# EAGLE schematic design (EAGLE 7.7.0), part 1 of 2

## Sheet 1 of 24
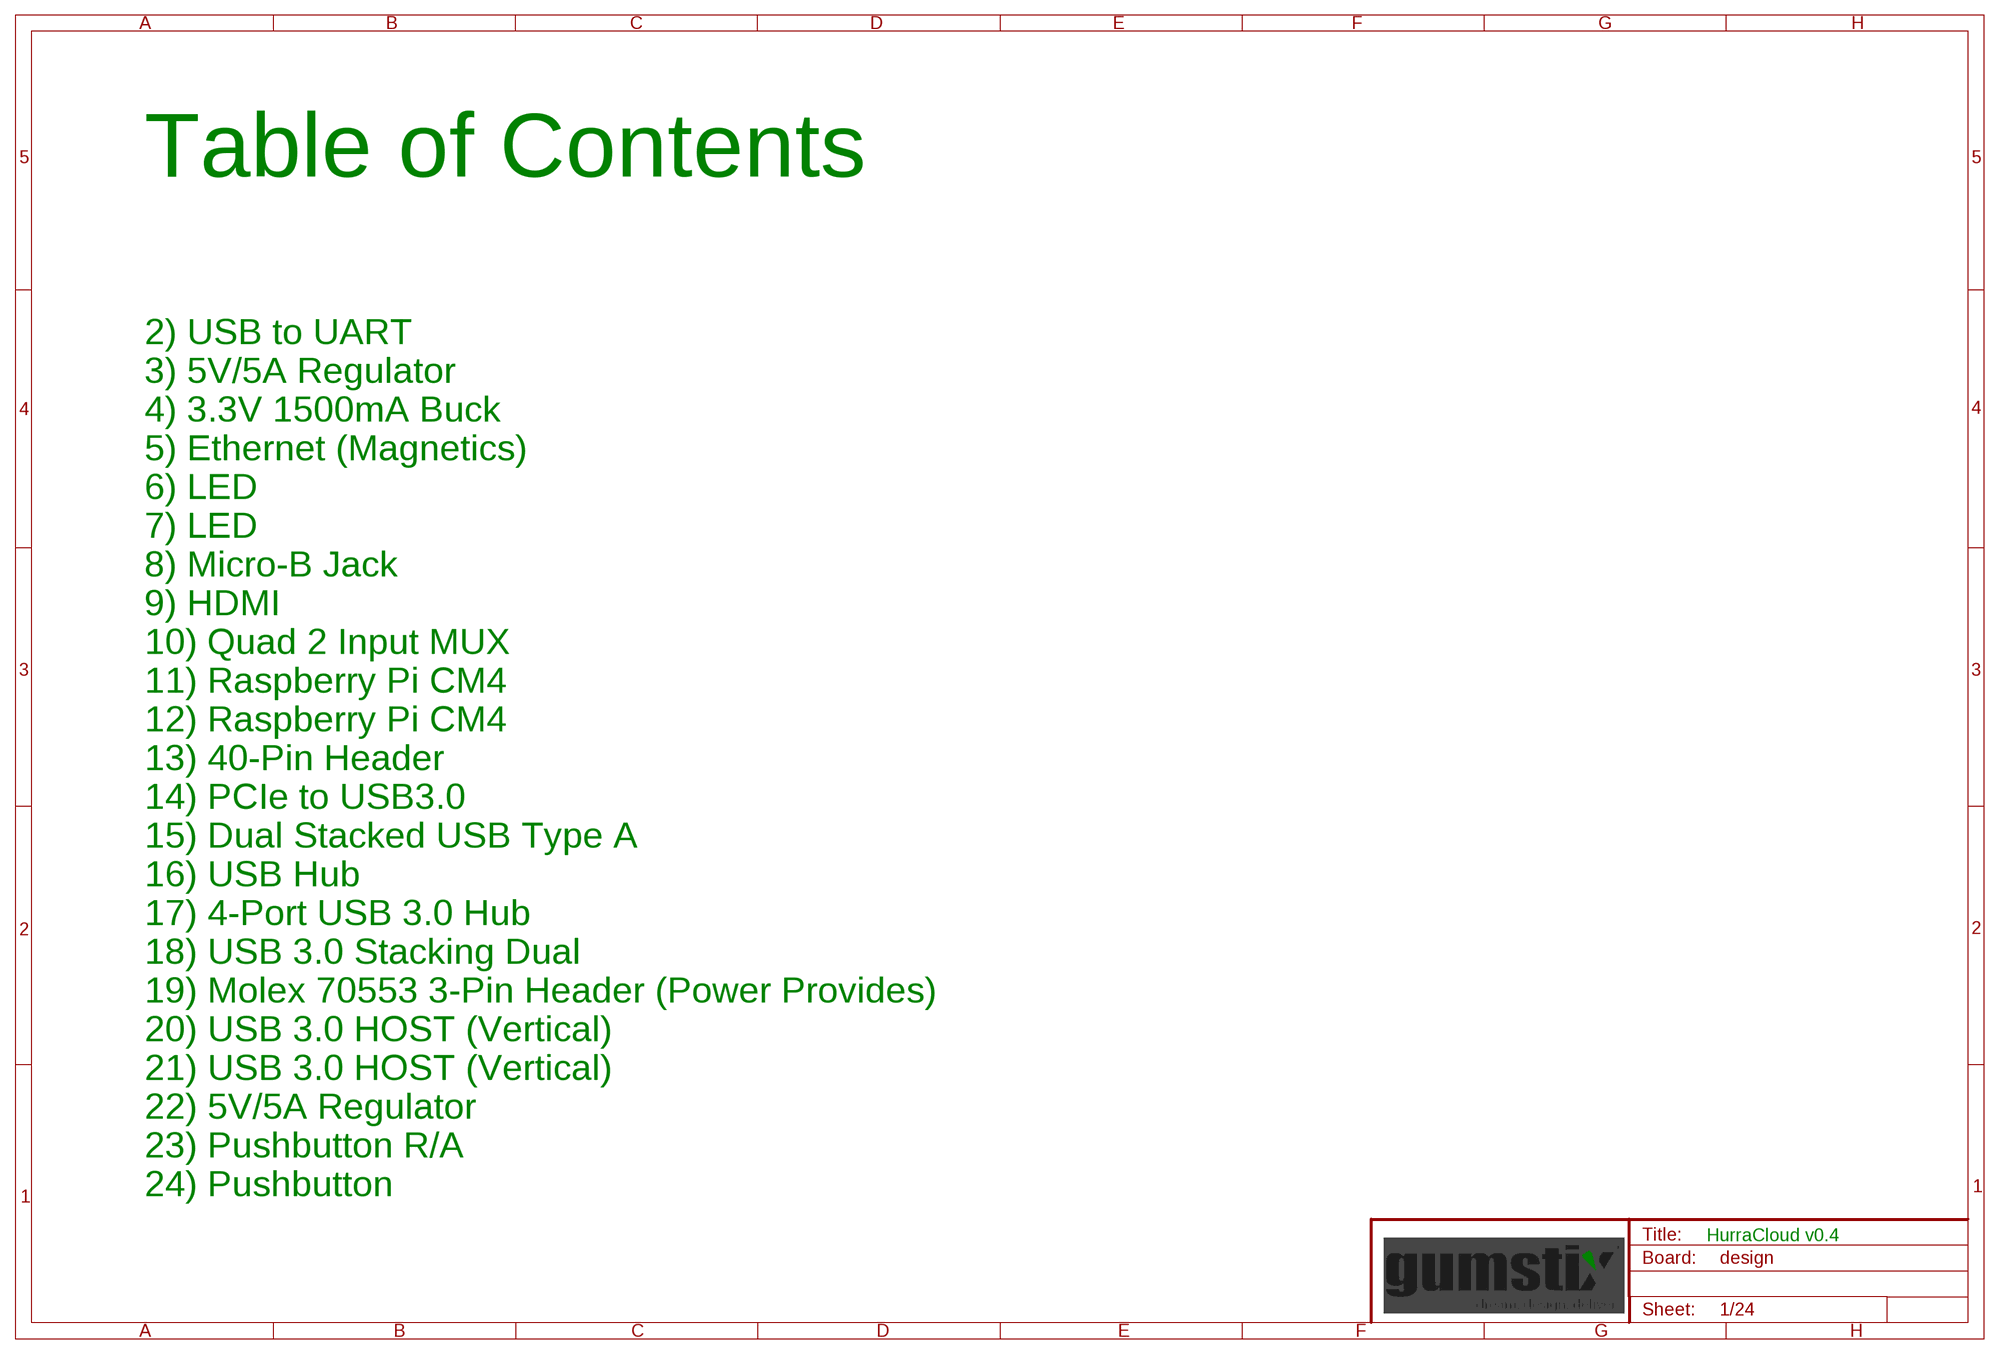
[diagram p0: schematic, sheet 1]

### Notes on the sheet
- Table of Contents
- 2) USB to UART
- 3) 5V/5A Regulator
- 4) 3.3V 1500mA Buck
- 5) Ethernet (Magnetics)
- 6) LED
- 7) LED
- 8) Micro-B Jack
- 9) HDMI
- 10) Quad 2 Input MUX
- 11) Raspberry Pi CM4
- 12) Raspberry Pi CM4
- 13) 40-Pin Header
- 14) PCIe to USB3.0
- 15) Dual Stacked USB Type A
- 16) USB Hub
- 17) 4-Port USB 3.0 Hub
- 18) USB 3.0 Stacking Dual
- 19) Molex 70553 3-Pin Header (Power Provides)
- 20) USB 3.0 HOST (Vertical)
- 21) USB 3.0 HOST (Vertical)
- 22) 5V/5A Regulator
- 23) Pushbutton R/A
- 24) Pushbutton
- HurraCloud v0.4

## Sheet 2 of 24
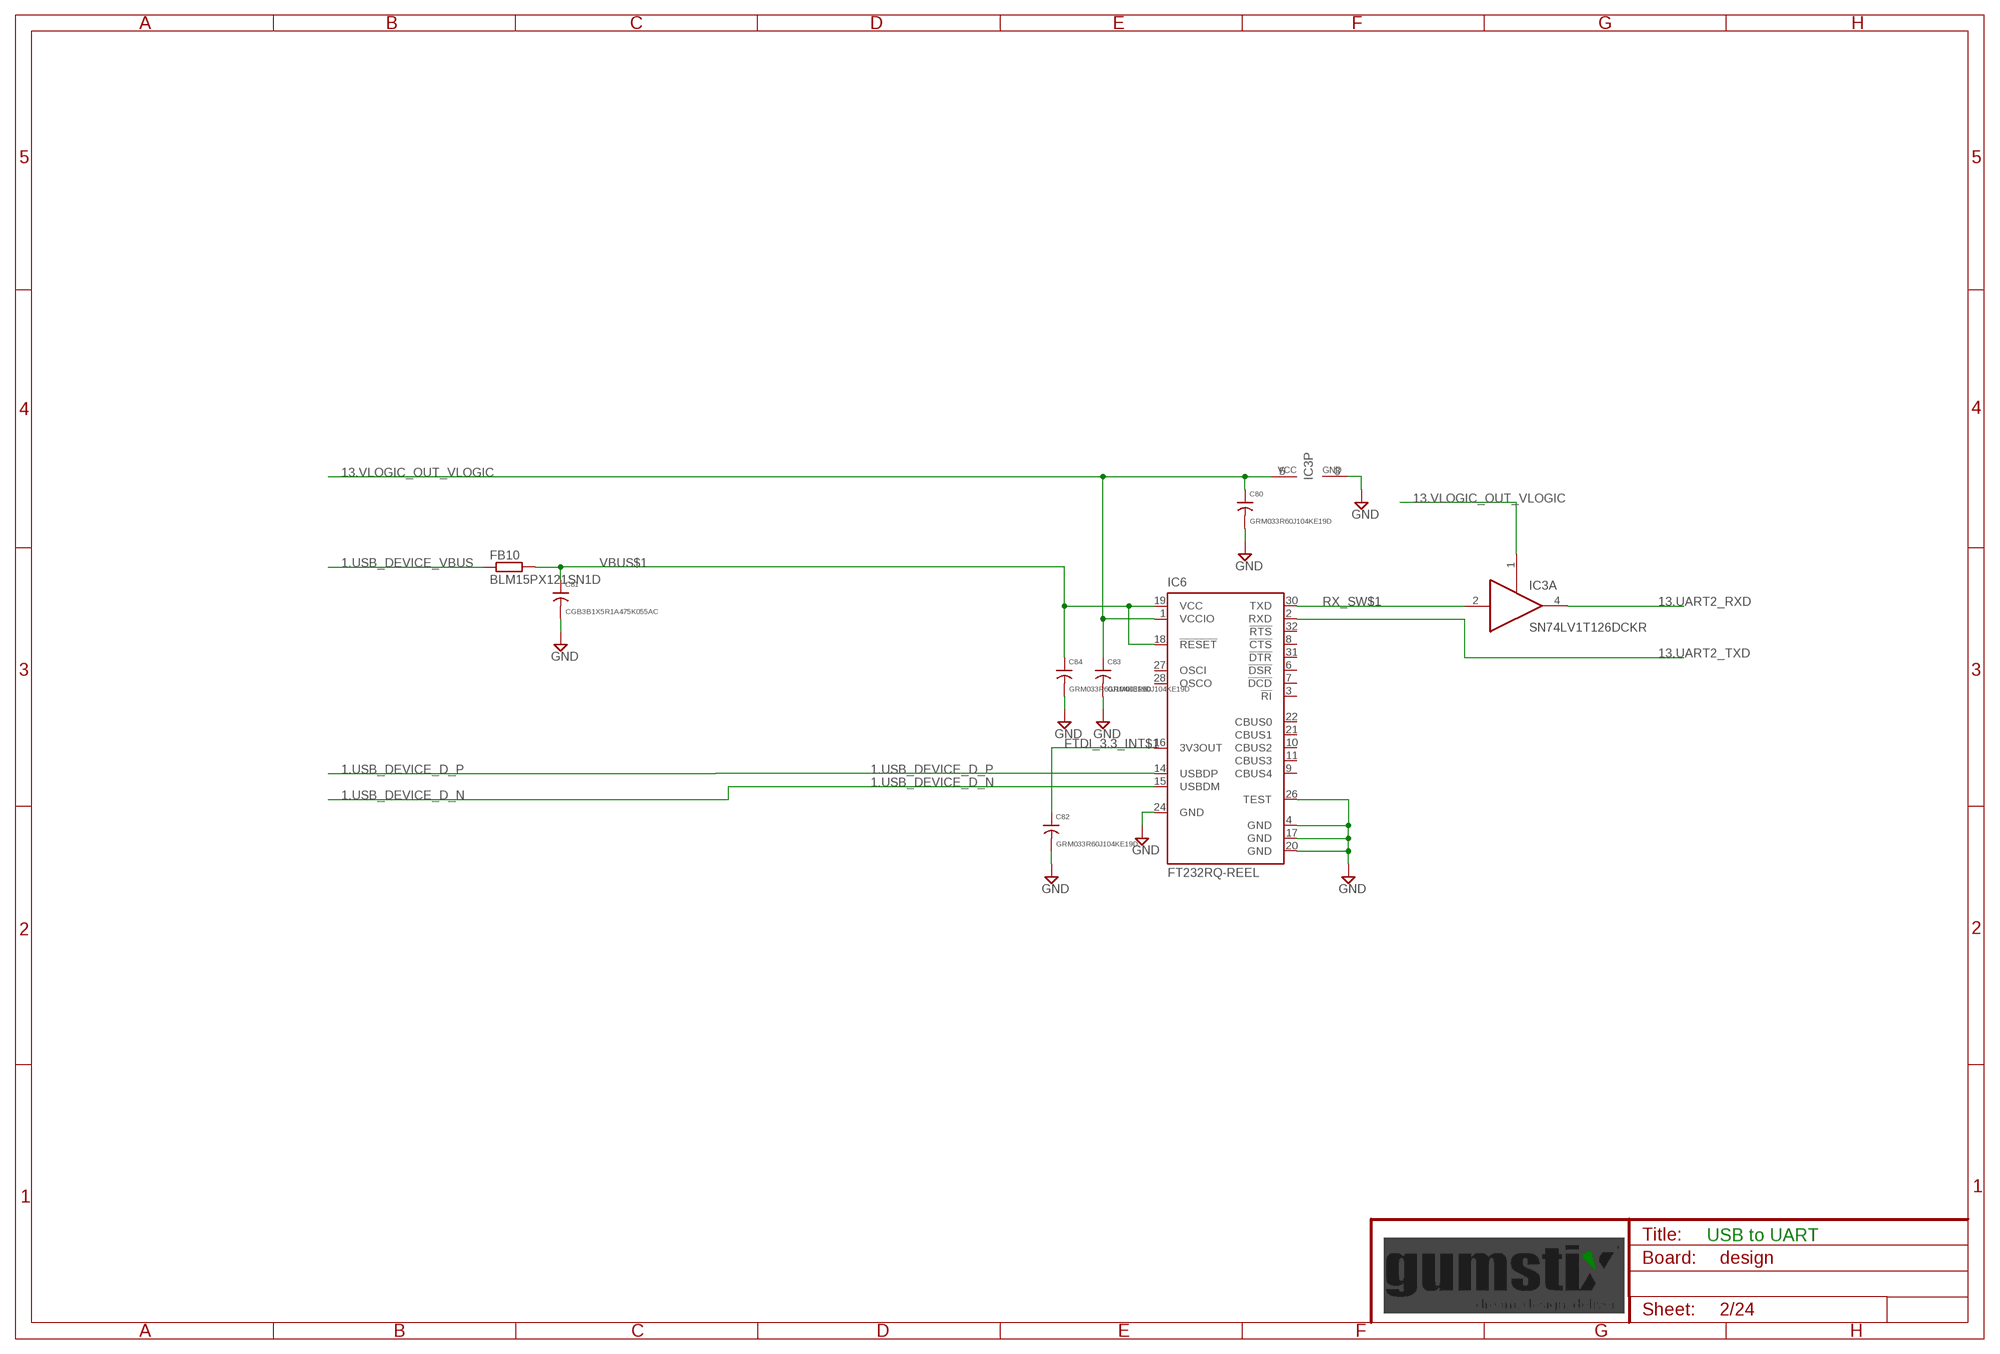
[diagram p1: schematic, sheet 2]

### Parts
C80  GRM033R60J104KE19D  [0201]
C81  CGB3B1X5R1A475K055AC  [0603]
C82  GRM033R60J104KE19D  [0201]
C83  GRM033R60J104KE19D  [0201]
C84  GRM033R60J104KE19D  [0201]
FB10  BLM15PX121SN1D  [0402]
IC3  SN74LV1T126DCKR  [SC70-5]
IC6  FT232RQ-REEL  [QFN32]

### Nets
1.USB_DEVICE_D_N [USB]: IC6.15(USBDM) ; also sheet 8
1.USB_DEVICE_D_P [USB]: IC6.14(USBDP) ; also sheet 8
1.USB_DEVICE_VBUS [supply]: FB10.1 ; also sheet 8
13.UART2_RXD: IC3.4(A:O) ; also sheet 10
13.UART2_TXD: IC6.2(RXD) ; also sheet 10
13.VLOGIC_OUT_VLOGIC [supply]: C80.1 C83.1 IC3.1(A:OE) IC3.5(P:VCC) IC6.1(VCCIO) ; also sheet 10
FTDI_3.3_INT$1 [supply]: C82.1 IC6.16(3V3OUT)
GND [supply]: C80.2 C81.2 C82.2 C83.2 C84.2 IC3.3(P:GND) IC6.4(GND) IC6.17(GND) IC6.20(GND) IC6.24(GND) IC6.26(TEST) ; also sheet 3,4,5,6,7,8,9,10,11,12,13,14,15,16,17,18,19,20,21,22,23,24
RX_SW$1: IC3.2(A:I) IC6.30(TXD)
VBUS$1 [supply]: C81.1 C84.1 FB10.2 IC6.18(!RESET) IC6.19(VCC)
Unconnected: IC6.3(!RI) IC6.6(!DSR) IC6.7(!DCD) IC6.8(!CTS) IC6.9(CBUS4) IC6.10(CBUS2) IC6.11(CBUS3) IC6.21(CBUS1) IC6.22(CBUS0) IC6.27(OSCI) IC6.28(OSCO) IC6.31(!DTR) IC6.32(!RTS)

### Notes on the sheet
- USB to UART

## Sheet 3 of 24
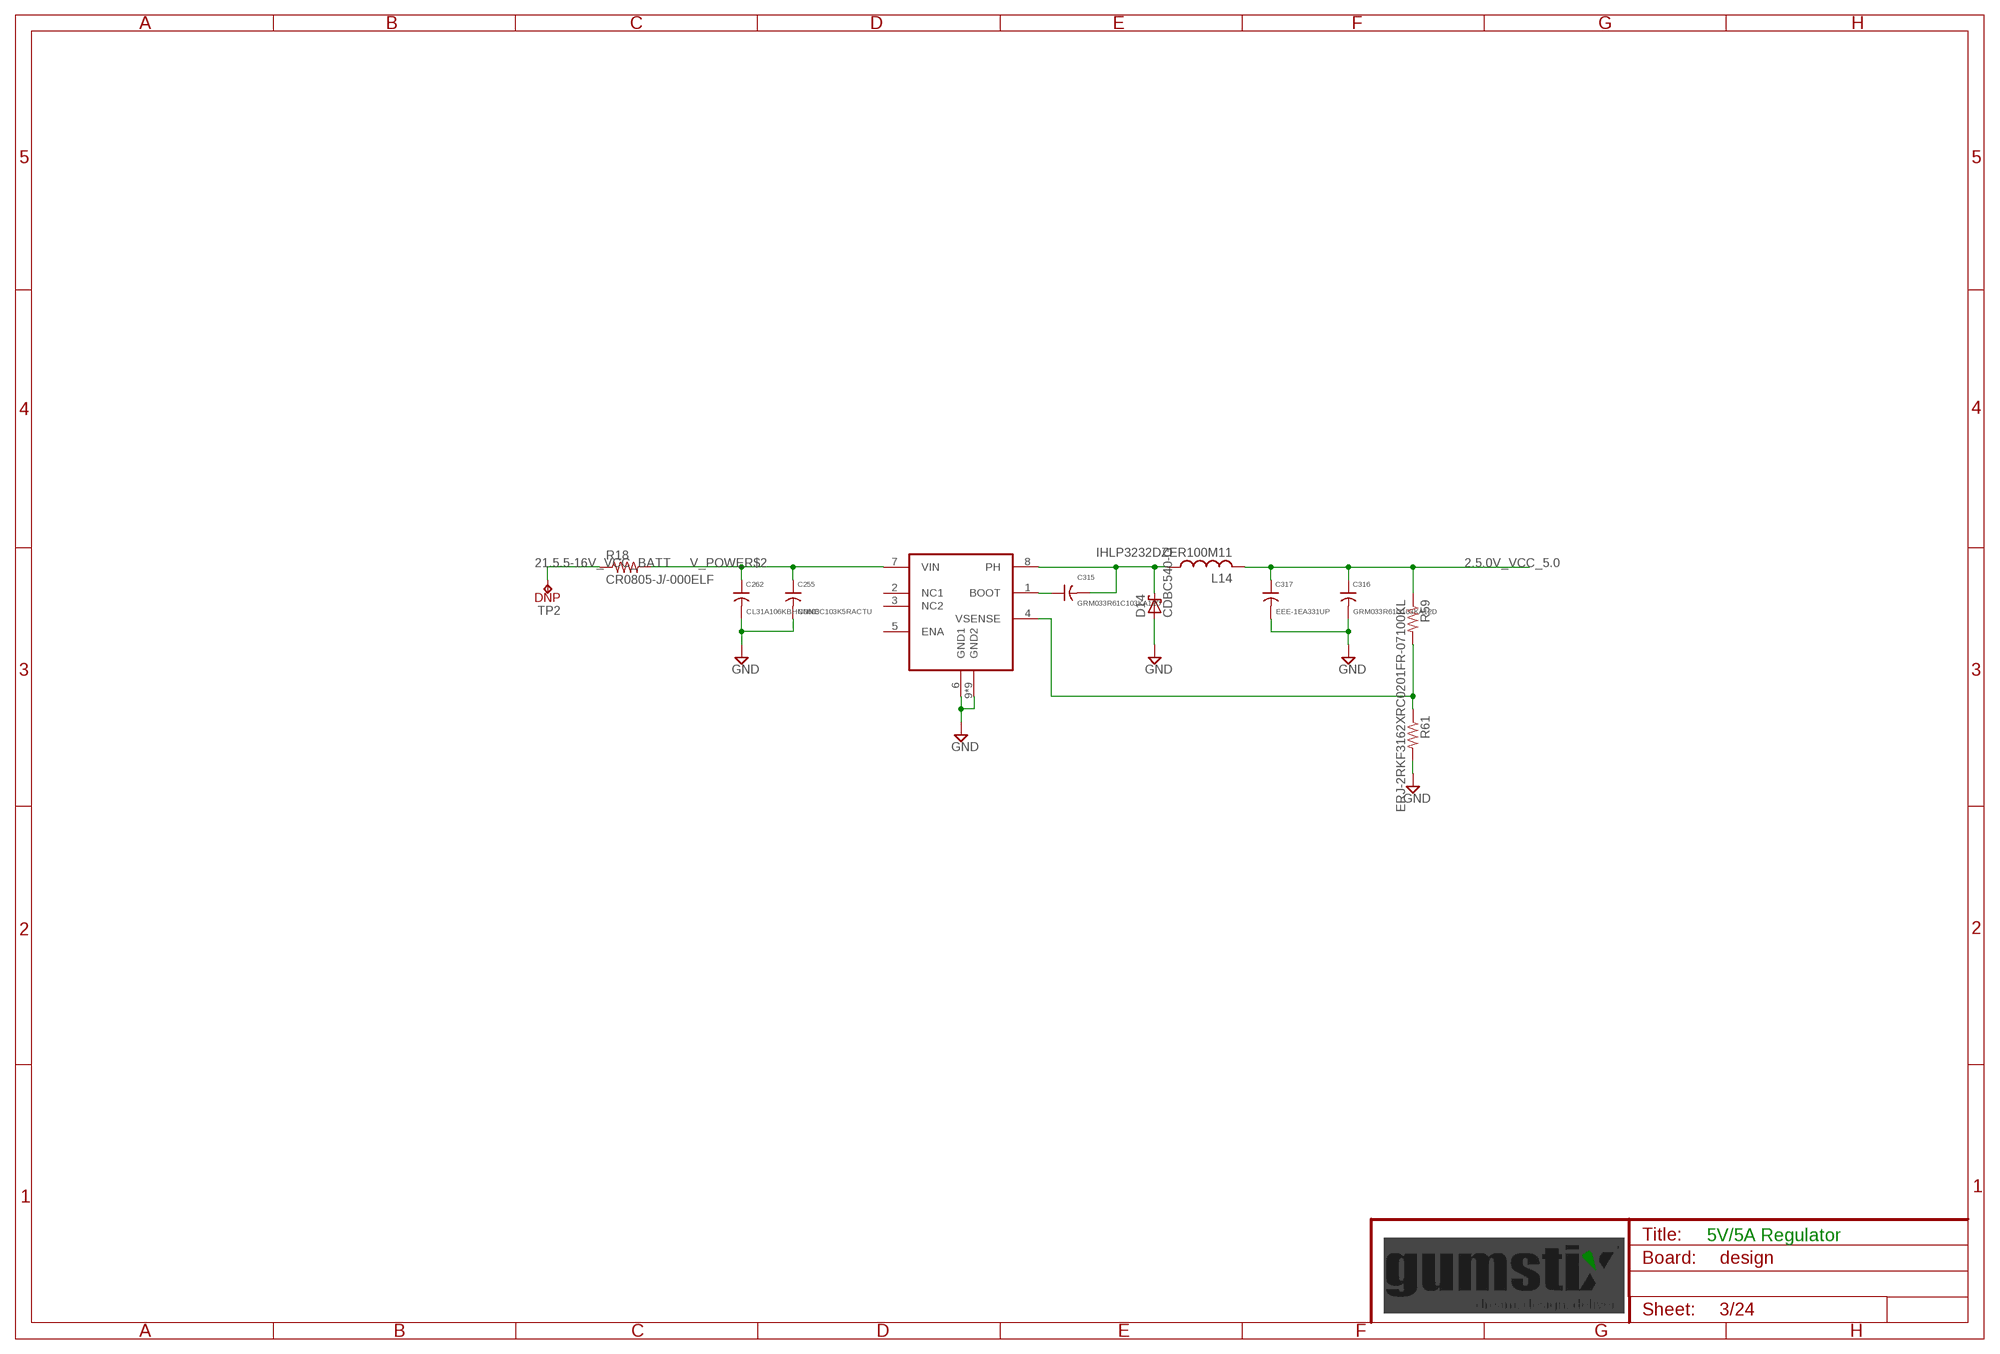
[diagram p2: schematic, sheet 3]

### Parts
C255  C0603C103K5RACTU  [0603]
C262  CL31A106KBHNNNE  [1206]
C315  GRM033R61C103KA12D  [0201]
C316  GRM033R61C103KA12D  [0201]
C317  EEE-1EA331UP  [PANASONIC_F]
D14  CDBC540-G  [DO-214AB]
L14  IHLP3232DZER100M11  [3232DZ]
R18  CR0805-J/-000ELF  [0805]
R59  RC0201FR-07100KL  [0201]
R61  ERJ-2RKF3162X  [0402]
TP2  DNP  TP05  [TP0500]
U17  TPS5450QDDARQ1  [8SO_POWERPAD]

### Nets
2.5.0V_VCC_5.0 [supply]: C316.1 C317.+ L14.2 R59.1 ; also sheet 4,9,11,13,15,16
21.5.5-16V_VCC_BATT [supply]: R18.1 TP2.1(TP) ; also sheet 19,22
BOOT$2 [supply]: C315.1 U17.1(BOOT)
GND [supply]: C255.2 C262.2 C316.2 C317.- D14.A R61.2 U17.6(GND1) U17.9(GND2) U17.PWRPAD1(GND2) U17.PWRPAD2(GND2) U17.PWRPAD3(GND2) U17.PWRPAD4(GND2) U17.PWRPAD5(GND2) U17.PWRPAD6(GND2) U17.PWRPAD7(GND2) U17.PWRPAD8(GND2) ; also sheet 2,4,5,6,7,8,9,10,11,12,13,14,15,16,17,18,19,20,21,22,23,24
PH$2 [supply]: C315.2 D14.C L14.1 U17.8(PH)
V_POWER$2 [supply]: C255.1 C262.1 R18.2 U17.7(VIN)
VSENSE$2 [supply]: R59.2 R61.1 U17.4(VSENSE)
Unconnected: U17.2(NC1) U17.3(NC2) U17.5(ENA)

### Notes on the sheet
- 5V/5A Regulator

## Sheet 4 of 24
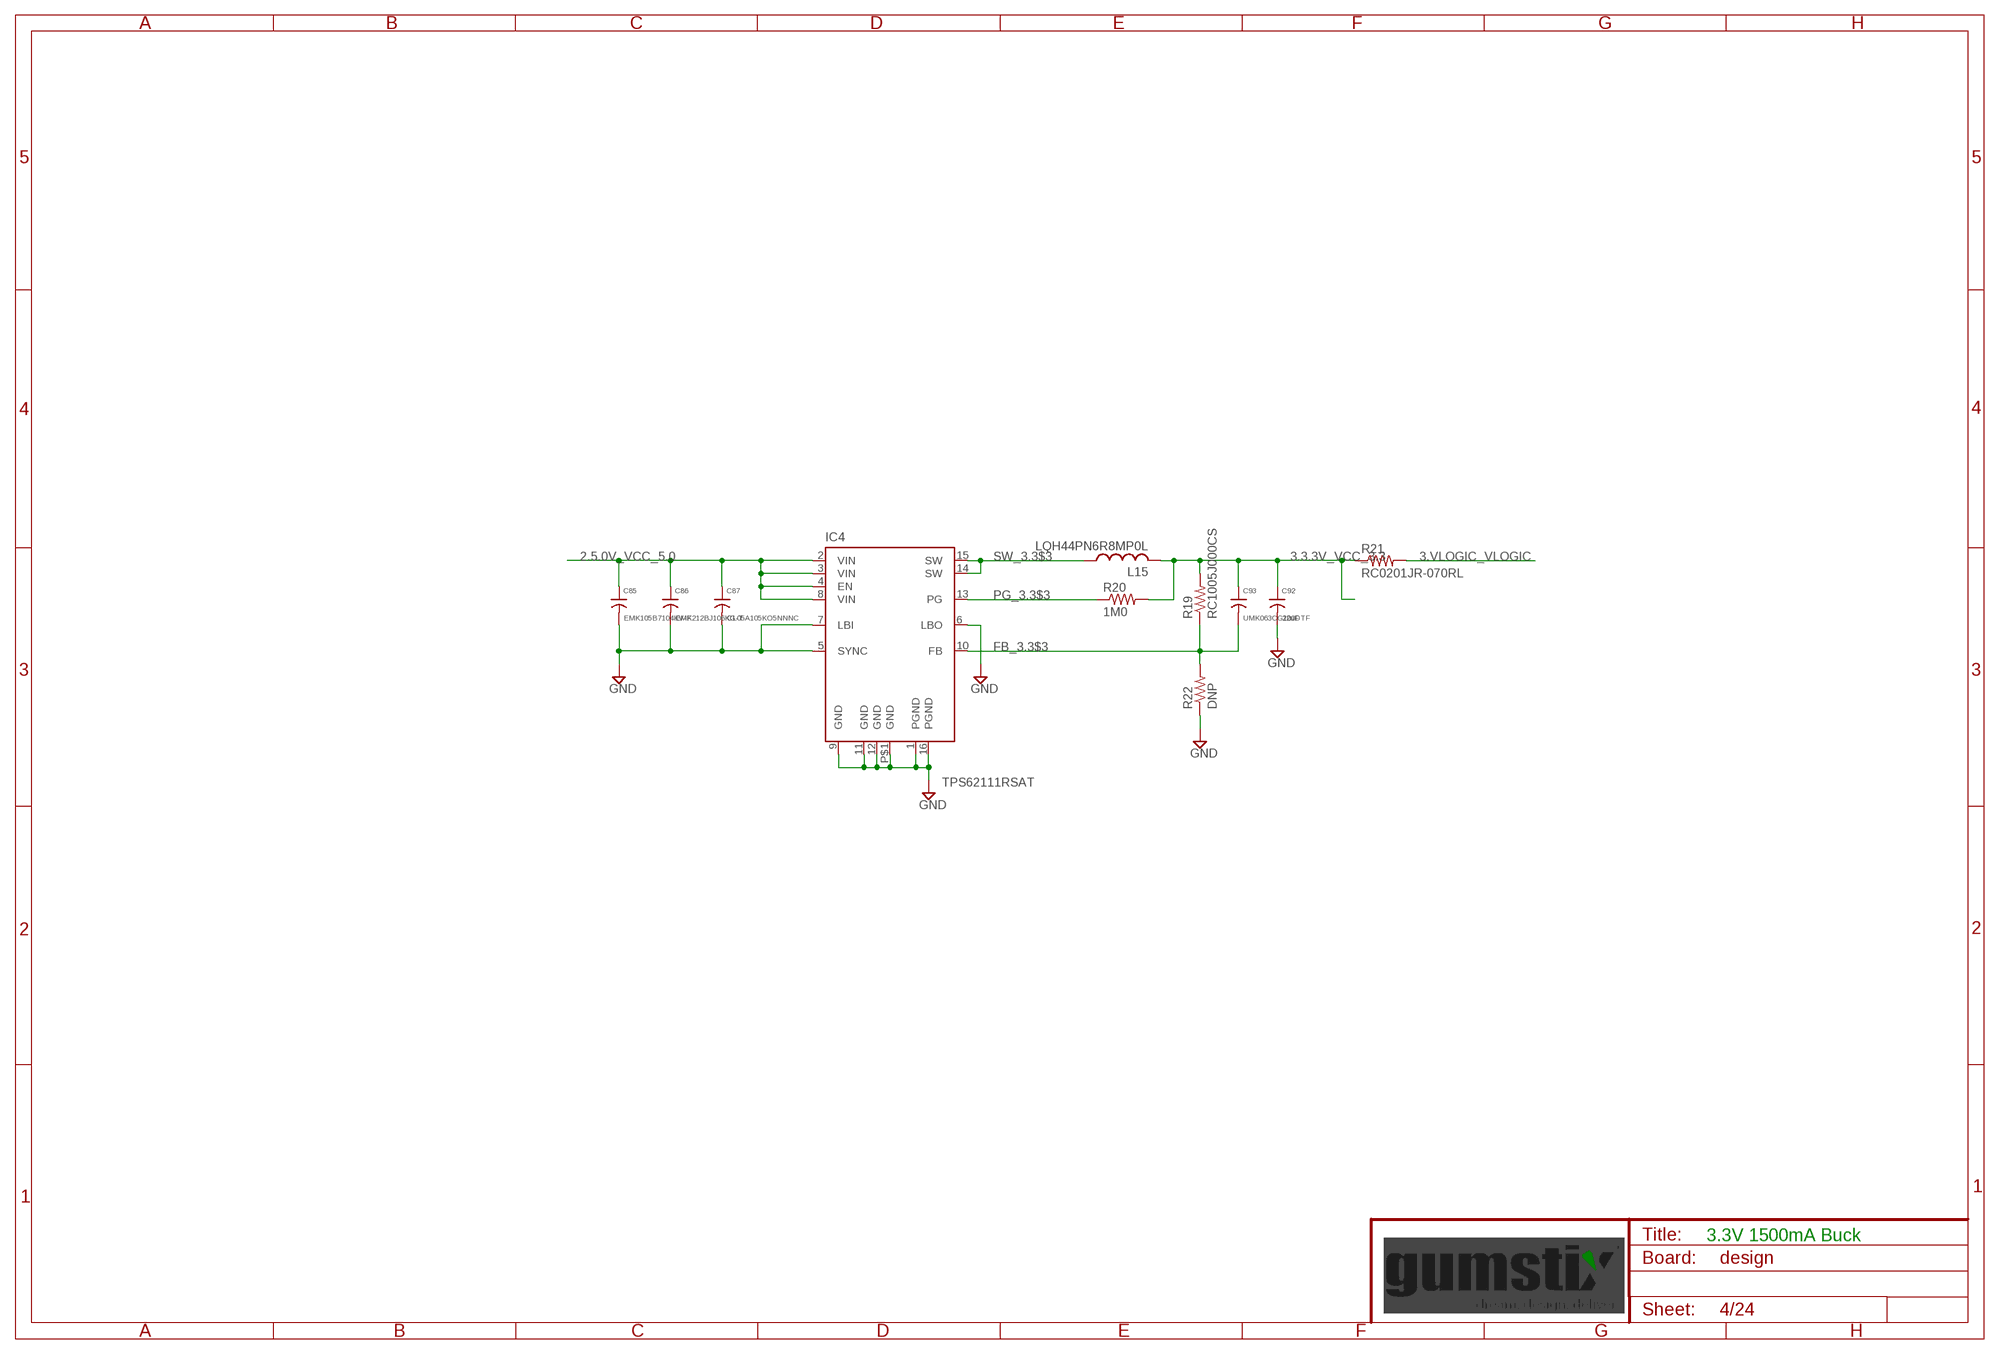
[diagram p3: schematic, sheet 4]

### Parts
C85  EMK105B7104KV-F  [0402]
C86  EMK212BJ106KG-T  [0805]
C87  CL05A105KO5NNNC  [0402]
C92  22uF  C0805  [0805]
C93  UMK063CG100DTF  [0201]
IC4  TPS62111RSAT  [PQFP16]
L15  LQH44PN6R8MP0L  [1515]
R19  RC1005J000CS  [0402]
R20  1M0  R0201  [0201]
R21  RC0201JR-070RL  [0201]
R22  DNP  R0402  [0402]

### Nets
2.5.0V_VCC_5.0 [supply]: C85.1 C86.1 C87.1 IC4.2(VIN) IC4.3(VIN) IC4.4(EN) IC4.8(VIN) ; also sheet 3,9,11,13,15,16
3.3.3V_VCC_3.3 [supply]: C92.1 C93.1 L15.2 R19.2 R20.2 R21.1 ; also sheet 5,6,7,13,14
3.VLOGIC_VLOGIC [supply]: R21.2 ; also sheet 13
FB_3.3$3 [supply]: C93.2 IC4.10(FB) R19.1 R22.2
GND [supply]: C85.2 C86.2 C87.2 C92.2 IC4.1(PGND) IC4.5(SYNC) IC4.6(LBO) IC4.7(LBI) IC4.9(GND) IC4.11(GND) IC4.12(GND) IC4.16(PGND) IC4.P$1(GND) R22.1 ; also sheet 2,3,5,6,7,8,9,10,11,12,13,14,15,16,17,18,19,20,21,22,23,24
PG_3.3$3: IC4.13(PG) R20.1
SW_3.3$3 [supply]: IC4.14(SW) IC4.15(SW) L15.1

### Notes on the sheet
- 3.3V 1500mA Buck

## Sheet 5 of 24
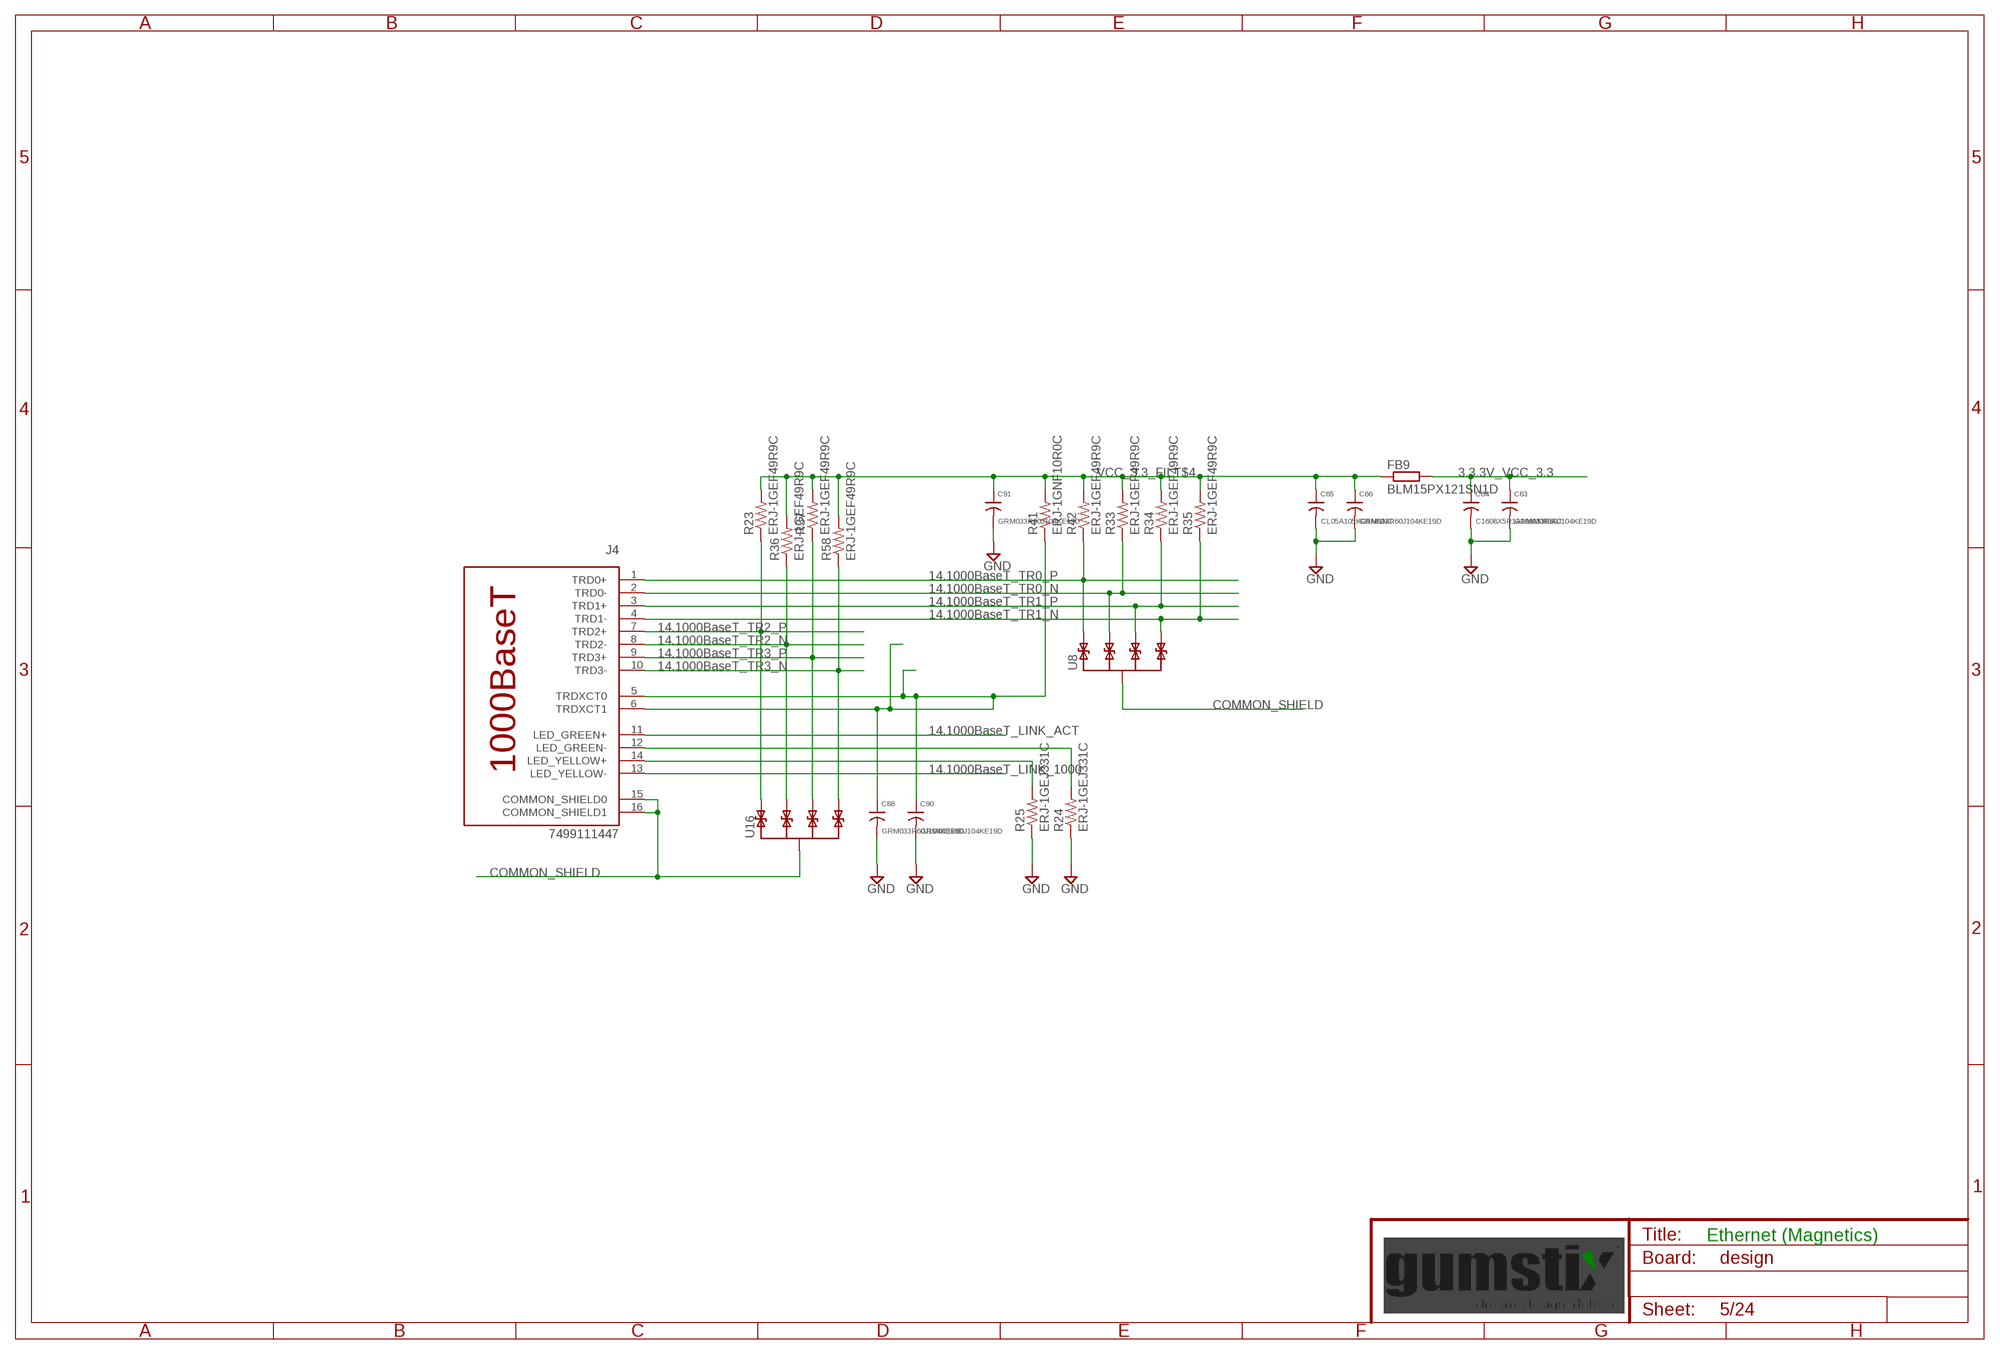
[diagram p4: schematic, sheet 5]

### Parts
C63  GRM033R60J104KE19D  [0201]
C64  C1608X5R1A106M080AC  [0603]
C65  CL05A105KO5NNNC  [0402]
C66  GRM033R60J104KE19D  [0201]
C88  GRM033R60J104KE19D  [0201]
C90  GRM033R60J104KE19D  [0201]
C91  GRM033R60J104KE19D  [0201]
FB9  BLM15PX121SN1D  [0402]
J4  7499111447  [7499111447]
R23  ERJ-1GEF49R9C  [0201]
R24  ERJ-1GEJ331C  [0201]
R25  ERJ-1GEJ331C  [0201]
R33  ERJ-1GEF49R9C  [0201]
R34  ERJ-1GEF49R9C  [0201]
R35  ERJ-1GEF49R9C  [0201]
R36  ERJ-1GEF49R9C  [0201]
R37  ERJ-1GEF49R9C  [0201]
R41  ERJ-1GNF10R0C  [0201]
R42  ERJ-1GEF49R9C  [0201]
R58  ERJ-1GEF49R9C  [0201]
U8  TPD4E02B04DQAR  [UFDFN-10]
U16  TPD4E02B04DQAR  [UFDFN-10]

### Nets
3.3.3V_VCC_3.3 [supply]: C63.1 C64.1 FB9.2 ; also sheet 4,6,7,13,14
14.1000BaseT_LINK_1000: J4.13(LED_YELLOW-) ; also sheet 11
14.1000BaseT_LINK_ACT: J4.11(LED_GREEN+) ; also sheet 11
14.1000BaseT_TR0_N [HDMI]: J4.2(TRD0-) R33.1 U8.2 U8.9(P2) ; also sheet 11
14.1000BaseT_TR0_P [HDMI]: J4.1(TRD0+) R42.1 U8.1 U8.10(P1) ; also sheet 11
14.1000BaseT_TR1_N [HDMI]: J4.4(TRD1-) R35.1 U8.5(P4) U8.6(P4) ; also sheet 11
14.1000BaseT_TR1_P [HDMI]: J4.3(TRD1+) R34.1 U8.4(P3) U8.7(P3) ; also sheet 11
14.1000BaseT_TR2_N [HDMI]: J4.8(TRD2-) R36.1 U16.2 U16.9(P2) ; also sheet 11
14.1000BaseT_TR2_P [HDMI]: J4.7(TRD2+) R23.1 U16.1 U16.10(P1) ; also sheet 11
14.1000BaseT_TR3_N [HDMI]: J4.10(TRD3-) R58.1 U16.5(P4) U16.6(P4) ; also sheet 11
14.1000BaseT_TR3_P [HDMI]: J4.9(TRD3+) R37.1 U16.4(P3) U16.7(P3) ; also sheet 11
COMMON_SHIELD [supply]: J4.15(COMMON_SHIELD0) J4.16(COMMON_SHIELD1) U8.3(SHIELD) U8.8(SHIELD) U16.3(SHIELD) U16.8(SHIELD) ; also sheet 8,9,15,18,20,21
CT0$4 [supply]: C88.1 C90.1 J4.5(TRDXCT0) J4.6(TRDXCT1) R41.1
GND [supply]: C63.2 C64.2 C65.2 C66.2 C88.2 C90.2 C91.2 R24.1 R25.1 ; also sheet 2,3,4,6,7,8,9,10,11,12,13,14,15,16,17,18,19,20,21,22,23,24
LED_GREEN_N$4: J4.12(LED_GREEN-) R24.2
LED_YELLOW_P$4: J4.14(LED_YELLOW+) R25.2
VCC_3.3_FILT$4 [supply]: C65.1 C66.1 C91.1 FB9.1 R23.2 R33.2 R34.2 R35.2 R36.2 R37.2 R41.2 R42.2 R58.2

### Notes on the sheet
- Ethernet (Magnetics)

## Sheet 6 of 24
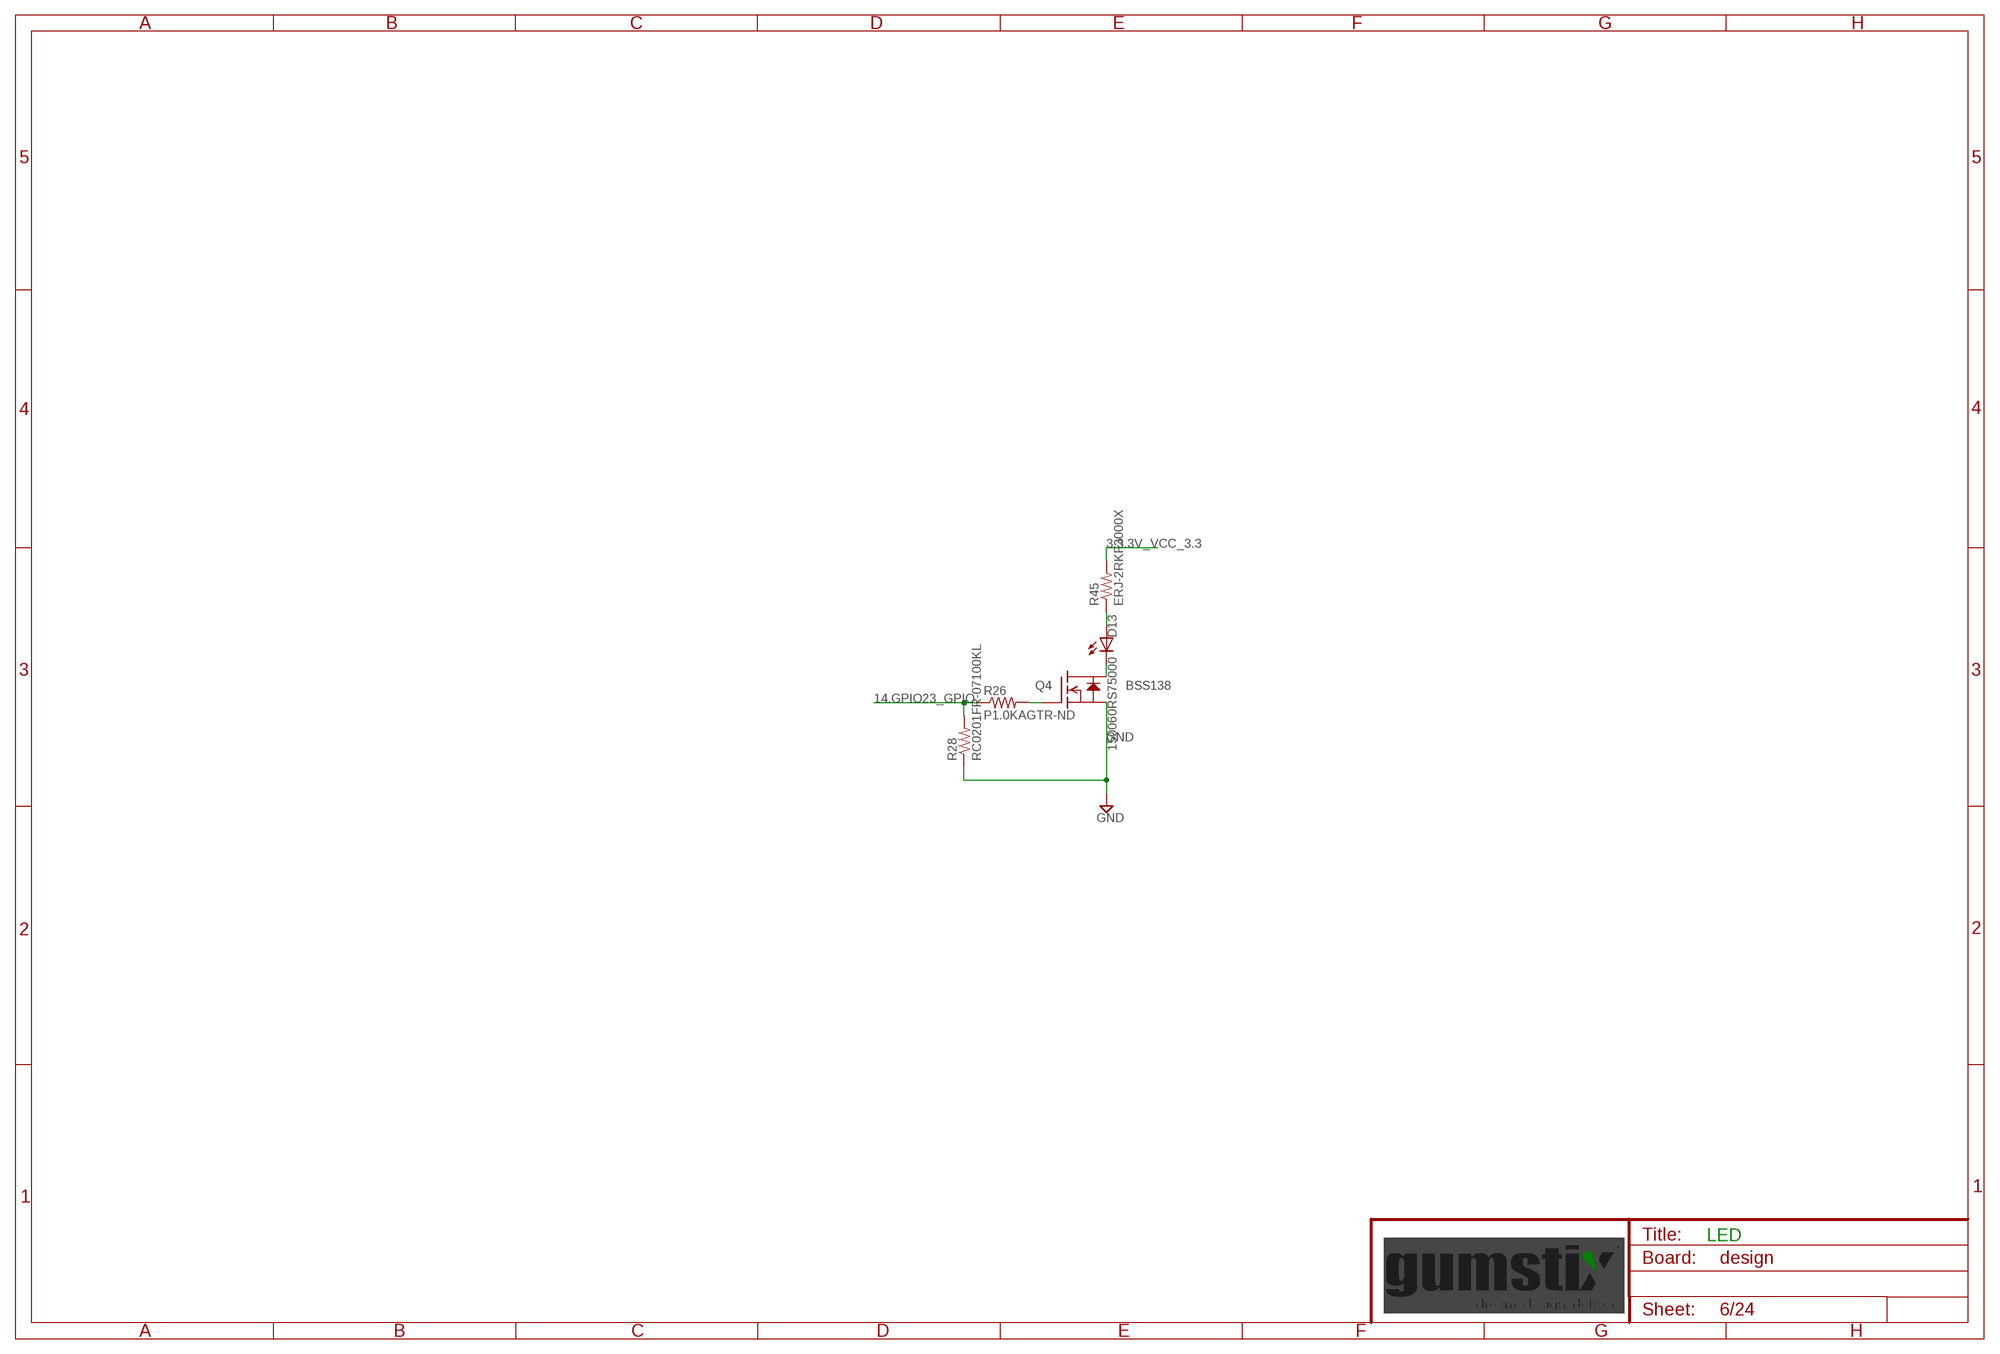
[diagram p5: schematic, sheet 6]

### Parts
D13  150060RS75000  [D0603]
Q4  BSS138  [SOT23]
R26  P1.0KAGTR-ND  [0201]
R28  RC0201FR-07100KL  [0201]
R45  ERJ-2RKF3000X  [0402]

### Nets
3.3.3V_VCC_3.3 [supply]: R45.2 ; also sheet 4,5,7,13,14
14.GPIO23_GPIO: R26.1 R28.2 ; also sheet 11,13
ANODE$9: D13.A R45.1
GATE$9: Q4.1(G) R26.2
GND [supply]: Q4.2(S) R28.1 ; also sheet 2,3,4,5,7,8,9,10,11,12,13,14,15,16,17,18,19,20,21,22,23,24
LED-$9: D13.C Q4.3(D)

### Notes on the sheet
- LED

## Sheet 7 of 24
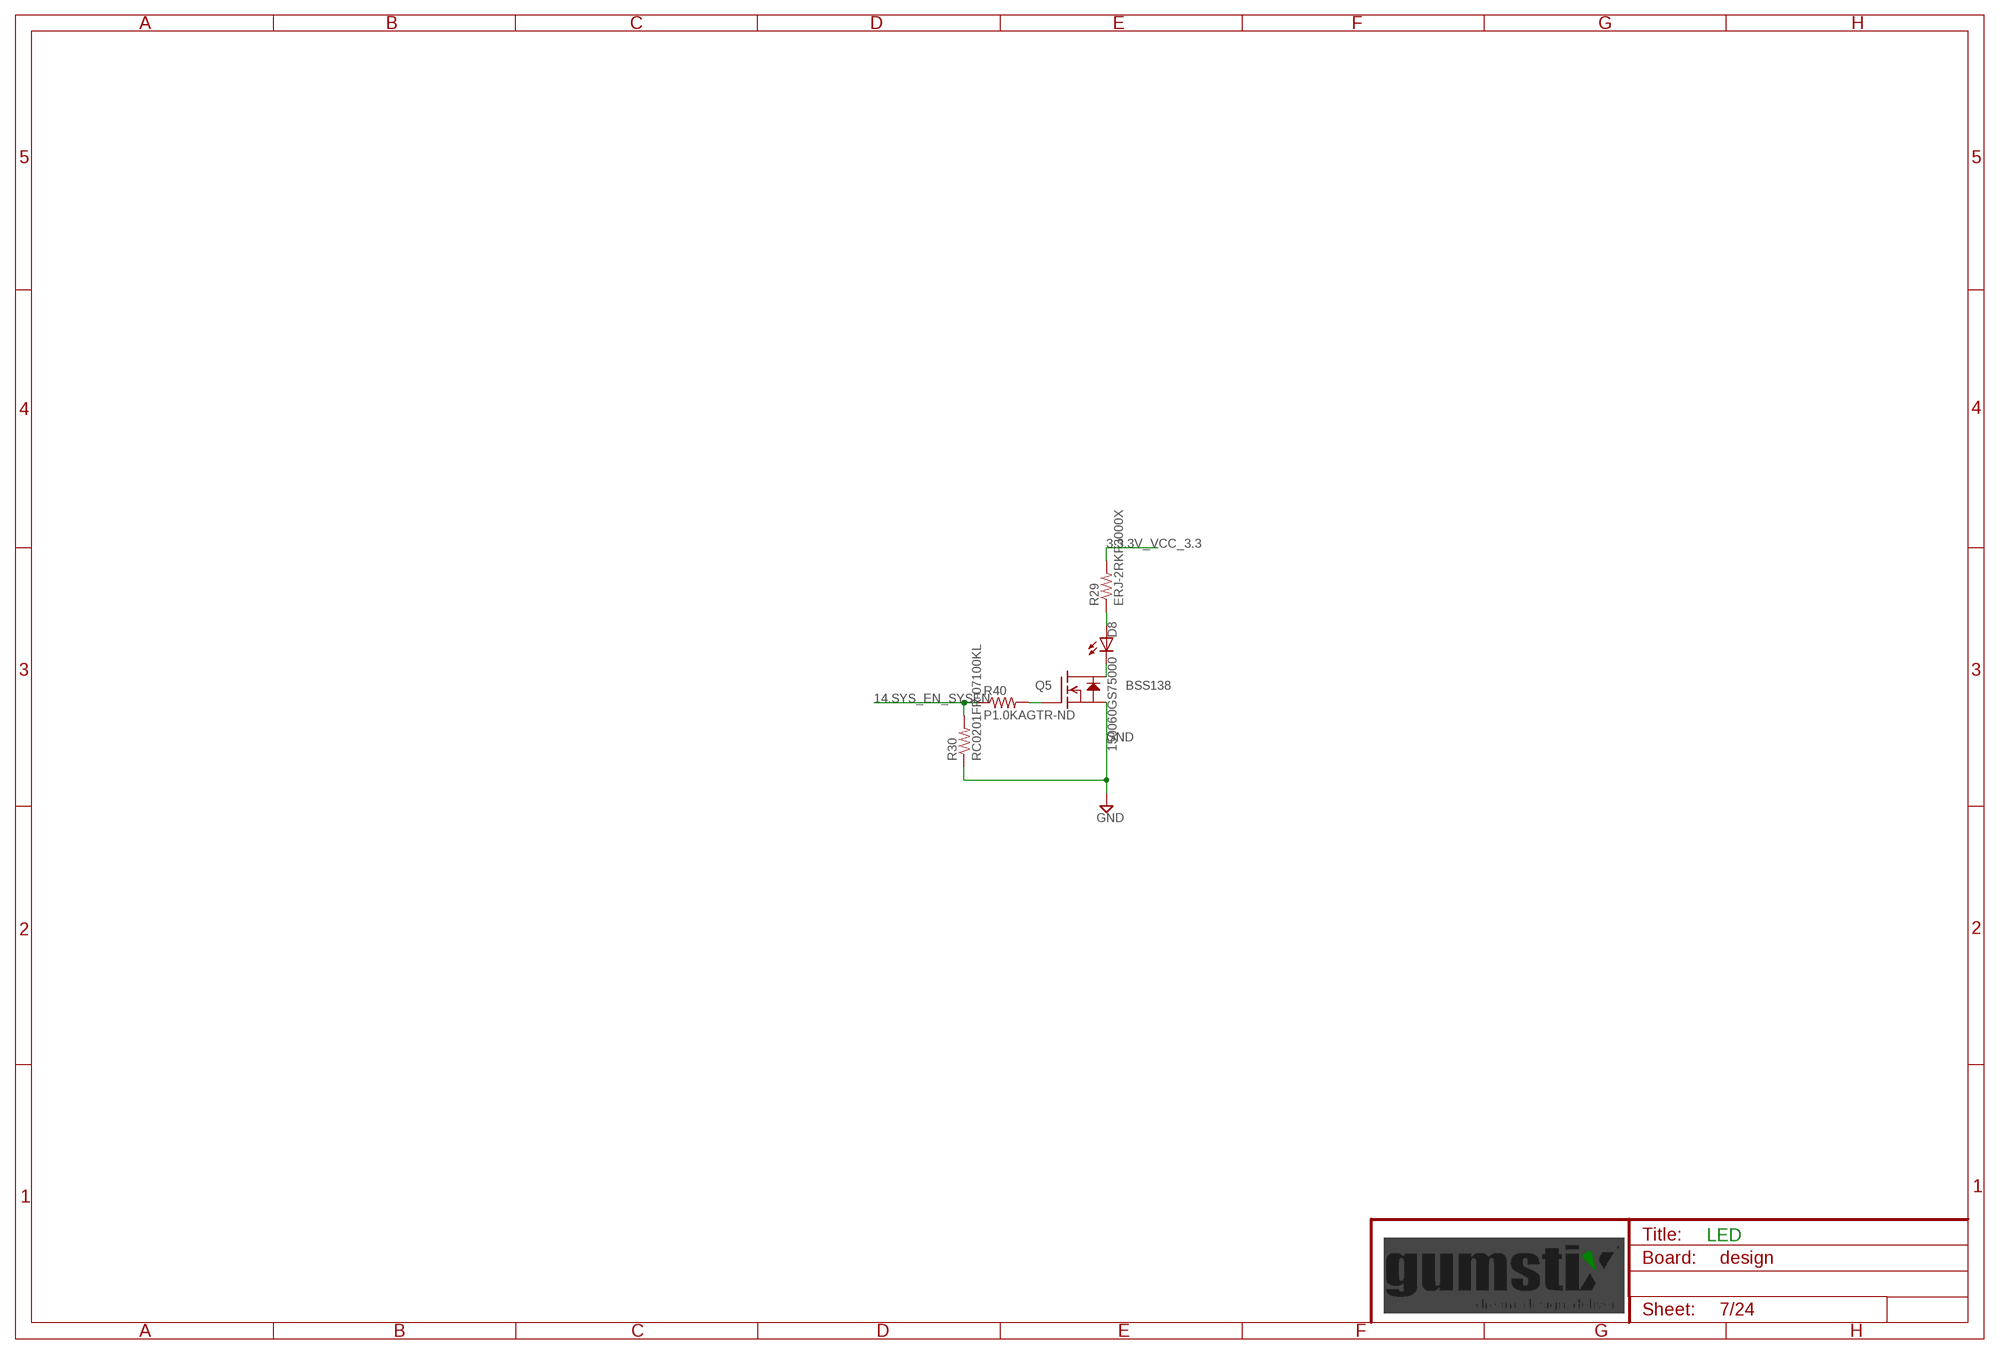
[diagram p6: schematic, sheet 7]

### Parts
D8  150060GS75000  [D0603]
Q5  BSS138  [SOT23]
R29  ERJ-2RKF3000X  [0402]
R30  RC0201FR-07100KL  [0201]
R40  P1.0KAGTR-ND  [0201]

### Nets
3.3.3V_VCC_3.3 [supply]: R29.2 ; also sheet 4,5,6,13,14
14.SYS_EN_SYSEN: R30.2 R40.1 ; also sheet 11
ANODE$10: D8.A R29.1
GATE$10: Q5.1(G) R40.2
GND [supply]: Q5.2(S) R30.1 ; also sheet 2,3,4,5,6,8,9,10,11,12,13,14,15,16,17,18,19,20,21,22,23,24
LED-$10: D8.C Q5.3(D)

### Notes on the sheet
- LED

## Sheet 8 of 24
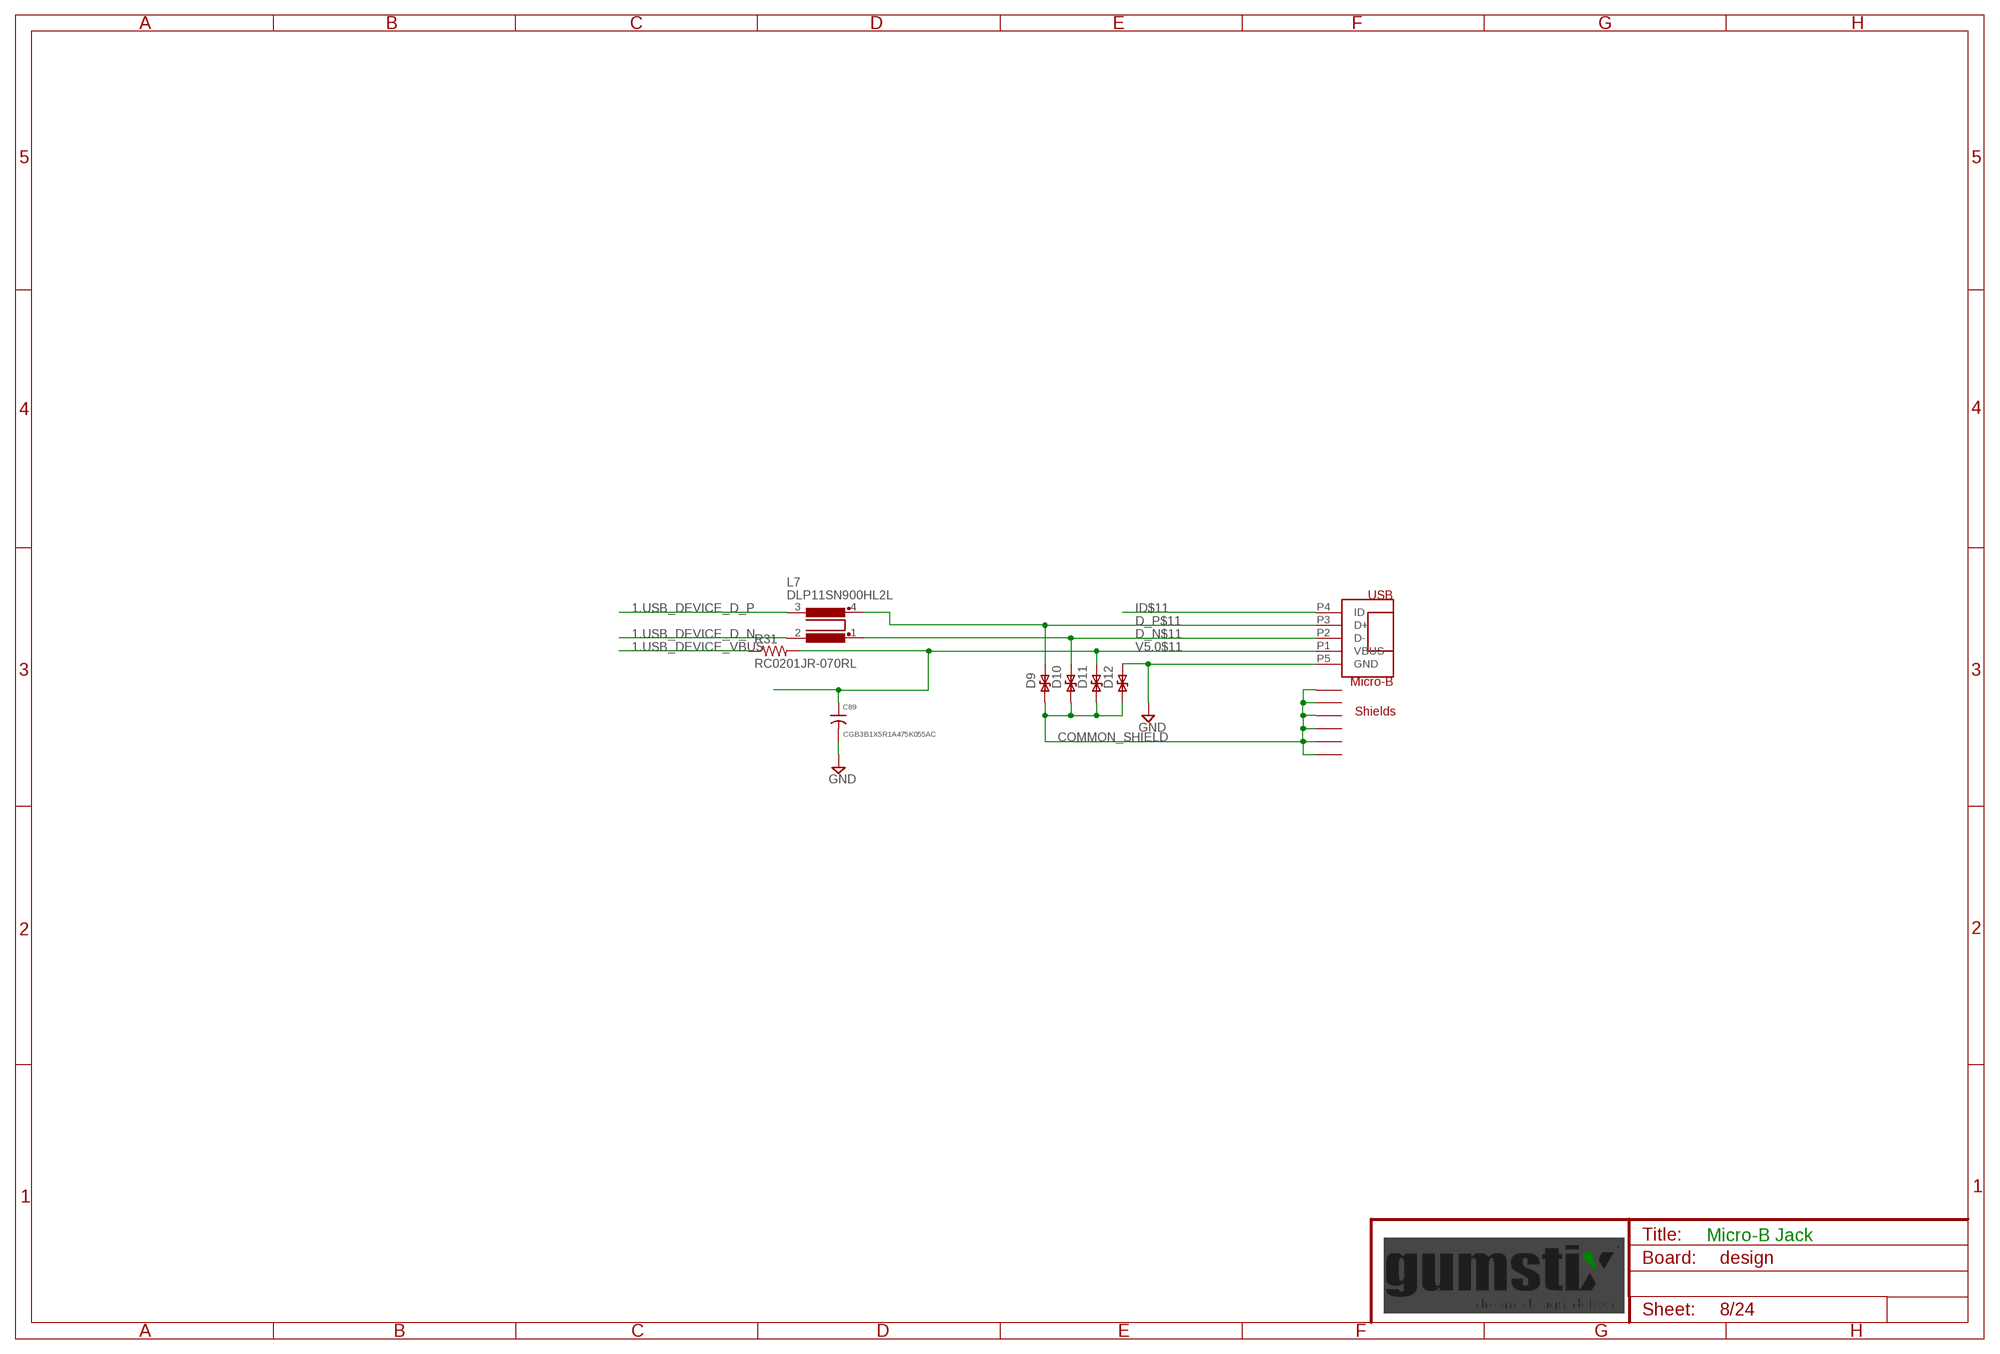
[diagram p7: schematic, sheet 8]

### Parts
C89  CGB3B1X5R1A475K055AC  [0603]
D9  PS04LTVA1  [D0402]
D10  PS04LTVA1  [D0402]
D11  B72590D0050A060  [D0402]
D12  B72590D0050A060  [D0402]
J3  10118192-0001LF  [USB_MICRO_B]
L7  DLP11SN900HL2L  [0504-DLP11S]
R31  RC0201JR-070RL  [0201]

### Nets
1.USB_DEVICE_D_N [USB]: L7.2 ; also sheet 2
1.USB_DEVICE_D_P [USB]: L7.3 ; also sheet 2
1.USB_DEVICE_VBUS [supply]: R31.1 ; also sheet 2
COMMON_SHIELD [supply]: D9.P1 D10.P1 D11.P1 D12.P1 J3.COMMON_SHEILD1(COMMON_SHIELD1) J3.COMMON_SHEILD2(COMMON_SHIELD2) J3.COMMON_SHEILD3(COMMON_SHIELD3) J3.COMMON_SHEILD4(COMMON_SHIELD4) J3.COMMON_SHEILD5(COMMON_SHIELD5) J3.COMMON_SHEILD6(COMMON_SHIELD6) ; also sheet 5,9,15,18,20,21
D_N$11 [USB]: D10.P2 J3.P2(D-) L7.1
D_P$11 [USB]: D9.P2 J3.P3(D+) L7.4
GND [supply]: C89.2 D12.P2 J3.P5(GND) ; also sheet 2,3,4,5,6,7,9,10,11,12,13,14,15,16,17,18,19,20,21,22,23,24
ID$11: J3.P4(ID)
V5.0$11 [supply]: C89.1 D11.P2 J3.P1(VBUS) R31.2

### Notes on the sheet
- Micro-B Jack

## Sheet 9 of 24
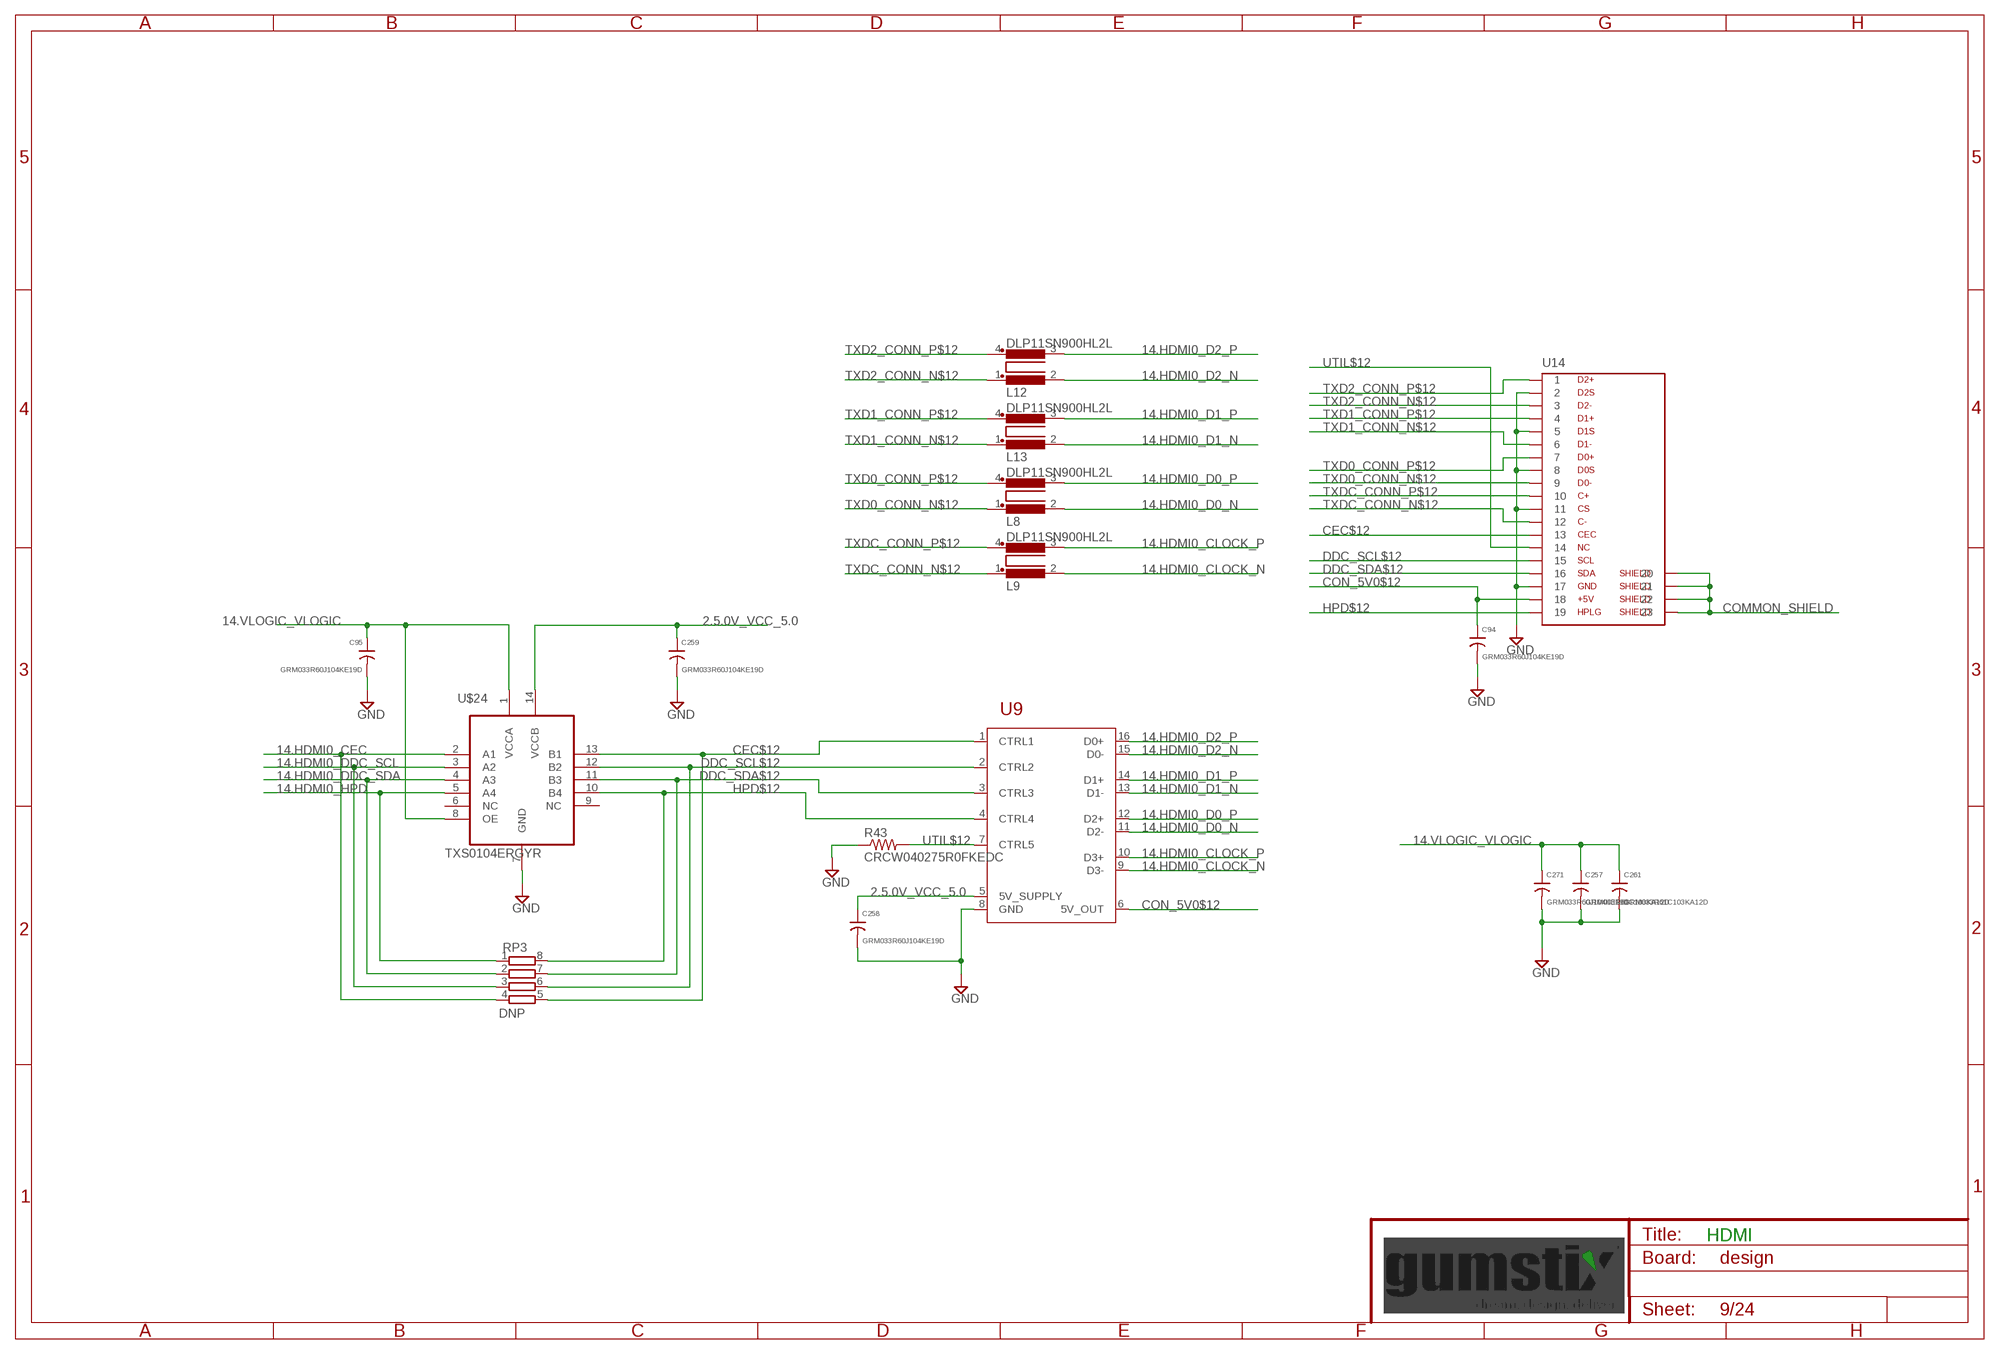
[diagram p8: schematic, sheet 9]

### Parts
C94  GRM033R60J104KE19D  [0201]
C95  GRM033R60J104KE19D  [0201]
C257  GRM033R61C103KA12D  [0201]
C258  GRM033R60J104KE19D  [0201]
C259  GRM033R60J104KE19D  [0201]
C261  GRM033R61C103KA12D  [0201]
C271  GRM033R60J104KE19D  [0201]
L8  DLP11SN900HL2L  [0504-DLP11S]
L9  DLP11SN900HL2L  [0504-DLP11S]
L12  DLP11SN900HL2L  [0504-DLP11S]
L13  DLP11SN900HL2L  [0504-DLP11S]
R43  CRCW040275R0FKEDC  [0402]
RP3  DNP  RP741X083741X08  [741X08]
U9  TPD13S523PWR  [TSSOP16]
U14  685119134923  [47151-001]
U$24  TXS0104ERGYR  [S-PVQFN-N14]

### Nets
2.5.0V_VCC_5.0 [supply]: C258.1 C259.1 U9.5(5V_SUPPLY) U$24.14(VCCB) ; also sheet 3,4,11,13,15,16
14.HDMI0_CEC: RP3.4 U$24.2(A1) ; also sheet 11
14.HDMI0_CLOCK_N [HDMI]: L9.2 U9.9(D3-) ; also sheet 11
14.HDMI0_CLOCK_P [HDMI]: L9.3 U9.10(D3+) ; also sheet 11
14.HDMI0_D0_N [HDMI]: L8.2 U9.11(D2-) ; also sheet 11
14.HDMI0_D0_P [HDMI]: L8.3 U9.12(D2+) ; also sheet 11
14.HDMI0_D1_N [HDMI]: L13.2 U9.13(D1-) ; also sheet 11
14.HDMI0_D1_P [HDMI]: L13.3 U9.14(D1+) ; also sheet 11
14.HDMI0_D2_N [HDMI]: L12.2 U9.15(D0-) ; also sheet 11
14.HDMI0_D2_P [HDMI]: L12.3 U9.16(D0+) ; also sheet 11
14.HDMI0_DDC_SCL: RP3.3 U$24.3(A2) ; also sheet 11
14.HDMI0_DDC_SDA: RP3.2 U$24.4(A3) ; also sheet 11
14.HDMI0_HPD: RP3.1 U$24.5(A4) ; also sheet 11
14.VLOGIC_VLOGIC [supply]: C95.1 C257.1 C261.1 C271.1 U$24.1(VCCA) U$24.8(OE) ; also sheet 10,11,23,24
CEC$12: RP3.5 U9.1(CTRL1) U14.13 U$24.13(B1)
COMMON_SHIELD [supply]: U14.G1 U14.G2 U14.G3 U14.G4 ; also sheet 5,8,15,18,20,21
CON_5V0$12 [supply]: C94.1 U9.6(5V_OUT) U14.18
DDC_SCL$12: RP3.6 U9.2(CTRL2) U14.15 U$24.12(B2)
DDC_SDA$12: RP3.7 U9.3(CTRL3) U14.16 U$24.11(B3)
GND [supply]: C94.2 C95.2 C257.2 C258.2 C259.2 C261.2 C271.2 R43.1 U9.8(GND) U14.2 U14.5 U14.8 U14.11 U14.17 U$24.7(GND) ; also sheet 2,3,4,5,6,7,8,10,11,12,13,14,15,16,17,18,19,20,21,22,23,24
HPD$12: RP3.8 U9.4(CTRL4) U14.19 U$24.10(B4)
TXD0_CONN_N$12 [HDMI]: L8.1 U14.9
TXD0_CONN_P$12 [HDMI]: L8.4 U14.7
TXD1_CONN_N$12 [HDMI]: L13.1 U14.6
TXD1_CONN_P$12 [HDMI]: L13.4 U14.4
TXD2_CONN_N$12 [HDMI]: L12.1 U14.3
TXD2_CONN_P$12 [HDMI]: L12.4 U14.1
TXDC_CONN_N$12 [HDMI]: L9.1 U14.12
TXDC_CONN_P$12 [HDMI]: L9.4 U14.10
UTIL$12: R43.2 U9.7(CTRL5) U14.14
Unconnected: U$24.6(NC) U$24.9(NC)

### Notes on the sheet
- HDMI

## Sheet 10 of 24
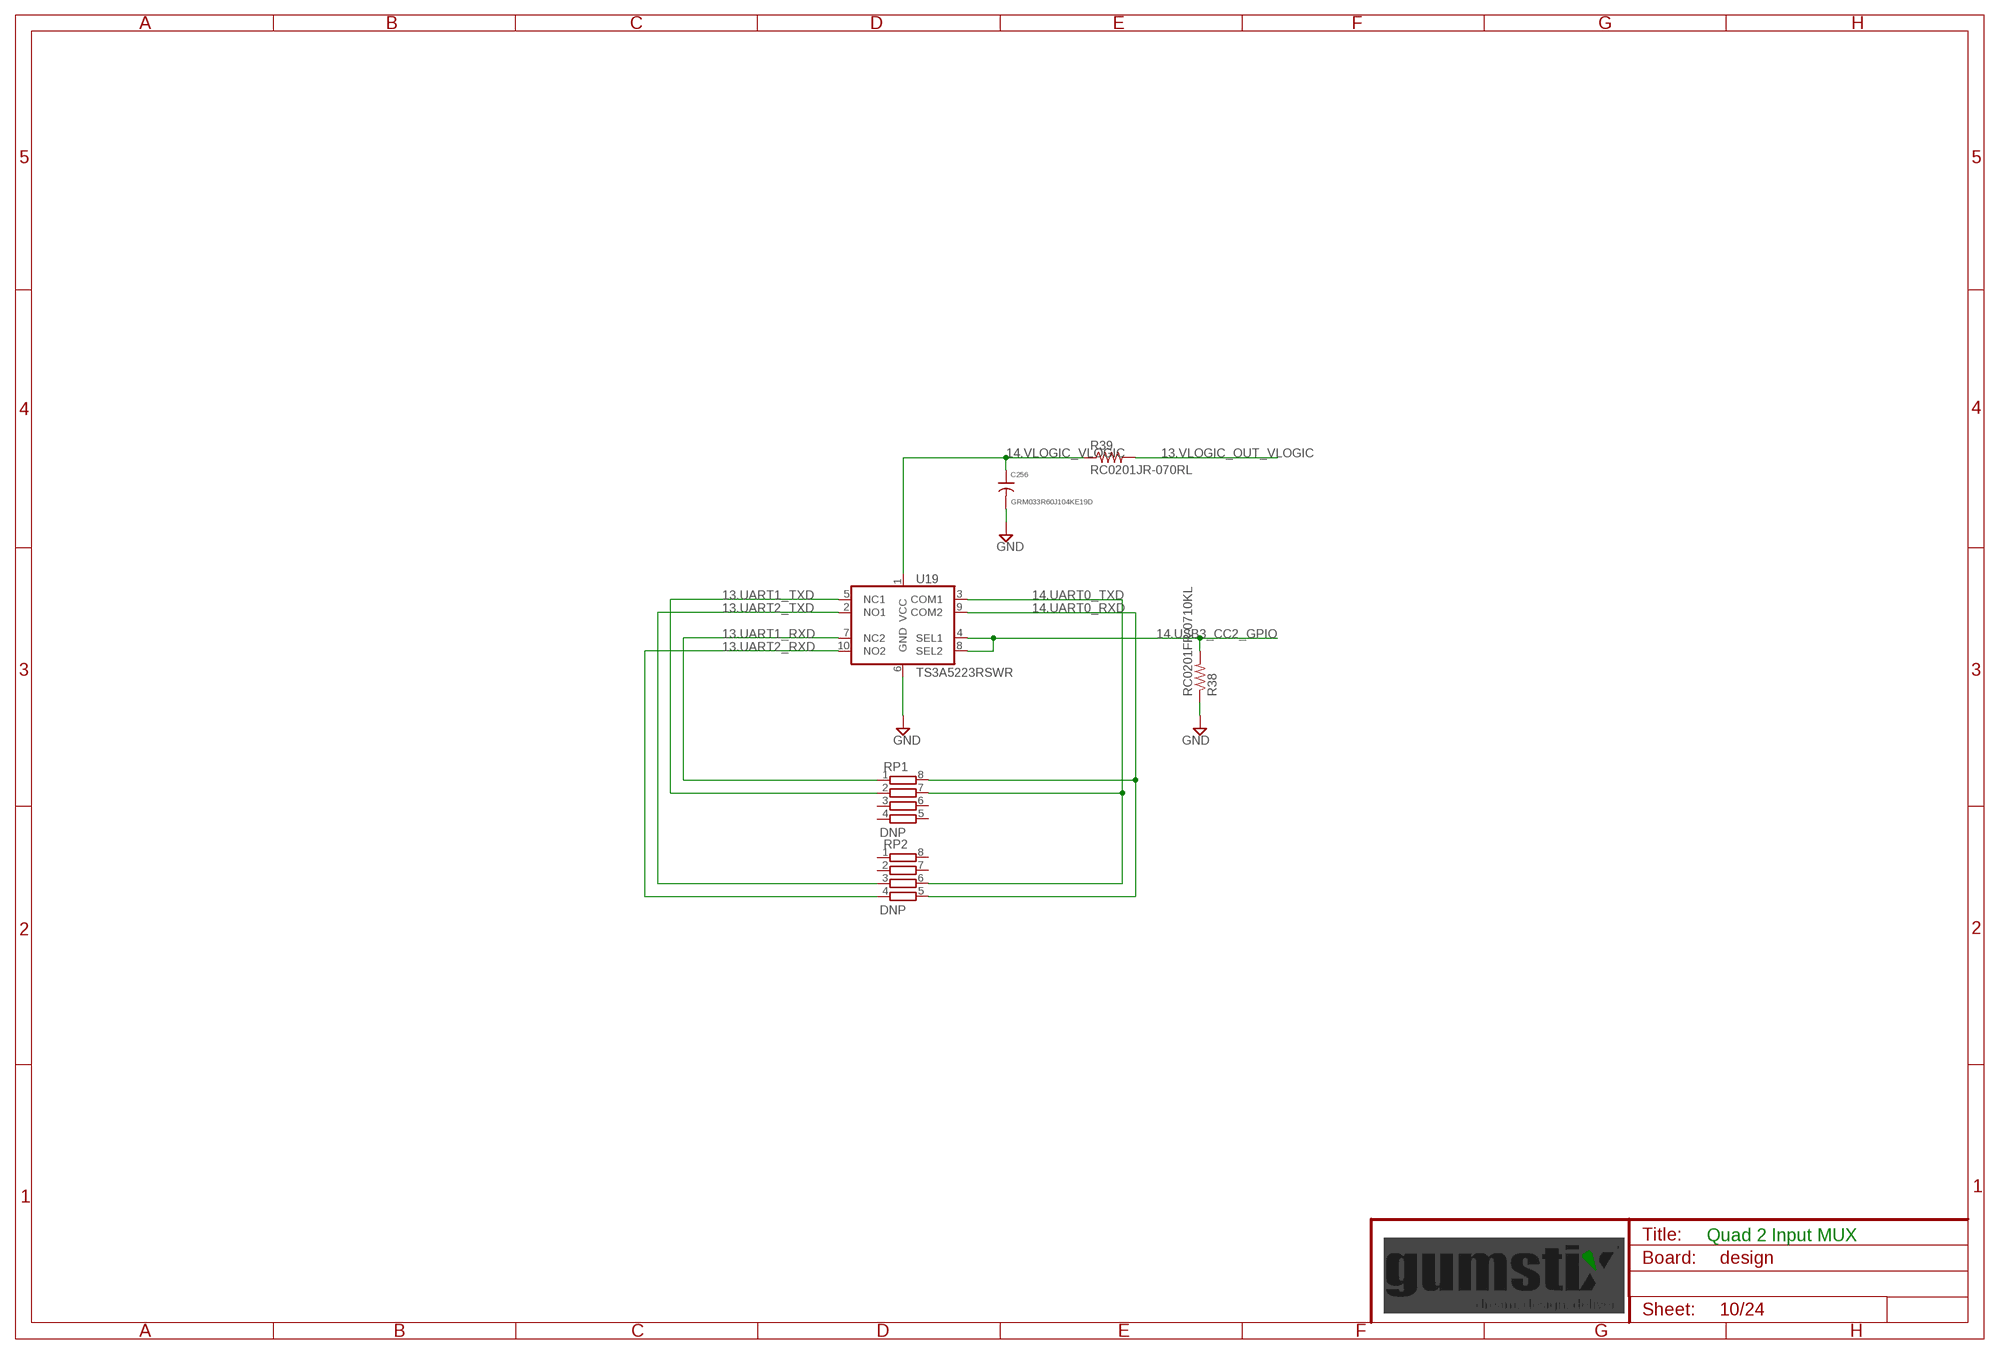
[diagram p9: schematic, sheet 10]

### Parts
C256  GRM033R60J104KE19D  [0201]
R38  RC0201FR-0710KL  [0201]
R39  RC0201JR-070RL  [0201]
RP1  DNP  RP741X083  [RP741X083]
RP2  DNP  RP741X083  [RP741X083]
U19  TS3A5223RSWR  [UQFN-10]

### Nets
13.UART1_RXD: RP1.1 U19.7(NC2) ; also sheet 13
13.UART1_TXD: RP1.2 U19.5(NC1) ; also sheet 13
13.UART2_RXD: RP2.4 U19.10(NO2) ; also sheet 2
13.UART2_TXD: RP2.3 U19.2(NO1) ; also sheet 2
13.VLOGIC_OUT_VLOGIC [supply]: R39.2 ; also sheet 2
14.UART0_RXD: RP1.8 RP2.5 U19.9(COM2) ; also sheet 11
14.UART0_TXD: RP1.7 RP2.6 U19.3(COM1) ; also sheet 11
14.USB3_CC2_GPIO: R38.2 U19.4(SEL1) U19.8(SEL2) ; also sheet 11
14.VLOGIC_VLOGIC [supply]: C256.1 R39.1 U19.1(VCC) ; also sheet 9,11,23,24
GND [supply]: C256.2 R38.1 U19.6(GND) ; also sheet 2,3,4,5,6,7,8,9,11,12,13,14,15,16,17,18,19,20,21,22,23,24
Unconnected: RP1.3 RP1.4 RP1.5 RP1.6 RP2.1 RP2.2 RP2.7 RP2.8

### Notes on the sheet
- Quad 2 Input MUX

## Sheet 11 of 24
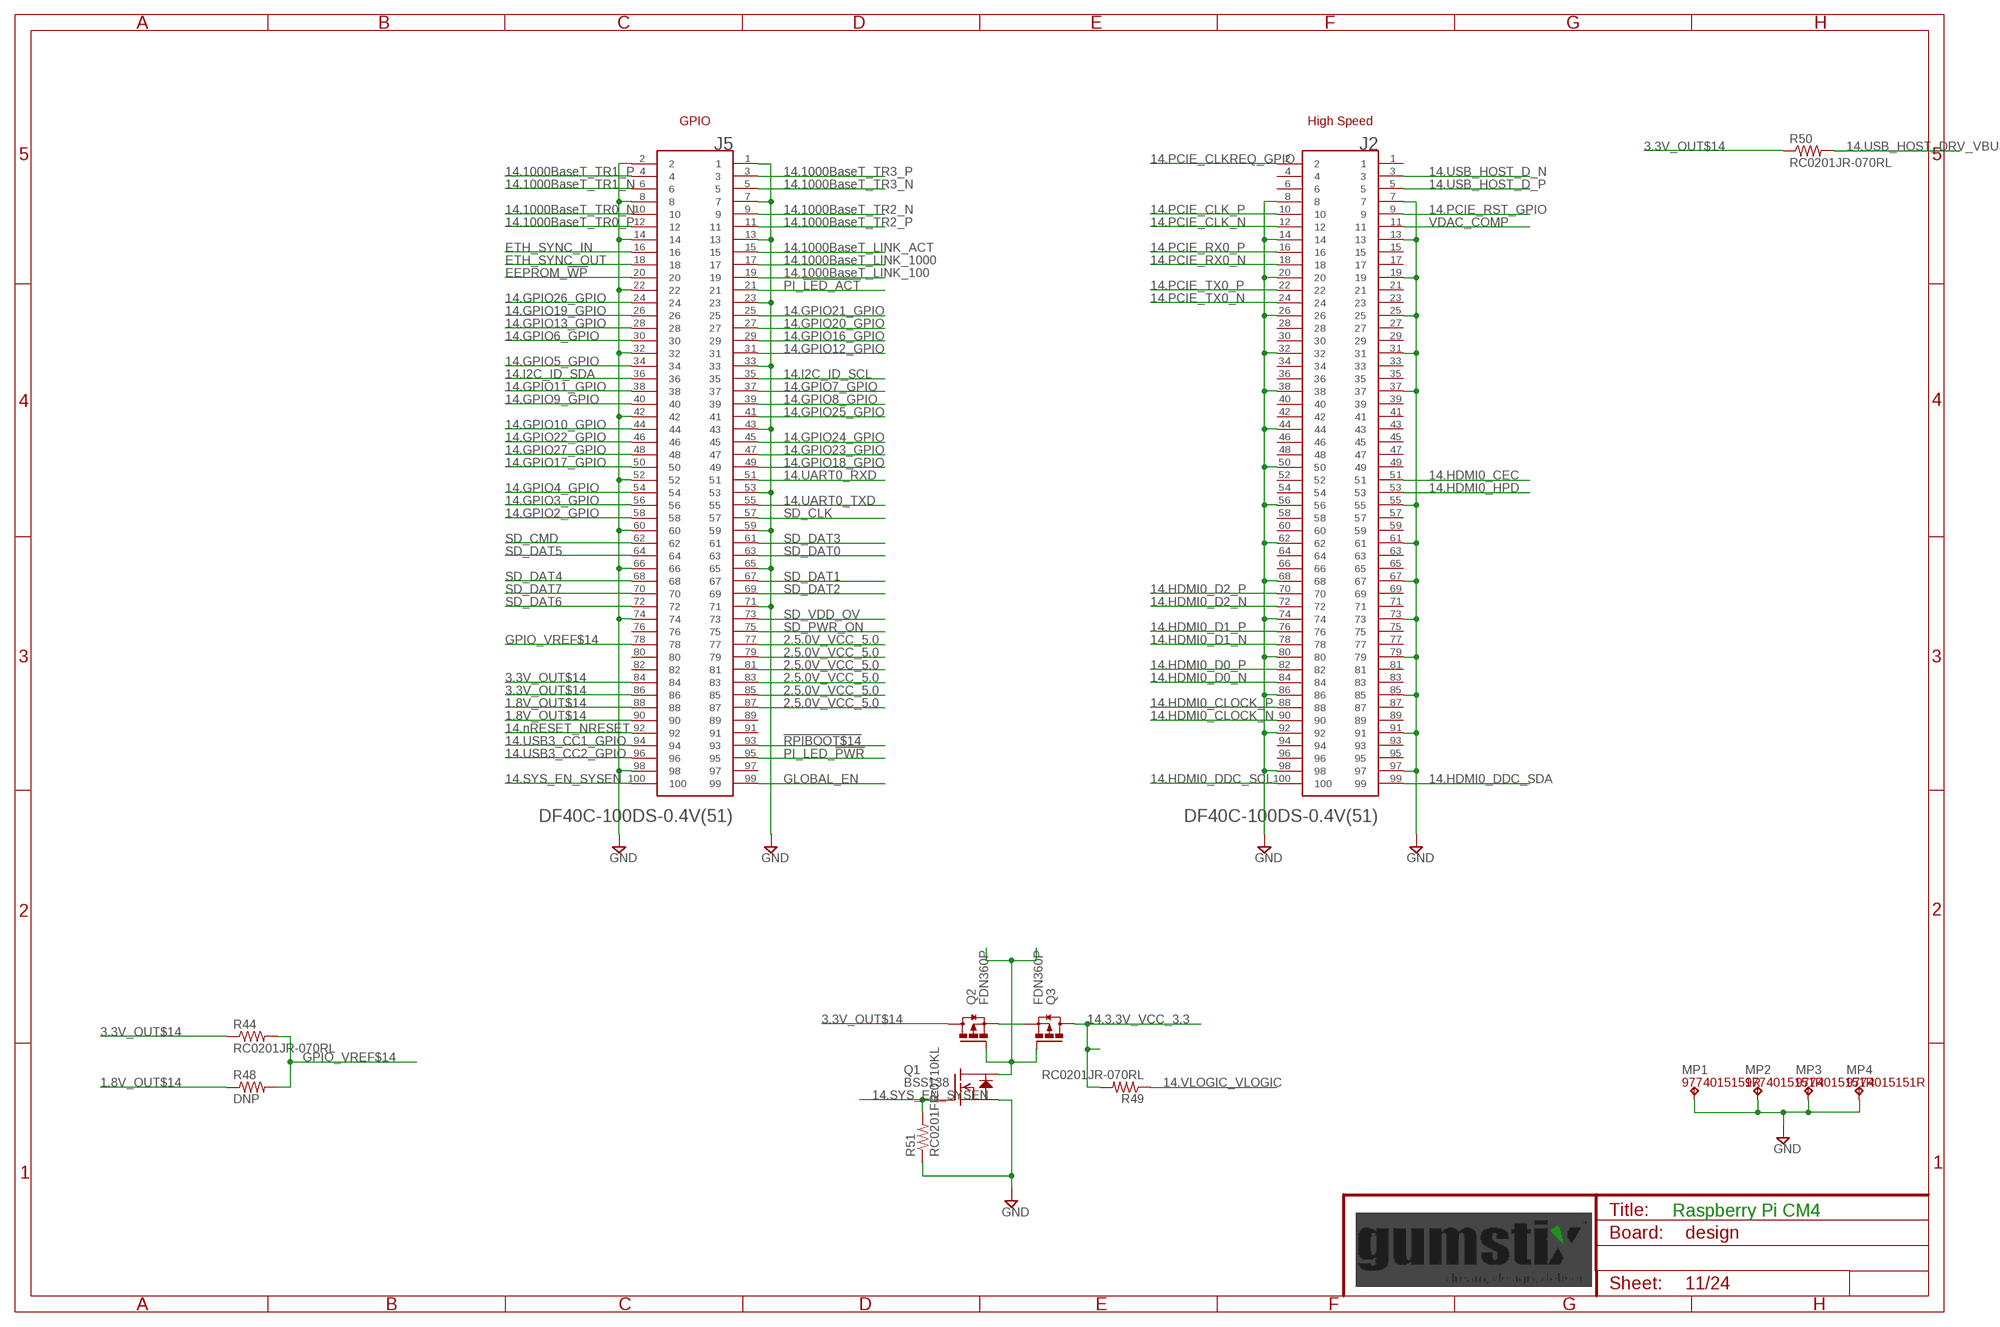
[diagram p10: schematic, sheet 11]

### Parts
J2  DF40C-100DS-0.4V(51)  [HRS_DF40C-100DS-0.4V(51)]
J5  DF40C-100DS-0.4V(51)  [HRS_DF40C-100DS-0.4V(51)]
MP1  9774015151R  [WA-SMSI_9774___151]
MP2  9774015151R  [WA-SMSI_9774___151]
MP3  9774015151R  [WA-SMSI_9774___151]
MP4  9774015151R  [WA-SMSI_9774___151]
Q1  BSS138  [SOT23]
Q2  FDN360P  [SOT23]
Q3  FDN360P  [SOT23]
R44  RC0201JR-070RL  [0201]
R48  DNP  R0201  [0201]
R49  RC0201JR-070RL  [0201]
R50  RC0201JR-070RL  [0201]
R51  RC0201FR-0710KL  [0201]

### Nets
1.8V_OUT$14 [supply]: J5.88 J5.90 R48.1
2.5.0V_VCC_5.0 [supply]: J5.77 J5.79 J5.81 J5.83 J5.85 J5.87 ; also sheet 3,4,9,13,15,16
3.3V_OUT$14 [supply]: J5.84 J5.86 Q2.3(D) R44.1 R50.1
14.3.3V_VCC_3.3 [supply]: Q3.3(D) R49.2 ; also sheet 13,16,17,20,21
14.1000BaseT_LINK_100: J5.19
14.1000BaseT_LINK_1000: J5.17 ; also sheet 5
14.1000BaseT_LINK_ACT: J5.15 ; also sheet 5
14.1000BaseT_TR0_N [HDMI]: J5.10 ; also sheet 5
14.1000BaseT_TR0_P [HDMI]: J5.12 ; also sheet 5
14.1000BaseT_TR1_N [HDMI]: J5.6 ; also sheet 5
14.1000BaseT_TR1_P [HDMI]: J5.4 ; also sheet 5
14.1000BaseT_TR2_N [HDMI]: J5.9 ; also sheet 5
14.1000BaseT_TR2_P [HDMI]: J5.11 ; also sheet 5
14.1000BaseT_TR3_N [HDMI]: J5.5 ; also sheet 5
14.1000BaseT_TR3_P [HDMI]: J5.3 ; also sheet 5
14.GPIO2_GPIO: J5.58 ; also sheet 13
14.GPIO3_GPIO: J5.56 ; also sheet 13
14.GPIO4_GPIO: J5.54 ; also sheet 13
14.GPIO5_GPIO: J5.34 ; also sheet 13
14.GPIO6_GPIO: J5.30 ; also sheet 13
14.GPIO7_GPIO: J5.37 ; also sheet 13
14.GPIO8_GPIO: J5.39 ; also sheet 13
14.GPIO9_GPIO: J5.40 ; also sheet 13
14.GPIO10_GPIO: J5.44 ; also sheet 13
14.GPIO11_GPIO: J5.38 ; also sheet 13
14.GPIO12_GPIO: J5.31 ; also sheet 13
14.GPIO13_GPIO: J5.28 ; also sheet 13
14.GPIO16_GPIO: J5.29 ; also sheet 13
14.GPIO17_GPIO: J5.50 ; also sheet 13
14.GPIO18_GPIO: J5.49 ; also sheet 13
14.GPIO19_GPIO: J5.26 ; also sheet 13
14.GPIO20_GPIO: J5.27 ; also sheet 13
14.GPIO21_GPIO: J5.25 ; also sheet 13
14.GPIO22_GPIO: J5.46 ; also sheet 13
14.GPIO23_GPIO: J5.47 ; also sheet 6,13
14.GPIO24_GPIO: J5.45 ; also sheet 13
14.GPIO25_GPIO: J5.41 ; also sheet 13
14.GPIO26_GPIO: J5.24 ; also sheet 13
14.GPIO27_GPIO: J5.48 ; also sheet 13
14.HDMI0_CEC: J2.51 ; also sheet 9
14.HDMI0_CLOCK_N [HDMI]: J2.90 ; also sheet 9
14.HDMI0_CLOCK_P [HDMI]: J2.88 ; also sheet 9
14.HDMI0_D0_N [HDMI]: J2.84 ; also sheet 9
14.HDMI0_D0_P [HDMI]: J2.82 ; also sheet 9
14.HDMI0_D1_N [HDMI]: J2.78 ; also sheet 9
14.HDMI0_D1_P [HDMI]: J2.76 ; also sheet 9
14.HDMI0_D2_N [HDMI]: J2.72 ; also sheet 9
14.HDMI0_D2_P [HDMI]: J2.70 ; also sheet 9
14.HDMI0_DDC_SCL: J2.100 ; also sheet 9
14.HDMI0_DDC_SDA: J2.99 ; also sheet 9
14.HDMI0_HPD: J2.53 ; also sheet 9
14.I2C_ID_SCL: J5.35 ; also sheet 12,13
14.I2C_ID_SDA: J5.36 ; also sheet 12,13
14.nRESET_NRESET: J5.92 ; also sheet 23
14.PCIE_CLK_N [USB]: J2.12 ; also sheet 14
14.PCIE_CLK_P [USB]: J2.10 ; also sheet 14
14.PCIE_CLKREQ_GPIO: J2.2 ; also sheet 14
14.PCIE_RST_GPIO: J2.9 ; also sheet 14
14.PCIE_RX0_N [USB]: J2.18 ; also sheet 14
14.PCIE_RX0_P [USB]: J2.16 ; also sheet 14
14.PCIE_TX0_N [USB]: J2.24 ; also sheet 14
14.PCIE_TX0_P [USB]: J2.22 ; also sheet 14
14.SYS_EN_SYSEN: J5.100 Q1.1(G) R51.2 ; also sheet 7
14.UART0_RXD: J5.51 ; also sheet 10
14.UART0_TXD: J5.55 ; also sheet 10
14.USB3_CC1_GPIO: J5.94 ; also sheet 24
14.USB3_CC2_GPIO: J5.96 ; also sheet 10
14.USB_HOST_D_N [USB]: J2.3 ; also sheet 16
14.USB_HOST_D_P [USB]: J2.5 ; also sheet 16
14.USB_HOST_DRV_VBUS: R50.2 ; also sheet 16
14.VLOGIC_VLOGIC [supply]: R49.1 ; also sheet 9,10,23,24
!RPIBOOT$14: J5.93 ; also sheet 12
DS_LOAD$14 [supply]: Q2.2(S) Q3.2(S)
EEPROM_!WP: J5.20
ETH_SYNC_IN: J5.16
ETH_SYNC_OUT: J5.18
GLOBAL_EN: J5.99
GND [supply]: J2.7 J2.8 J2.13 J2.14 J2.19 J2.20 J2.25 J2.26 J2.31 J2.32 J2.37 J2.38 J2.44 J2.50 J2.55 J2.56 J2.61 J2.62 J2.67 J2.68 J2.73 J2.74 J2.79 J2.80 J2.85 J2.86 J2.91 J2.92 J2.97 J2.98 J5.1 J5.2 J5.7 J5.8 J5.13 J5.14 J5.22 J5.23 J5.32 J5.33 J5.42 J5.43 J5.52 J5.53 J5.59 J5.60 J5.65 J5.66 J5.71 J5.74 J5.98 MP1.1(TP) MP2.1(TP) MP3.1(TP) MP4.1(TP) Q1.2(S) R51.1 ; also sheet 2,3,4,5,6,7,8,9,10,12,13,14,15,16,17,18,19,20,21,22,23,24
GPIO_VREF$14 [supply]: J5.78 R44.2 R48.2 ; also sheet 12
LOAD_GATE$14: Q1.3(D) Q2.1(G) Q3.1(G)
PI_!LED_ACT: J5.21
PI_LED_!PWR: J5.95
SD_CLK: J5.57
SD_CMD: J5.62
SD_DAT0: J5.63
SD_DAT1: J5.67
SD_DAT2: J5.69
SD_DAT3: J5.61
SD_DAT4: J5.68
SD_DAT5: J5.64
SD_DAT6: J5.72
SD_DAT7: J5.70
SD_PWR_ON: J5.75
SD_VDD_OV: J5.73
VDAC_COMP: J2.11
Unconnected: J2.1 J2.4 J2.6 J2.15 J2.17 J2.21 J2.23 J2.27 J2.28 J2.29 J2.30 J2.33 J2.34 J2.35 J2.36 J2.39 J2.40 J2.41 J2.42 J2.43 J2.45 J2.46 J2.47 J2.48 J2.49 J2.52 J2.54 J2.57 J2.58 J2.59 J2.60 J2.63 J2.64 J2.65 J2.66 J2.69 J2.71 J2.75 J2.77 J2.81 J2.83 J2.87 J2.89 J2.93 J2.94 J2.95 J2.96 J5.76 J5.80 J5.82 J5.89 J5.91 J5.97

### Notes on the sheet
- GPIO | High Speed
- Raspberry Pi CM4

## Sheet 12 of 24
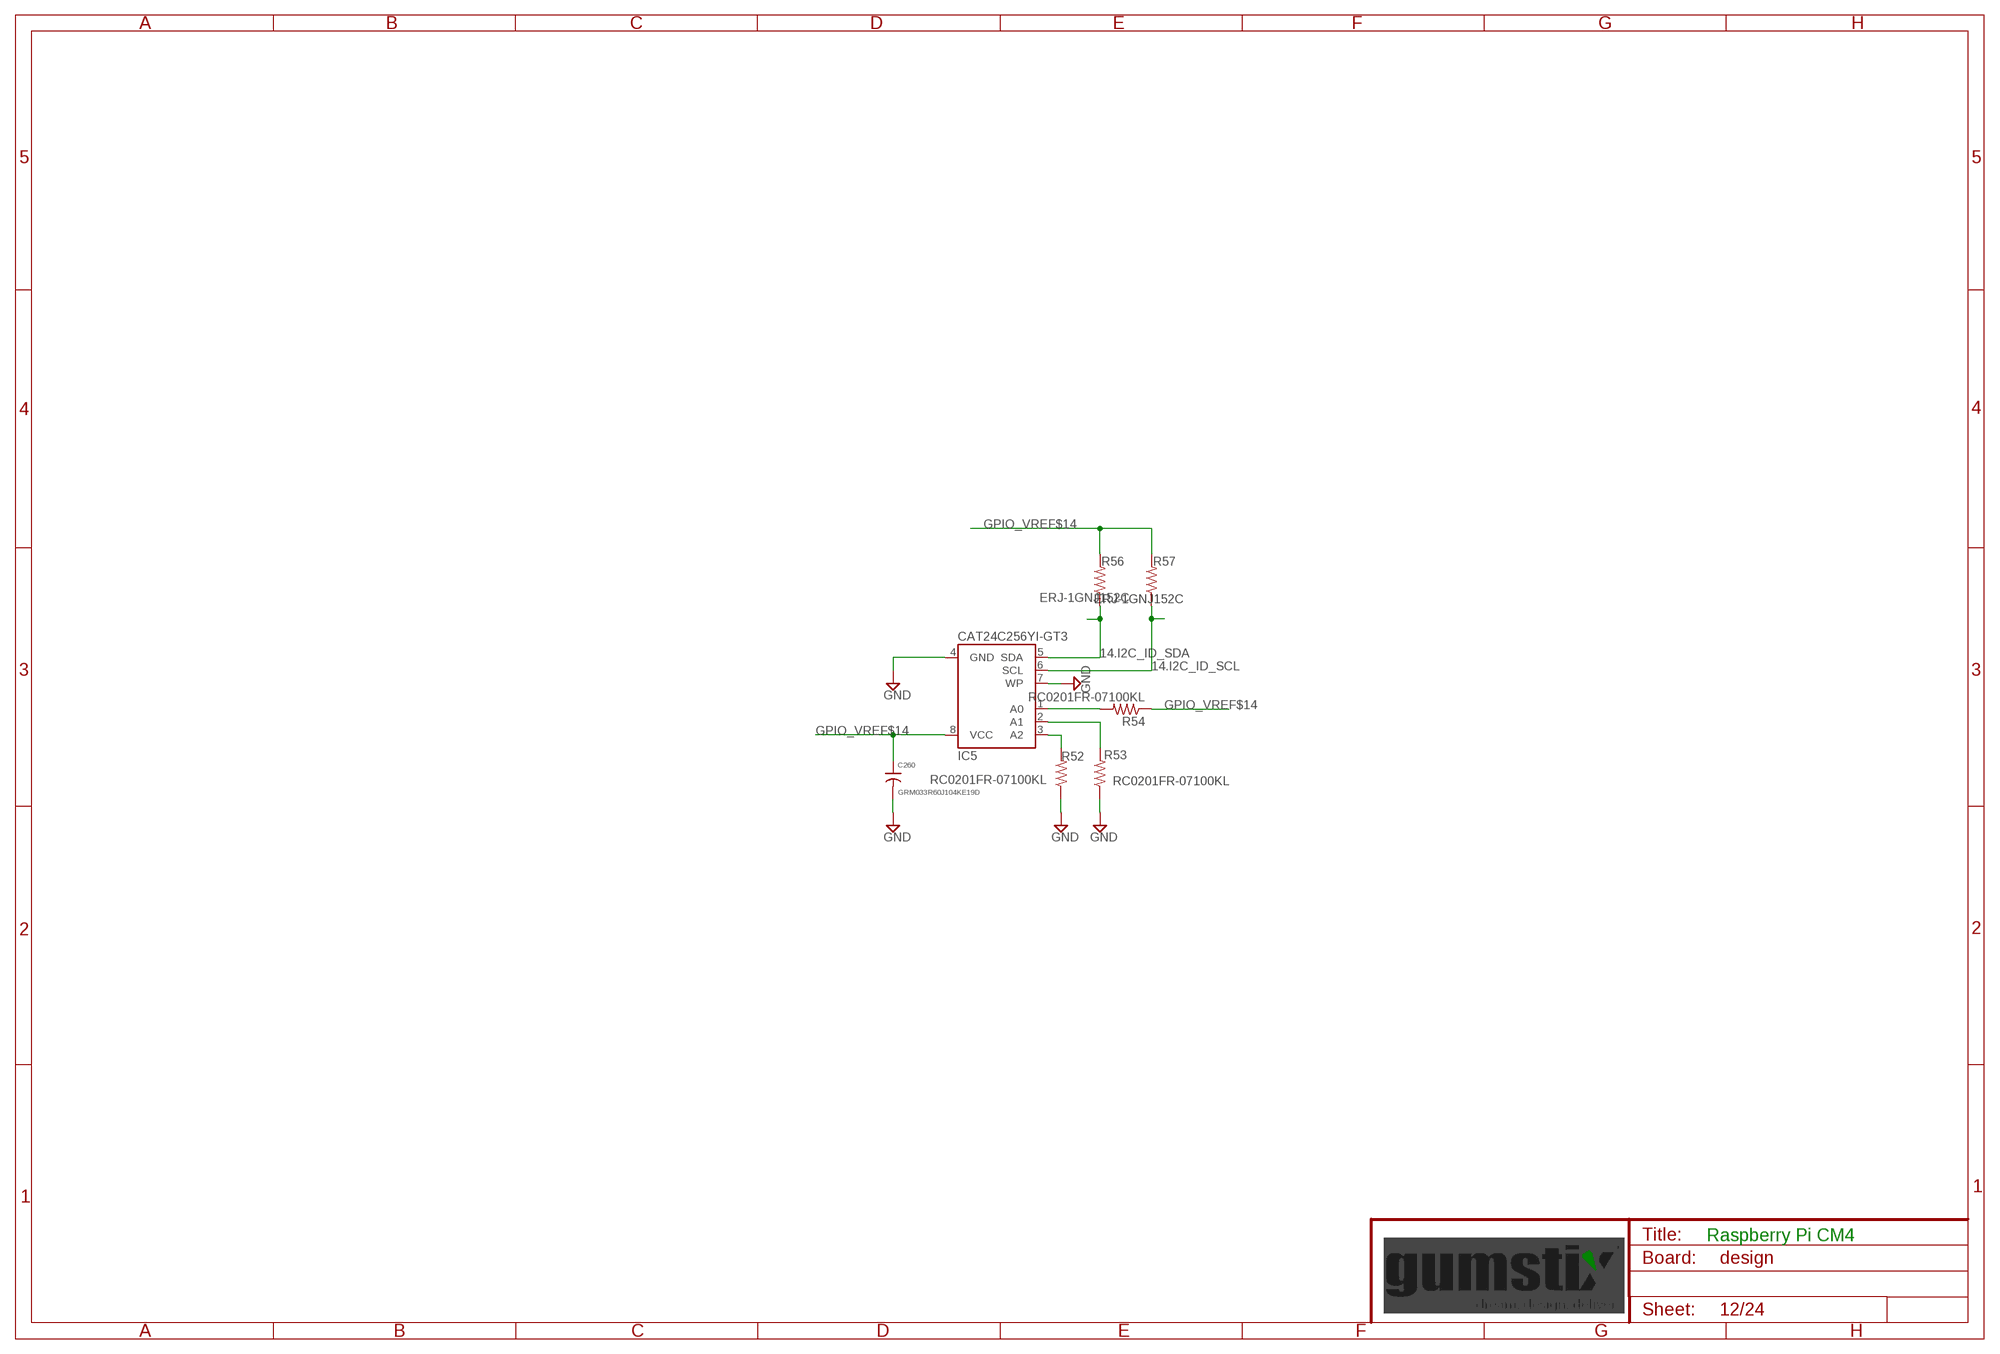
[diagram p11: schematic, sheet 12]

### Parts
C260  GRM033R60J104KE19D  [0201]
IC5  CAT24C256YI-GT3  [TSSOP8]
R52  RC0201FR-07100KL  [0201]
R53  RC0201FR-07100KL  [0201]
R54  RC0201FR-07100KL  [0201]
R56  ERJ-1GNJ152C  [0201]
R57  ERJ-1GNJ152C  [0201]

### Nets
14.I2C_ID_SCL: IC5.6(SCL) R57.1 ; also sheet 11,13
14.I2C_ID_SDA: IC5.5(SDA) R56.1 ; also sheet 11,13
A0$14: IC5.1(A0) R54.2
A1$14: IC5.2(A1) R53.2
A2$14: IC5.3(A2) R52.2
GND [supply]: C260.2 IC5.4(GND) IC5.7(WP) R52.1 R53.1 ; also sheet 2,3,4,5,6,7,8,9,10,11,13,14,15,16,17,18,19,20,21,22,23,24
GPIO_VREF$14 [supply]: C260.1 IC5.8(VCC) R54.1 R56.2 R57.2 ; also sheet 11

### Notes on the sheet
- Raspberry Pi CM4

## Sheet 13 of 24
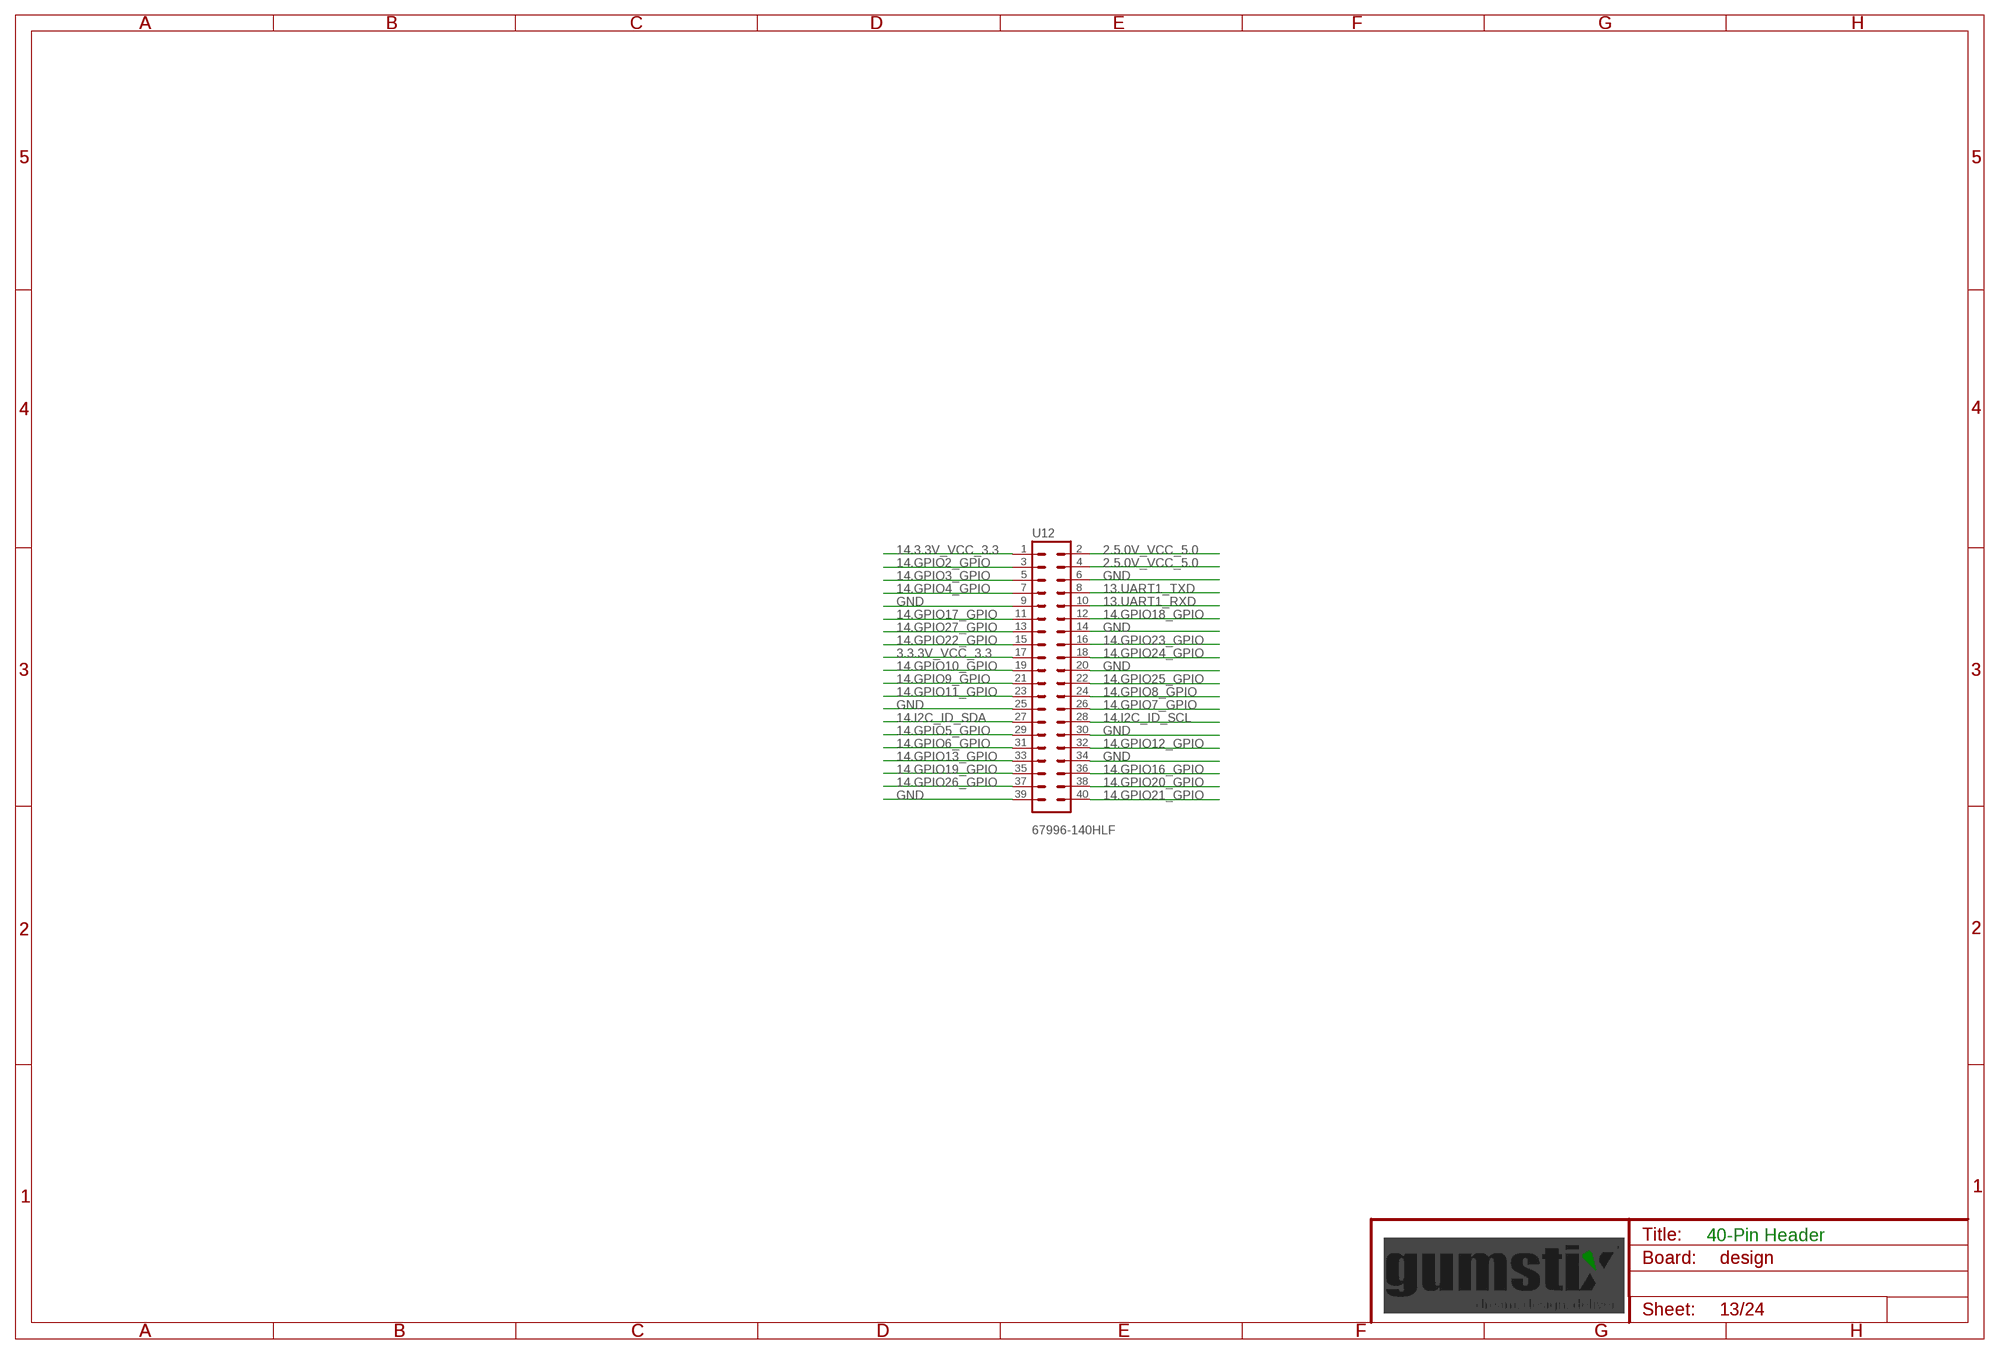
[diagram p12: schematic, sheet 13]

### Parts
U12  67996-140HLF  [2X20]

### Nets
2.5.0V_VCC_5.0 [supply]: U12.2 U12.4 ; also sheet 3,4,9,11,15,16
3.3.3V_VCC_3.3 [supply]: U12.17 ; also sheet 4,5,6,7,14
13.UART1_RXD: U12.10 ; also sheet 10
13.UART1_TXD: U12.8 ; also sheet 10
14.3.3V_VCC_3.3 [supply]: U12.1 ; also sheet 11,16,17,20,21
14.GPIO2_GPIO: U12.3 ; also sheet 11
14.GPIO3_GPIO: U12.5 ; also sheet 11
14.GPIO4_GPIO: U12.7 ; also sheet 11
14.GPIO5_GPIO: U12.29 ; also sheet 11
14.GPIO6_GPIO: U12.31 ; also sheet 11
14.GPIO7_GPIO: U12.26 ; also sheet 11
14.GPIO8_GPIO: U12.24 ; also sheet 11
14.GPIO9_GPIO: U12.21 ; also sheet 11
14.GPIO10_GPIO: U12.19 ; also sheet 11
14.GPIO11_GPIO: U12.23 ; also sheet 11
14.GPIO12_GPIO: U12.32 ; also sheet 11
14.GPIO13_GPIO: U12.33 ; also sheet 11
14.GPIO16_GPIO: U12.36 ; also sheet 11
14.GPIO17_GPIO: U12.11 ; also sheet 11
14.GPIO18_GPIO: U12.12 ; also sheet 11
14.GPIO19_GPIO: U12.35 ; also sheet 11
14.GPIO20_GPIO: U12.38 ; also sheet 11
14.GPIO21_GPIO: U12.40 ; also sheet 11
14.GPIO22_GPIO: U12.15 ; also sheet 11
14.GPIO23_GPIO: U12.16 ; also sheet 6,11
14.GPIO24_GPIO: U12.18 ; also sheet 11
14.GPIO25_GPIO: U12.22 ; also sheet 11
14.GPIO26_GPIO: U12.37 ; also sheet 11
14.GPIO27_GPIO: U12.13 ; also sheet 11
14.I2C_ID_SCL: U12.28 ; also sheet 11,12
14.I2C_ID_SDA: U12.27 ; also sheet 11,12
GND [supply]: U12.6 U12.9 U12.14 U12.20 U12.25 U12.30 U12.34 U12.39 ; also sheet 2,3,4,5,6,7,8,9,10,11,12,14,15,16,17,18,19,20,21,22,23,24

### Notes on the sheet
- 40-Pin Header

## Sheet 14 of 24
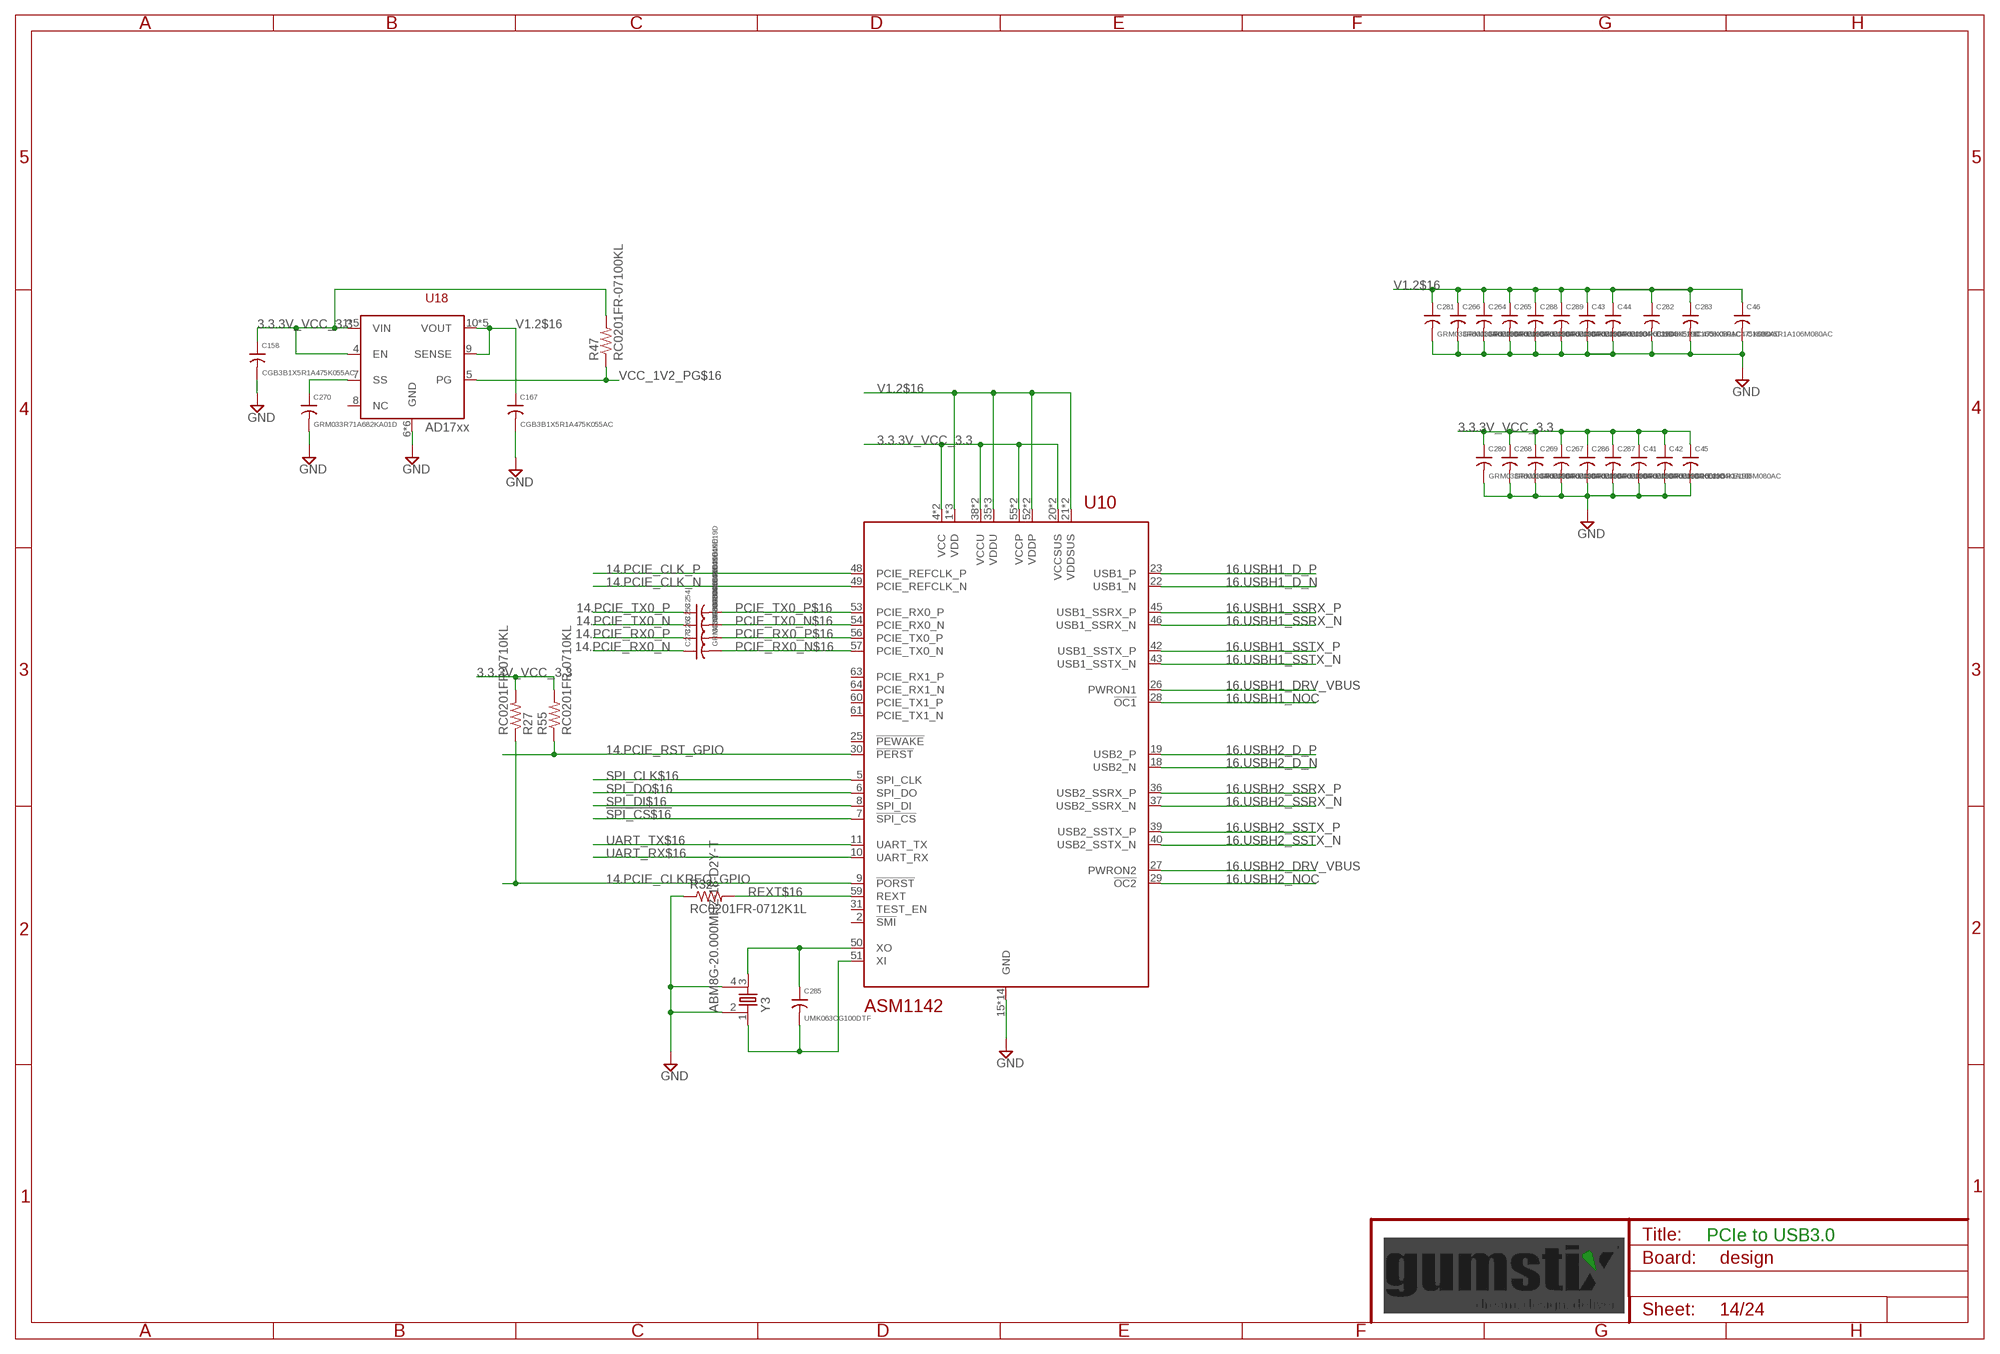
[diagram p13: schematic, sheet 14]

### Parts
C41  GRM033R60J104KE19D  [0201]
C42  GRM033R60J104KE19D  [0201]
C43  GRM033R60J104KE19D  [0201]
C44  GRM033R60J104KE19D  [0201]
C45  C1608X5R1A106M080AC  [0603]
C46  C1608X5R1A106M080AC  [0603]
C158  CGB3B1X5R1A475K055AC  [0603]
C167  CGB3B1X5R1A475K055AC  [0603]
C253  GRM033R60J104KE19D  [0201]
C254  GRM033R60J104KE19D  [0201]
C263  GRM033R60J104KE19D  [0201]
C264  GRM033R60J104KE19D  [0201]
C265  GRM033R60J104KE19D  [0201]
C266  GRM033R60J104KE19D  [0201]
C267  GRM033R60J104KE19D  [0201]
C268  GRM033R60J104KE19D  [0201]
C269  GRM033R60J104KE19D  [0201]
C270  GRM033R71A682KA01D  [0201]
C273  GRM033R60J104KE19D  [0201]
C280  GRM033R60J104KE19D  [0201]
C281  GRM033R60J104KE19D  [0201]
C282  C1608X5R1C475K080AC  [0603]
C283  C1608X5R1C475K080AC  [0603]
C285  UMK063CG100DTF  [0201]
C286  GRM033R60J104KE19D  [0201]
C287  GRM033R60J104KE19D  [0201]
C288  GRM033R60J104KE19D  [0201]
C289  GRM033R60J104KE19D  [0201]
R27  RC0201FR-0710KL  [0201]
R32  RC0201FR-0712K1L  [0201]
R47  RC0201FR-07100KL  [0201]
R55  RC0201FR-0710KL  [0201]
U10  ASM1142  [QFN64-9X9MM-FT2232HQ]
U18  ADP1740ACPZ-1.2-R7  [LFCSPWQ16]
Y3  ABM8G-20.000MHZ-18-D2Y-T  [CRYSTAL-3225]

### Nets
3.3.3V_VCC_3.3 [supply]: C41.1 C42.1 C45.1 C158.1 C267.1 C268.1 C269.1 C280.1 C286.1 C287.1 R27.2 R47.2 R55.2 U10.4(VCC) U10.20(VCCSUS) U10.24(VCCSUS) U10.32(VCC) U10.38(VCCU) U10.44(VCCU) U10.55(VCCP) U10.62(VCCP) U18.1(VIN) U18.2(VIN) U18.3(VIN) U18.4(EN) U18.15(VIN) U18.16(VIN) ; also sheet 4,5,6,7,13
14.PCIE_CLK_N [USB]: U10.49(PCIE_REFCLK_N) ; also sheet 11
14.PCIE_CLK_P [USB]: U10.48(PCIE_REFCLK_P) ; also sheet 11
14.PCIE_CLKREQ_GPIO: R27.1 U10.9(!PORST) ; also sheet 11
14.PCIE_RST_GPIO: R55.1 U10.30(!PERST) ; also sheet 11
14.PCIE_RX0_N [USB]: C273.1 ; also sheet 11
14.PCIE_RX0_P [USB]: C263.1 ; also sheet 11
14.PCIE_TX0_N [USB]: C253.1 ; also sheet 11
14.PCIE_TX0_P [USB]: C254.1 ; also sheet 11
16.USBH1_D_N [USB]: U10.22(USB1_N) ; also sheet 17
16.USBH1_D_P [USB]: U10.23(USB1_P) ; also sheet 17
16.USBH1_DRV_VBUS: U10.26(PWRON1)
16.USBH1_NOC: U10.28(!OC1)
16.USBH1_SSRX_N [USB]: U10.46(USB1_SSRX_N) ; also sheet 17
16.USBH1_SSRX_P [USB]: U10.45(USB1_SSRX_P) ; also sheet 17
16.USBH1_SSTX_N [USB]: U10.43(USB1_SSTX_N) ; also sheet 17
16.USBH1_SSTX_P [USB]: U10.42(USB1_SSTX_P) ; also sheet 17
16.USBH2_D_N [USB]: U10.18(USB2_N) ; also sheet 20
16.USBH2_D_P [USB]: U10.19(USB2_P) ; also sheet 20
16.USBH2_DRV_VBUS: U10.27(PWRON2) ; also sheet 20
16.USBH2_NOC: U10.29(!OC2) ; also sheet 20
16.USBH2_SSRX_N [USB]: U10.37(USB2_SSRX_N) ; also sheet 20
16.USBH2_SSRX_P [USB]: U10.36(USB2_SSRX_P) ; also sheet 20
16.USBH2_SSTX_N [USB]: U10.40(USB2_SSTX_N) ; also sheet 20
16.USBH2_SSTX_P [USB]: U10.39(USB2_SSTX_P) ; also sheet 20
!SPI_CS$16: U10.7(!SPI_CS)
GND [supply]: C41.2 C42.2 C43.2 C44.2 C45.2 C46.2 C158.2 C167.2 C264.2 C265.2 C266.2 C267.2 C268.2 C269.2 C270.2 C280.2 C281.2 C282.2 C283.2 C286.2 C287.2 C288.2 C289.2 R32.1 U10.15(GND) U10.65(GND) U10.EPAD1(GND) U10.EPAD2(GND) U10.EPAD3(GND) U10.EPAD4(GND) U10.EPAD5(GND) U10.EPAD6(GND) U10.EPAD7(GND) U10.EPAD8(GND) U10.EPAD9(GND) U10.EPAD10(GND) U10.EPAD11(GND) U10.EPAD12(GND) U18.6(GND) U18.EP1(GND) U18.EP2(GND) U18.EP3(GND) U18.EP4(GND) U18.EP(GND) Y3.2 Y3.4 ; also sheet 2,3,4,5,6,7,8,9,10,11,12,13,15,16,17,18,19,20,21,22,23,24
PCIE_RX0_N$16 [HDMI]: C273.2 U10.57(PCIE_TX0_N)
PCIE_RX0_P$16 [HDMI]: C263.2 U10.56(PCIE_TX0_P)
PCIE_TX0_N$16 [HDMI]: C253.2 U10.54(PCIE_RX0_N)
PCIE_TX0_P$16 [HDMI]: C254.2 U10.53(PCIE_RX0_P)
REXT$16: R32.2 U10.59(REXT)
SPI_CLK$16: U10.5(SPI_CLK)
SPI_DI$16: U10.8(SPI_DI)
SPI_DO$16: U10.6(SPI_DO)
UART_RX$16: U10.10(UART_RX)
UART_TX$16: U10.11(UART_TX)
V1.2$16 [supply]: C43.1 C44.1 C46.1 C167.1 C264.1 C265.1 C266.1 C281.1 C282.1 C283.1 C288.1 C289.1 U10.1(VDD) U10.12(VDD) U10.21(VDDSUS) U10.33(VDD) U10.34(VDDSUS) U10.35(VDDU) U10.41(VDDU) U10.47(VDDU) U10.52(VDDP) U10.58(VDDP) U18.9(SENSE) U18.10(VOUT) U18.11(VOUT) U18.12(VOUT) U18.13(VOUT) U18.14(VOUT)
VCC1V1_SS$16: C270.1 U18.7(SS)
VCC_1V2_PG$16: R47.1 U18.5(PG)
XI$16: C285.2 U10.51(XI) Y3.1
XO$16: C285.1 U10.50(XO) Y3.3
Unconnected: U10.2(!SMI) U10.25(!PEWAKE) U10.31(TEST_EN) U10.60(PCIE_TX1_P) U10.61(PCIE_TX1_N) U10.63(PCIE_RX1_P) U10.64(PCIE_RX1_N) U18.8(NC)

### Notes on the sheet
- PCIe to USB3.0

## Sheet 15 of 24
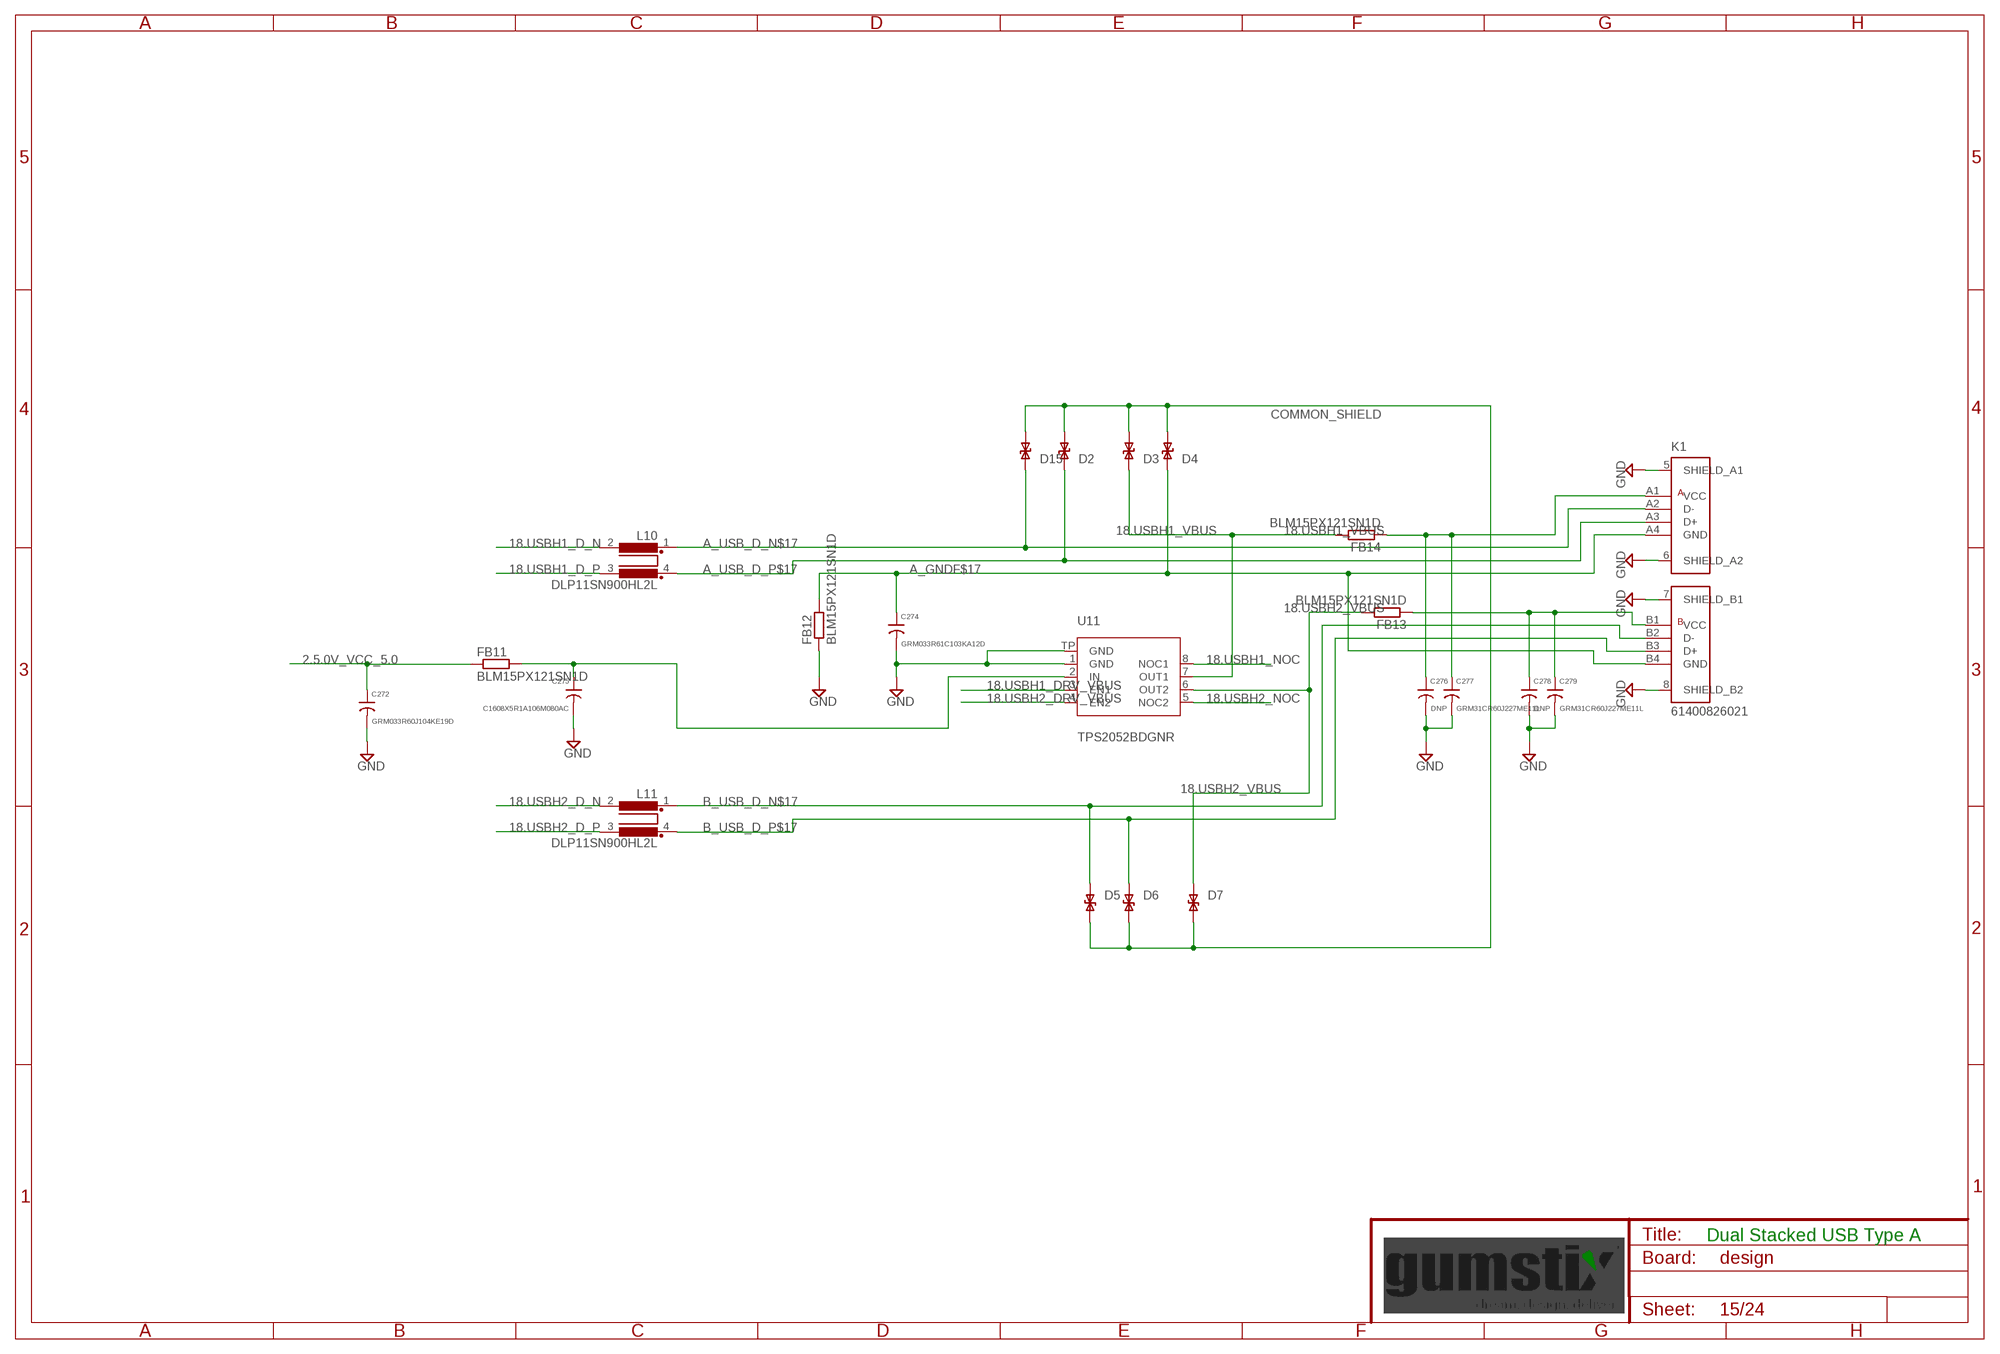
[diagram p14: schematic, sheet 15]

### Parts
C272  GRM033R60J104KE19D  [0201]
C274  GRM033R61C103KA12D  [0201]
C275  C1608X5R1A106M080AC  [0603]
C276  DNP  C1206  [1206]
C277  GRM31CR60J227ME11L  [1206]
C278  DNP  C1206  [1206]
C279  GRM31CR60J227ME11L  [1206]
D2  PS04LTVA1  [D0402]
D3  B72590D0050A060  [D0402]
D4  B72590D0050A060  [D0402]
D5  PS04LTVA1  [D0402]
D6  PS04LTVA1  [D0402]
D7  B72590D0050A060  [D0402]
D15  PS04LTVA1  [D0402]
FB11  BLM15PX121SN1D  [0402]
FB12  BLM15PX121SN1D  [0402]
FB13  BLM15PX121SN1D  [0402]
FB14  BLM15PX121SN1D  [0402]
K1  61400826021  [61400826021]
L10  DLP11SN900HL2L  [0504-DLP11S]
L11  DLP11SN900HL2L  [0504-DLP11S]
U11  TPS2052BDGNR  [MSOP8-PAD]

### Nets
2.5.0V_VCC_5.0 [supply]: C272.1 FB11.1 ; also sheet 3,4,9,11,13,16
18.USBH1_D_N [USB]: L10.2 ; also sheet 16
18.USBH1_D_P [USB]: L10.3 ; also sheet 16
18.USBH1_DRV_VBUS: U11.3(EN1) ; also sheet 16
18.USBH1_NOC: U11.8(NOC1) ; also sheet 16
18.USBH1_VBUS [supply]: D3.P2 FB14.2 U11.7(OUT1) ; also sheet 16
18.USBH2_D_N [USB]: L11.2 ; also sheet 16
18.USBH2_D_P [USB]: L11.3 ; also sheet 16
18.USBH2_DRV_VBUS: U11.4(EN2) ; also sheet 16
18.USBH2_NOC: U11.5(NOC2) ; also sheet 16
18.USBH2_VBUS [supply]: D7.P2 FB13.2 U11.6(OUT2) ; also sheet 16
A_GNDF$17 [supply]: C274.1 D4.P2 FB12.2 K1.A4(GND) K1.B4(GND)
A_USB_D_N$17 [USB]: D15.P2 K1.A2(D-) L10.1
A_USB_D_P$17 [USB]: D2.P2 K1.A3(D+) L10.4
A_VBUS_$17 [supply]: C276.1 C277.1 FB14.1 K1.A1(VCC)
B_USB_D_N$17 [USB]: D5.P2 K1.B2(D-) L11.1
B_USB_D_P$17 [USB]: D6.P2 K1.B3(D+) L11.4
B_VBUS_$17 [supply]: C278.1 C279.1 FB13.1 K1.B1(VCC)
COMMON_SHIELD [supply]: D2.P1 D3.P1 D4.P1 D5.P1 D6.P1 D7.P1 D15.P1 ; also sheet 5,8,9,18,20,21
GND [supply]: C272.2 C274.2 C275.2 C276.2 C277.2 C278.2 C279.2 FB12.1 K1.5(SHIELD_A1) K1.6(SHIELD_A2) K1.7(SHIELD_B1) K1.8(SHIELD_B2) U11.1(GND) U11.TP(GND) ; also sheet 2,3,4,5,6,7,8,9,10,11,12,13,14,16,17,18,19,20,21,22,23,24
VBUSF$17 [supply]: C275.1 FB11.2 U11.2(IN)

### Notes on the sheet
- Dual Stacked USB Type A

## Sheet 16 of 24
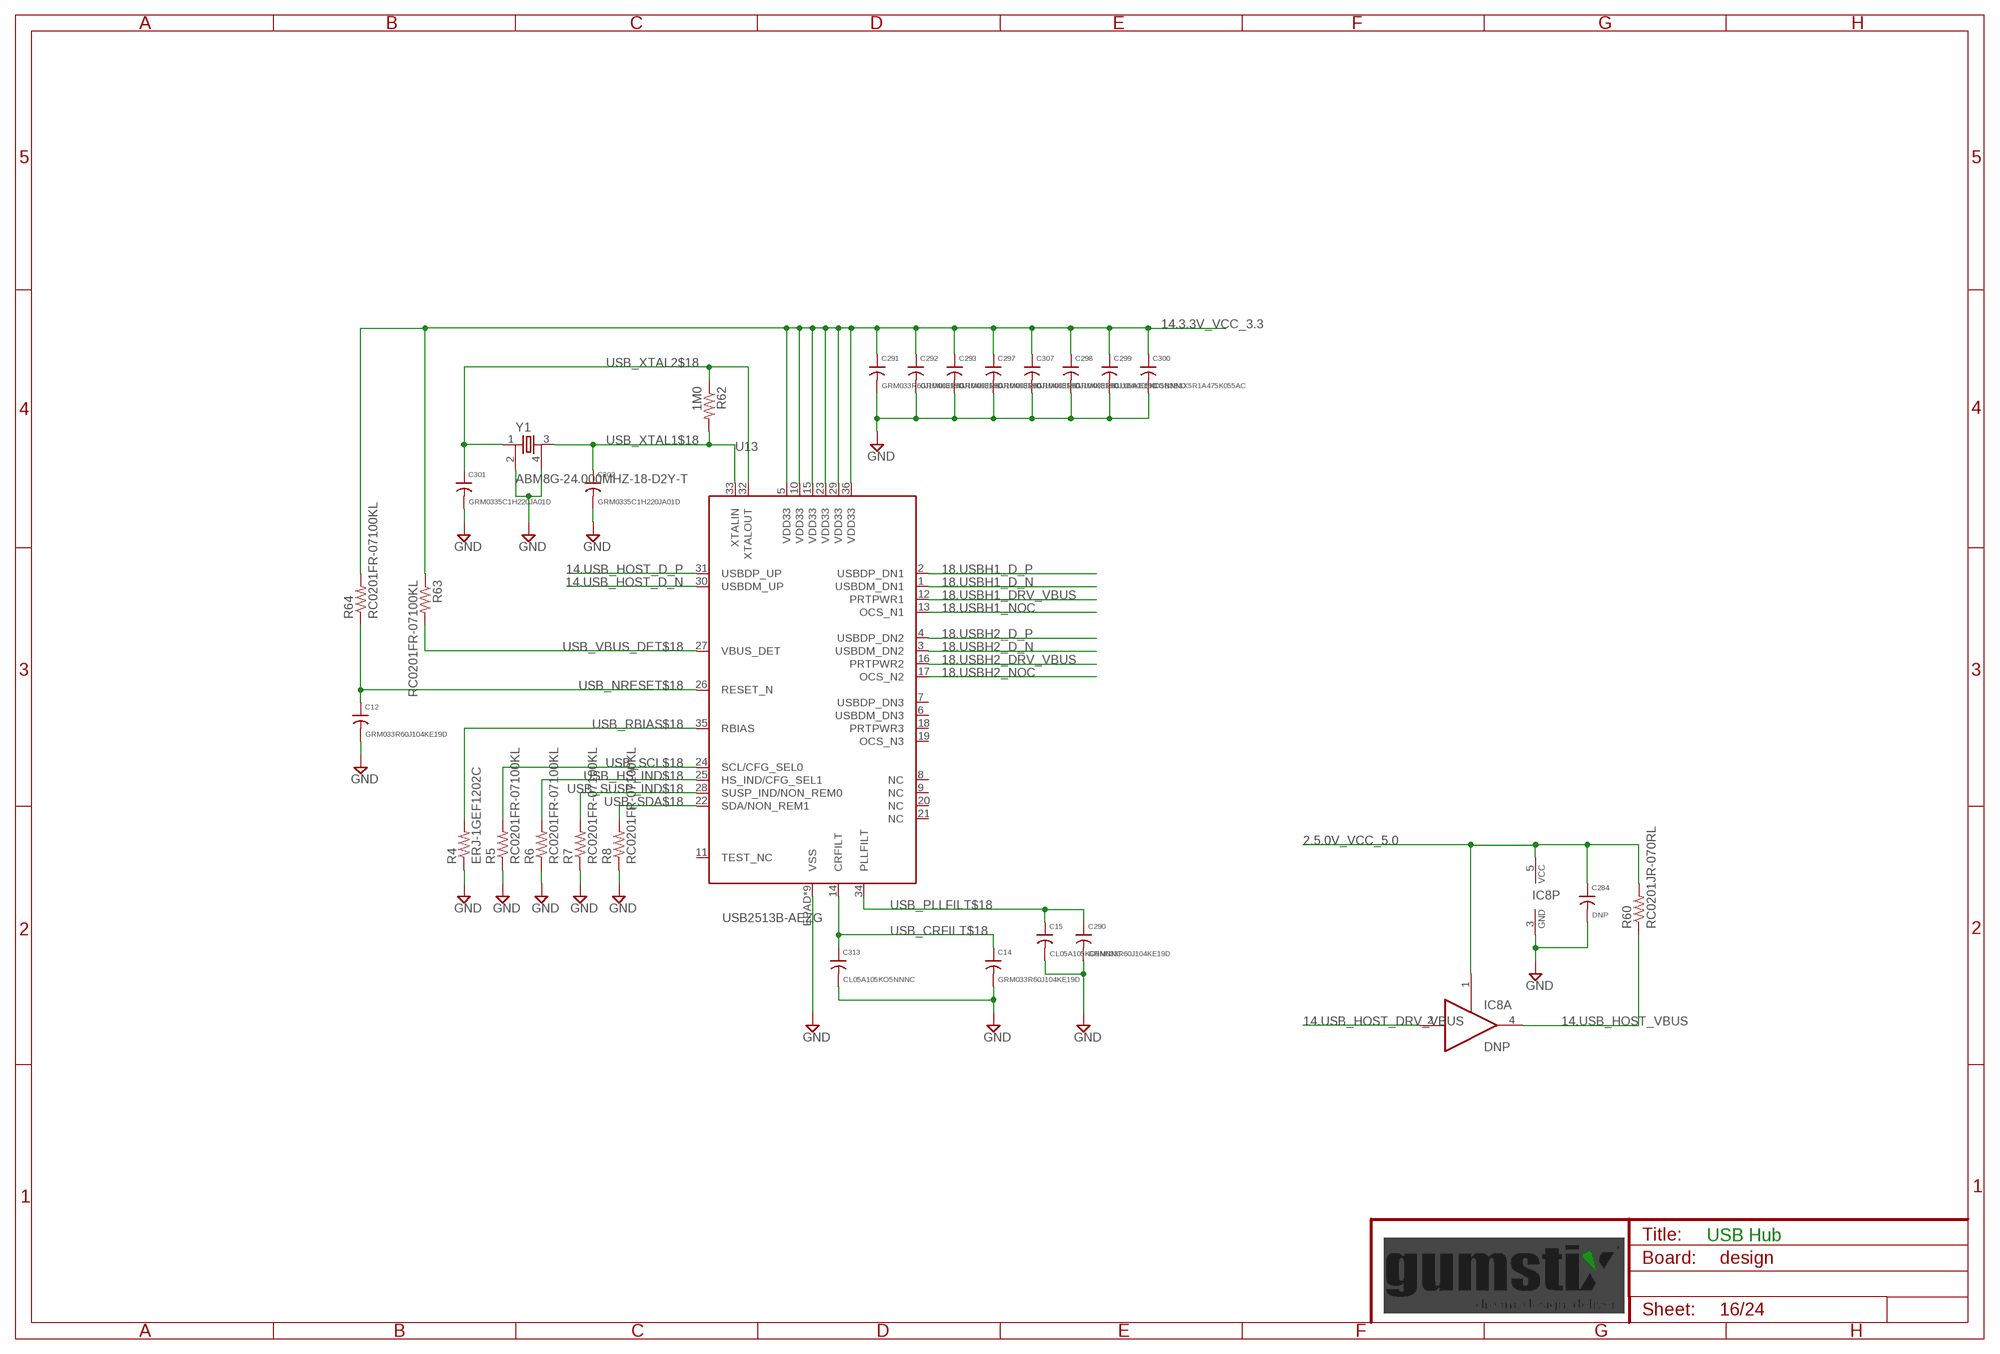
[diagram p15: schematic, sheet 16]

### Parts
C12  GRM033R60J104KE19D  [0201]
C14  GRM033R60J104KE19D  [0201]
C15  CL05A105KO5NNNC  [0402]
C284  DNP  C0402  [0402]
C290  GRM033R60J104KE19D  [0201]
C291  GRM033R60J104KE19D  [0201]
C292  GRM033R60J104KE19D  [0201]
C293  GRM033R60J104KE19D  [0201]
C297  GRM033R60J104KE19D  [0201]
C298  GRM033R60J104KE19D  [0201]
C299  CL05A105KO5NNNC  [0402]
C300  CGB3B1X5R1A475K055AC  [0603]
C301  GRM0335C1H220JA01D  [0201]
C302  GRM0335C1H220JA01D  [0201]
C307  GRM033R60J104KE19D  [0201]
C313  CL05A105KO5NNNC  [0402]
IC8  DNP  SN74LVC1G126DCKR  [SC70-5]
R4  ERJ-1GEF1202C  [0201]
R5  RC0201FR-07100KL  [0201]
R6  RC0201FR-07100KL  [0201]
R7  RC0201FR-07100KL  [0201]
R8  RC0201FR-07100KL  [0201]
R60  RC0201JR-070RL  [0201]
R62  1M0  R0201  [0201]
R63  RC0201FR-07100KL  [0201]
R64  RC0201FR-07100KL  [0201]
U13  USB2513B-AEZG  [QFN36-6X6MM]
Y1  ABM8G-24.000MHZ-18-D2Y-T  [CRYSTAL-3225]

### Nets
2.5.0V_VCC_5.0 [supply]: C284.1 IC8.1(A:OE) IC8.5(P:VCC) R60.2 ; also sheet 3,4,9,11,13,15
14.3.3V_VCC_3.3 [supply]: C291.1 C292.1 C293.1 C297.1 C298.1 C299.1 C300.1 C307.1 R63.1 R64.2 U13.5(VDD33) U13.10(VDD33) U13.15(VDD33) U13.23(VDD33) U13.29(VDD33) U13.36(VDD33) ; also sheet 11,13,17,20,21
14.USB_HOST_D_N [USB]: U13.30(USBDM_UP) ; also sheet 11
14.USB_HOST_D_P [USB]: U13.31(USBDP_UP) ; also sheet 11
14.USB_HOST_DRV_VBUS: IC8.2(A:I) ; also sheet 11
14.USB_HOST_VBUS: IC8.4(A:O) R60.1 ; also sheet 11
18.USBH1_D_N [USB]: U13.1(USBDM_DN1) ; also sheet 15
18.USBH1_D_P [USB]: U13.2(USBDP_DN1) ; also sheet 15
18.USBH1_DRV_VBUS: U13.12(PRTPWR1) ; also sheet 15
18.USBH1_NOC: U13.13(OCS_N1) ; also sheet 15
18.USBH2_D_N [USB]: U13.3(USBDM_DN2) ; also sheet 15
18.USBH2_D_P [USB]: U13.4(USBDP_DN2) ; also sheet 15
18.USBH2_DRV_VBUS: U13.16(PRTPWR2) ; also sheet 15
18.USBH2_NOC: U13.17(OCS_N2) ; also sheet 15
GND [supply]: C12.2 C14.2 C15.2 C284.2 C290.2 C291.2 C292.2 C293.2 C297.2 C298.2 C299.2 C300.2 C301.2 C302.2 C307.2 C313.2 IC8.3(P:GND) R4.1 R5.1 R6.1 R7.1 R8.1 U13.EPAD(VSS) U13.EXP1(VSS) U13.EXP2(VSS) U13.EXP3(VSS) U13.EXP4(VSS) U13.EXP5(VSS) U13.EXP6(VSS) U13.EXP7(VSS) U13.EXP8(VSS) Y1.2 Y1.4 ; also sheet 2,3,4,5,6,7,8,9,10,11,12,13,14,15,17,18,19,20,21,22,23,24
USB_CRFILT$18: C14.1 C313.1 U13.14(CRFILT)
USB_HS_IND$18: R6.2 U13.25(HS_IND/CFG_SEL1)
USB_NRESET$18: C12.1 R64.1 U13.26(RESET_N)
USB_PLLFILT$18: C15.1 C290.1 U13.34(PLLFILT)
USB_RBIAS$18: R4.2 U13.35(RBIAS)
USB_SCL$18: R5.2 U13.24(SCL/CFG_SEL0)
USB_SDA$18: R8.2 U13.22(SDA/NON_REM1)
USB_SUSP_IND$18: R7.2 U13.28(SUSP_IND/NON_REM0)
USB_VBUS_DET$18: R63.2 U13.27(VBUS_DET)
USB_XTAL1$18: C302.1 R62.2 U13.33(XTALIN) Y1.3
USB_XTAL2$18: C301.1 R62.1 U13.32(XTALOUT) Y1.1
Unconnected: U13.6(USBDM_DN3) U13.7(USBDP_DN3) U13.8(NC) U13.9(NC) U13.11(TEST_NC) U13.18(PRTPWR3) U13.19(OCS_N3) U13.20(NC) U13.21(NC)

### Notes on the sheet
- USB Hub

## Sheet 17 of 24
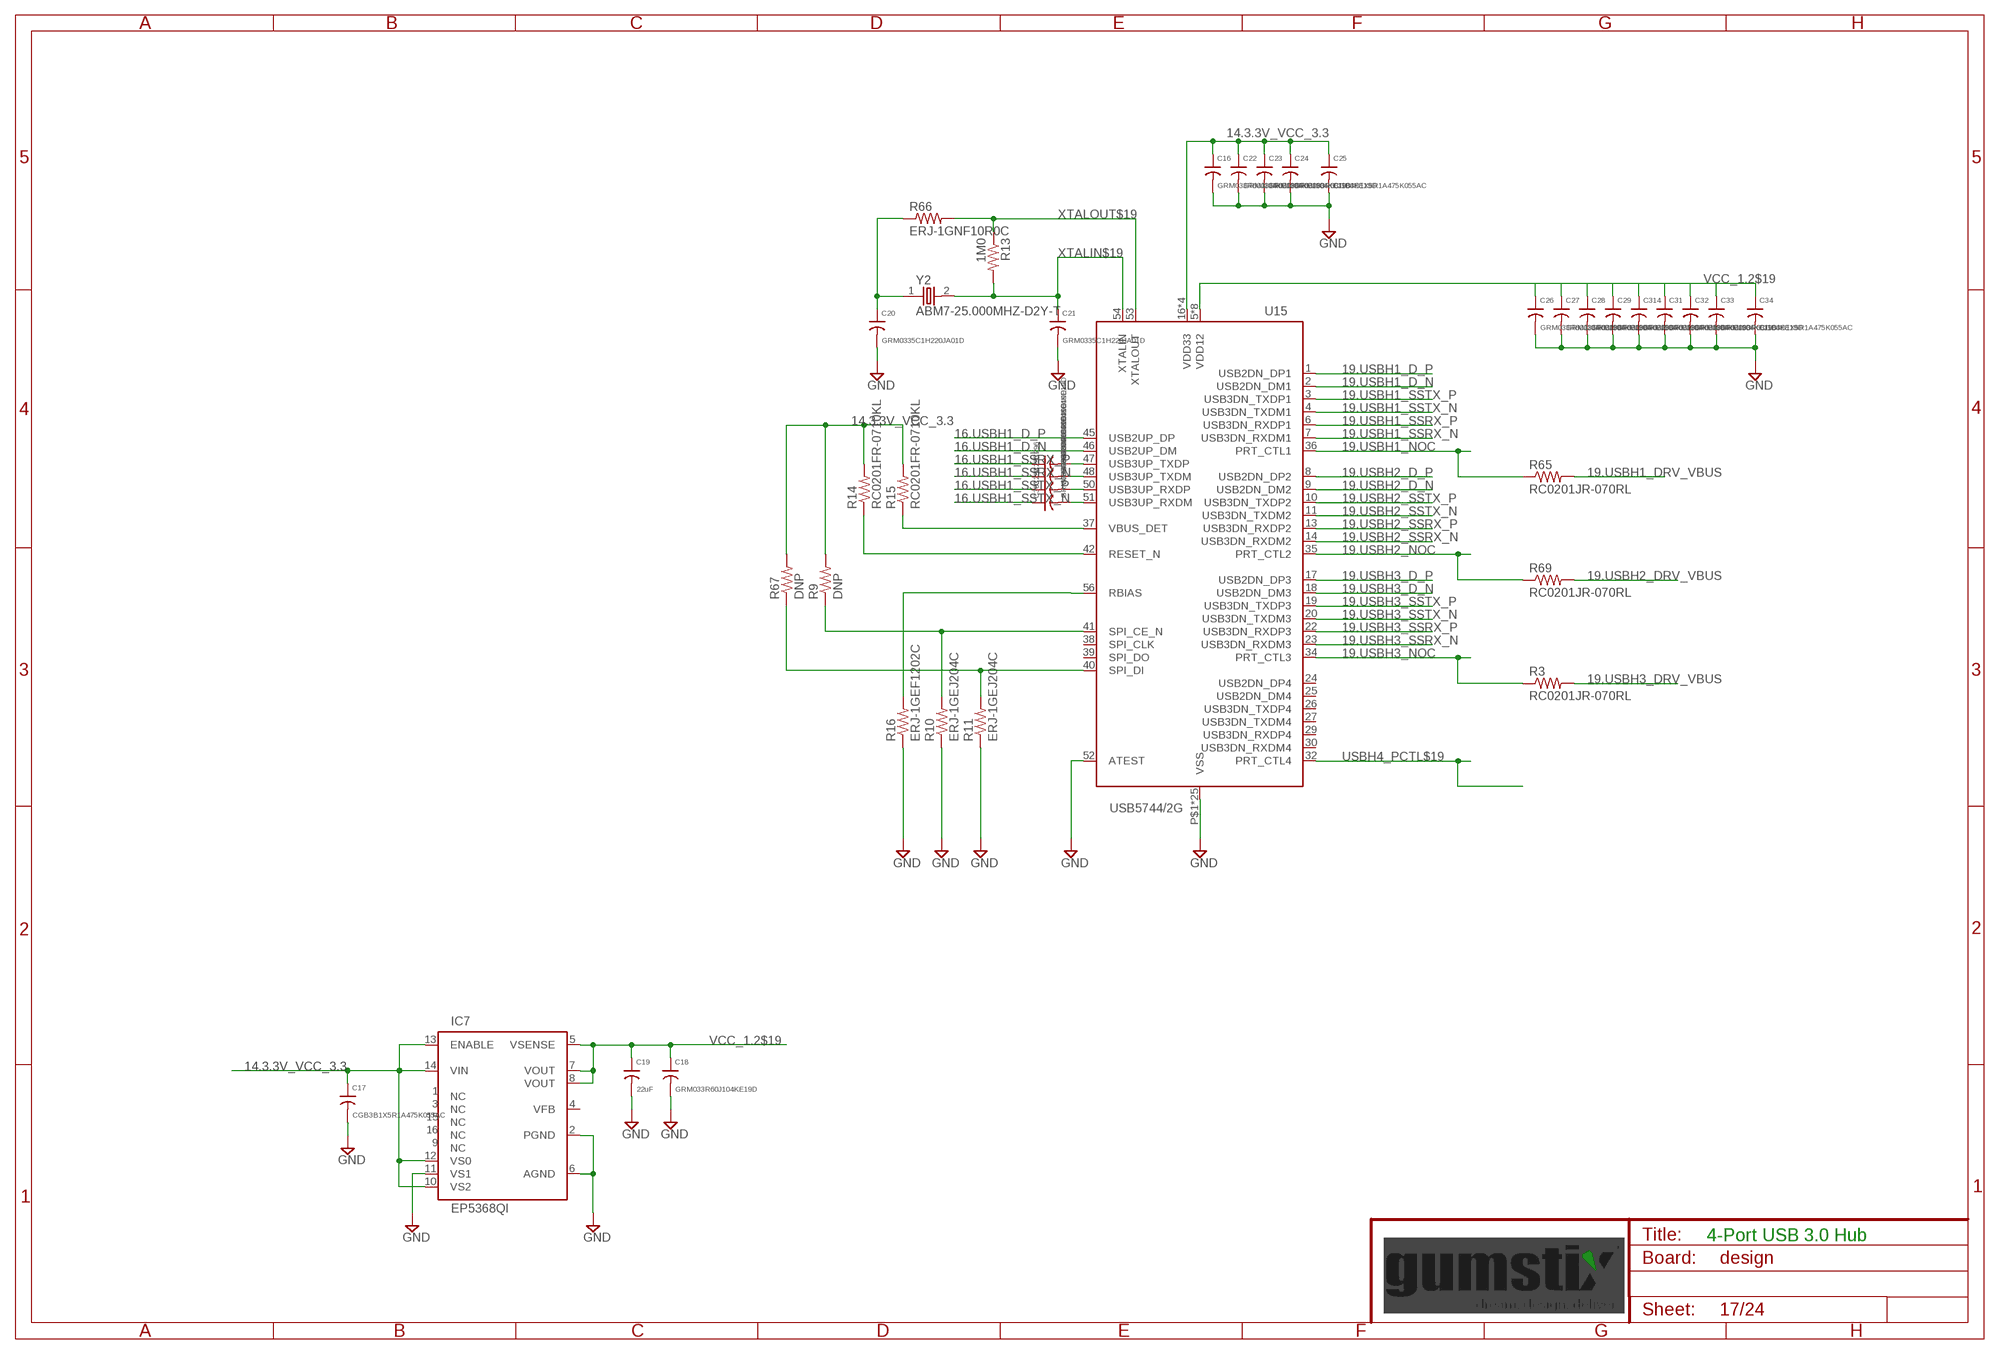
[diagram p16: schematic, sheet 17]

### Parts
C16  GRM033R60J104KE19D  [0201]
C17  CGB3B1X5R1A475K055AC  [0603]
C18  GRM033R60J104KE19D  [0201]
C19  22uF  C0805  [0805]
C20  GRM0335C1H220JA01D  [0201]
C21  GRM0335C1H220JA01D  [0201]
C22  GRM033R60J104KE19D  [0201]
C23  GRM033R60J104KE19D  [0201]
C24  GRM033R60J104KE19D  [0201]
C25  CGB3B1X5R1A475K055AC  [0603]
C26  GRM033R60J104KE19D  [0201]
C27  GRM033R60J104KE19D  [0201]
C28  GRM033R60J104KE19D  [0201]
C29  GRM033R60J104KE19D  [0201]
C31  GRM033R60J104KE19D  [0201]
C32  GRM033R60J104KE19D  [0201]
C33  GRM033R60J104KE19D  [0201]
C34  CGB3B1X5R1A475K055AC  [0603]
C294  GRM033R60J104KE19D  [0201]
C295  GRM033R60J104KE19D  [0201]
C296  GRM033R60J104KE19D  [0201]
C303  GRM033R60J104KE19D  [0201]
C314  GRM033R60J104KE19D  [0201]
IC7  EP5368QI  [EP-3X3MMQFN16]
R3  RC0201JR-070RL  [0201]
R9  DNP  R0201  [0201]
R10  ERJ-1GEJ204C  [0201]
R11  ERJ-1GEJ204C  [0201]
R13  1M0  R0201  [0201]
R14  RC0201FR-0710KL  [0201]
R15  RC0201FR-0710KL  [0201]
R16  ERJ-1GEF1202C  [0201]
R65  RC0201JR-070RL  [0201]
R66  ERJ-1GNF10R0C  [0201]
R67  DNP  R0201  [0201]
R69  RC0201JR-070RL  [0201]
U15  USB5744/2G  [VQFN56]
Y2  ABM7-25.000MHZ-D2Y-T  [CS10]

### Nets
14.3.3V_VCC_3.3 [supply]: C16.1 C17.1 C22.1 C23.1 C24.1 C25.1 IC7.10(VS2) IC7.12(VS0) IC7.13(ENABLE) IC7.14(VIN) R9.2 R14.2 R15.2 R67.2 U15.16(VDD33) U15.31(VDD33) U15.44(VDD33) U15.55(VDD33) ; also sheet 11,13,16,20,21
16.USBH1_D_N [USB]: U15.46(USB2UP_DM) ; also sheet 14
16.USBH1_D_P [USB]: U15.45(USB2UP_DP) ; also sheet 14
16.USBH1_SSRX_N [USB]: C295.1 ; also sheet 14
16.USBH1_SSRX_P [USB]: C296.1 ; also sheet 14
16.USBH1_SSTX_N [USB]: C303.1 ; also sheet 14
16.USBH1_SSTX_P [USB]: C294.1 ; also sheet 14
19.USBH1_D_N [USB]: U15.2(USB2DN_DM1) ; also sheet 18
19.USBH1_D_P [USB]: U15.1(USB2DN_DP1) ; also sheet 18
19.USBH1_DRV_VBUS: R65.2 ; also sheet 18
19.USBH1_NOC: R65.1 U15.36(PRT_CTL1) ; also sheet 18
19.USBH1_SSRX_N [USB]: U15.7(USB3DN_RXDM1) ; also sheet 18
19.USBH1_SSRX_P [USB]: U15.6(USB3DN_RXDP1) ; also sheet 18
19.USBH1_SSTX_N [USB]: U15.4(USB3DN_TXDM1) ; also sheet 18
19.USBH1_SSTX_P [USB]: U15.3(USB3DN_TXDP1) ; also sheet 18
19.USBH2_D_N [USB]: U15.9(USB2DN_DM2) ; also sheet 18
19.USBH2_D_P [USB]: U15.8(USB2DN_DP2) ; also sheet 18
19.USBH2_DRV_VBUS: R69.2 ; also sheet 18
19.USBH2_NOC: R69.1 U15.35(PRT_CTL2) ; also sheet 18
19.USBH2_SSRX_N [USB]: U15.14(USB3DN_RXDM2) ; also sheet 18
19.USBH2_SSRX_P [USB]: U15.13(USB3DN_RXDP2) ; also sheet 18
19.USBH2_SSTX_N [USB]: U15.11(USB3DN_TXDM2) ; also sheet 18
19.USBH2_SSTX_P [USB]: U15.10(USB3DN_TXDP2) ; also sheet 18
19.USBH3_D_N [USB]: U15.18(USB2DN_DM3) ; also sheet 21
19.USBH3_D_P [USB]: U15.17(USB2DN_DP3) ; also sheet 21
19.USBH3_DRV_VBUS: R3.2 ; also sheet 21
19.USBH3_NOC: R3.1 U15.34(PRT_CTL3) ; also sheet 21
19.USBH3_SSRX_N [USB]: U15.23(USB3DN_RXDM3) ; also sheet 21
19.USBH3_SSRX_P [USB]: U15.22(USB3DN_RXDP3) ; also sheet 21
19.USBH3_SSTX_N [USB]: U15.20(USB3DN_TXDM3) ; also sheet 21
19.USBH3_SSTX_P [USB]: U15.19(USB3DN_TXDP3) ; also sheet 21
CAP_RXD_N$19 [USB]: C295.2 U15.48(USB3UP_TXDM)
CAP_RXD_P$19 [USB]: C296.2 U15.47(USB3UP_TXDP)
CAP_TXD_N$19 [USB]: C303.2 U15.51(USB3UP_RXDM)
CAP_TXD_P$19 [USB]: C294.2 U15.50(USB3UP_RXDP)
CFG_BC_EN$19: R11.2 R67.1 U15.40(SPI_DI)
CFG_NON_REM$19: R9.1 R10.2 U15.41(SPI_CE_N)
GND [supply]: C16.2 C17.2 C18.2 C19.2 C20.2 C21.2 C22.2 C23.2 C24.2 C25.2 C26.2 C27.2 C28.2 C29.2 C31.2 C32.2 C33.2 C34.2 C314.2 IC7.2(PGND) IC7.6(AGND) IC7.11(VS1) R10.1 R11.1 R16.1 U15.52(ATEST) U15.P$1(VSS) U15.P$2(VSS) U15.P$3(VSS) U15.P$4(VSS) U15.P$5(VSS) U15.P$6(VSS) U15.P$7(VSS) U15.P$8(VSS) U15.P$9(VSS) U15.P$10(VSS) U15.P$11(VSS) U15.P$12(VSS) U15.P$13(VSS) U15.P$14(VSS) U15.P$15(VSS) U15.P$16(VSS) U15.P$17(VSS) U15.P$18(VSS) U15.P$19(VSS) U15.P$20(VSS) U15.P$21(VSS) U15.P$22(VSS) U15.P$23(VSS) U15.P$24(VSS) U15.P$25(VSS) ; also sheet 2,3,4,5,6,7,8,9,10,11,12,13,14,15,16,18,19,20,21,22,23,24
RBIAS$19: R16.2 U15.56(RBIAS)
RESET_N$19: R14.1 U15.42(RESET_N)
USBH4_PCTL$19: U15.32(PRT_CTL4)
VBUS_DET$19: R15.1 U15.37(VBUS_DET)
VCC_1.2$19 [supply]: C18.1 C19.1 C26.1 C27.1 C28.1 C29.1 C31.1 C32.1 C33.1 C34.1 C314.1 IC7.5(VSENSE) IC7.7(VOUT) IC7.8(VOUT) U15.5(VDD12) U15.12(VDD12) U15.15(VDD12) U15.21(VDD12) U15.28(VDD12) U15.33(VDD12) U15.43(VDD12) U15.49(VDD12)
XTALIN$19: C21.1 R13.2 U15.54(XTALIN) Y2.2
XTALOUT2$19: C20.1 R66.1 Y2.1
XTALOUT$19: R13.1 R66.2 U15.53(XTALOUT)
Unconnected: IC7.1(NC) IC7.3(NC) IC7.4(VFB) IC7.9(NC) IC7.15(NC) IC7.16(NC) U15.24(USB2DN_DP4) U15.25(USB2DN_DM4) U15.26(USB3DN_TXDP4) U15.27(USB3DN_TXDM4) U15.29(USB3DN_RXDP4) U15.30(USB3DN_RXDM4) U15.38(SPI_CLK) U15.39(SPI_DO)

### Notes on the sheet
- 4-Port USB 3.0 Hub

## Sheet 18 of 24
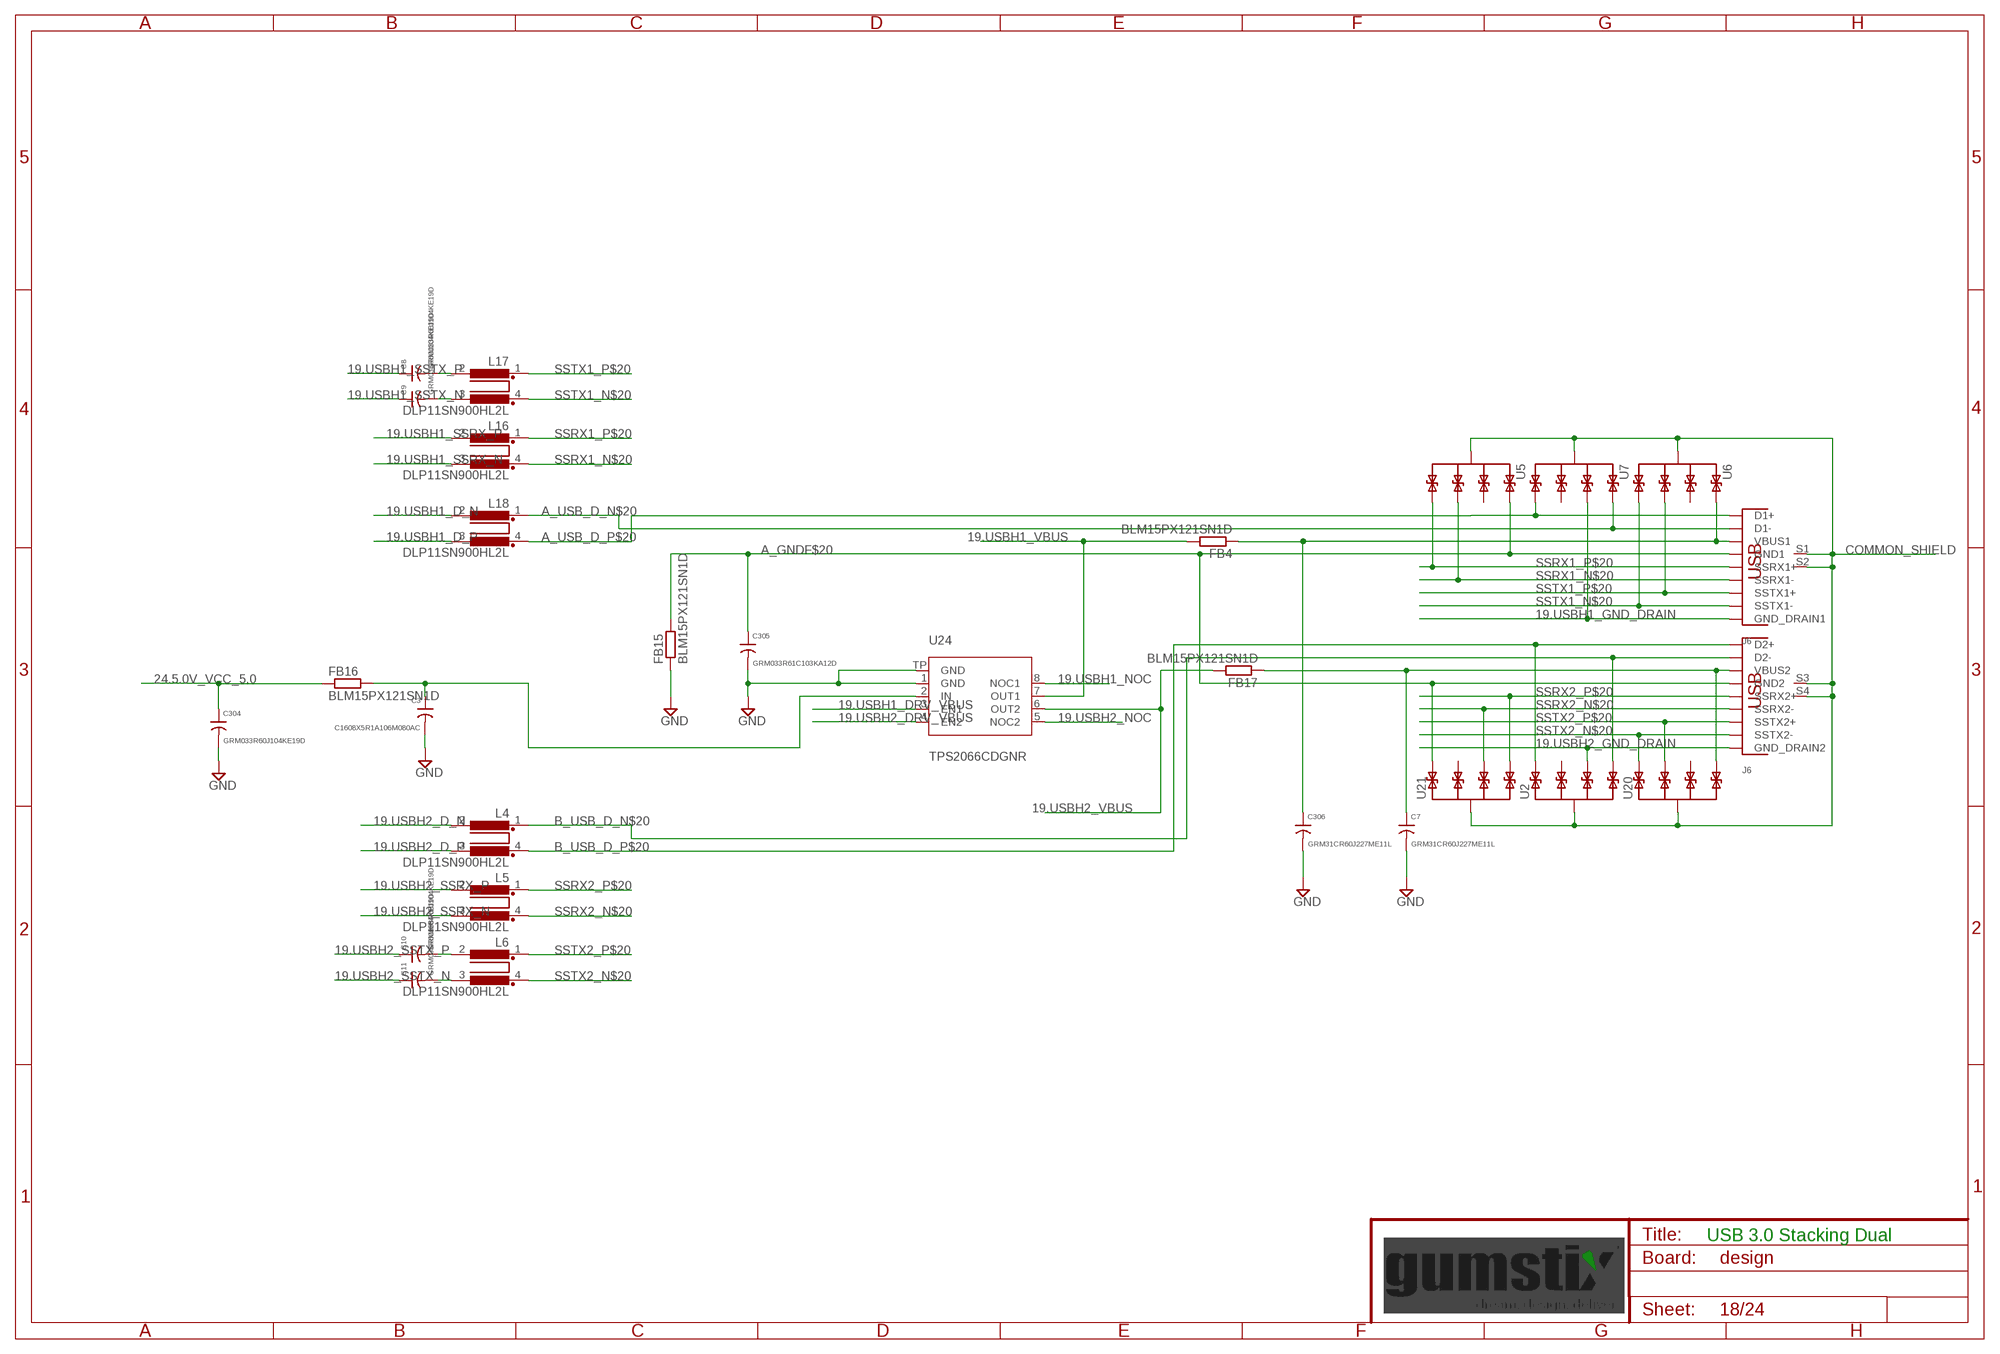
[diagram p17: schematic, sheet 18]

### Parts
C3  C1608X5R1A106M080AC  [0603]
C7  GRM31CR60J227ME11L  [1206]
C8  GRM033R60J104KE19D  [0201]
C9  GRM033R60J104KE19D  [0201]
C10  GRM033R60J104KE19D  [0201]
C11  GRM033R60J104KE19D  [0201]
C304  GRM033R60J104KE19D  [0201]
C305  GRM033R61C103KA12D  [0201]
C306  GRM31CR60J227ME11L  [1206]
FB4  BLM15PX121SN1D  [0402]
FB15  BLM15PX121SN1D  [0402]
FB16  BLM15PX121SN1D  [0402]
FB17  BLM15PX121SN1D  [0402]
J6  GSB311231HR  [USB3-A-H-DUAL]
L4  DLP11SN900HL2L  [0504-DLP11S]
L5  DLP11SN900HL2L  [0504-DLP11S]
L6  DLP11SN900HL2L  [0504-DLP11S]
L16  DLP11SN900HL2L  [0504-DLP11S]
L17  DLP11SN900HL2L  [0504-DLP11S]
L18  DLP11SN900HL2L  [0504-DLP11S]
U2  TPD4E02B04DQAR  [UFDFN-10]
U5  TPD4E02B04DQAR  [UFDFN-10]
U6  TPD4E02B04DQAR  [UFDFN-10]
U7  TPD4E02B04DQAR  [UFDFN-10]
U20  TPD4E02B04DQAR  [UFDFN-10]
U21  TPD4E02B04DQAR  [UFDFN-10]
U24  TPS2066CDGNR  [MSOP8-PAD]

### Nets
19.USBH1_D_N [USB]: L18.2 ; also sheet 17
19.USBH1_D_P [USB]: L18.3 ; also sheet 17
19.USBH1_DRV_VBUS: U24.3(EN1) ; also sheet 17
19.USBH1_GND_DRAIN [supply]: J6.7(GND_DRAIN1) U7.2 U7.9(P2)
19.USBH1_NOC: U24.8(NOC1) ; also sheet 17
19.USBH1_SSRX_N [USB]: L16.3 ; also sheet 17
19.USBH1_SSRX_P [USB]: L16.2 ; also sheet 17
19.USBH1_SSTX_N [USB]: C9.1 ; also sheet 17
19.USBH1_SSTX_P [USB]: C8.1 ; also sheet 17
19.USBH1_VBUS [supply]: FB4.2 U24.7(OUT1) ; also sheet 17
19.USBH2_D_N [USB]: L4.2 ; also sheet 17
19.USBH2_D_P [USB]: L4.3 ; also sheet 17
19.USBH2_DRV_VBUS: U24.4(EN2) ; also sheet 17
19.USBH2_GND_DRAIN [supply]: J6.16(GND_DRAIN2) U2.4(P3) U2.7(P3)
19.USBH2_NOC: U24.5(NOC2) ; also sheet 17
19.USBH2_SSRX_N [USB]: L5.3 ; also sheet 17
19.USBH2_SSRX_P [USB]: L5.2 ; also sheet 17
19.USBH2_SSTX_N [USB]: C11.1 ; also sheet 17
19.USBH2_SSTX_P [USB]: C10.1 ; also sheet 17
19.USBH2_VBUS [supply]: FB17.2 U24.6(OUT2) ; also sheet 17
24.5.0V_VCC_5.0 [supply]: C304.1 FB16.1 ; also sheet 20,21,22
A_GNDF$20 [supply]: C305.1 FB15.2 J6.4(GND1) J6.13(GND2) U5.1 U5.10(P1) U21.1 U21.10(P1)
A_USB_D_N$20 [USB]: J6.2(D1-) L18.1 U7.1 U7.10(P1)
A_USB_D_P$20 [USB]: J6.3(D1+) L18.4 U7.5(P4) U7.6(P4)
A_VBUS_$20 [supply]: C306.1 FB4.1 J6.1(VBUS1) U6.1 U6.10(P1)
B_USB_D_N$20 [USB]: J6.11(D2-) L4.1 U2.5(P4) U2.6(P4)
B_USB_D_P$20 [USB]: J6.12(D2+) L4.4 U2.1 U2.10(P1)
B_VBUS_$20 [supply]: C7.1 FB17.1 J6.10(VBUS2) U20.5(P4) U20.6(P4)
CAP_A_TX_N$20 [USB]: C9.2 L17.3
CAP_A_TX_P$20 [USB]: C8.2 L17.2
CAP_B_TX_N$20 [USB]: C11.2 L6.3
CAP_B_TX_P$20 [USB]: C10.2 L6.2
COMMON_SHIELD [supply]: J6.S1(SH1) J6.S2(SH2) J6.S3(SH3) J6.S4(SH4) U2.3(SHIELD) U2.8(SHIELD) U5.3(SHIELD) U5.8(SHIELD) U6.3(SHIELD) U6.8(SHIELD) U7.3(SHIELD) U7.8(SHIELD) U20.3(SHIELD) U20.8(SHIELD) U21.3(SHIELD) U21.8(SHIELD) ; also sheet 5,8,9,15,20,21
GND [supply]: C3.2 C7.2 C304.2 C305.2 C306.2 FB15.1 U24.1(GND) U24.TP(GND) ; also sheet 2,3,4,5,6,7,8,9,10,11,12,13,14,15,16,17,19,20,21,22,23,24
SSRX1_N$20 [USB]: J6.5(SSRX1-) L16.4 U5.4(P3) U5.7(P3)
SSRX1_P$20 [USB]: J6.6(SSRX1+) L16.1 U5.5(P4) U5.6(P4)
SSRX2_N$20 [USB]: J6.14(SSRX2-) L5.4 U21.4(P3) U21.7(P3)
SSRX2_P$20 [USB]: J6.15(SSRX2+) L5.1 U21.5(P4) U21.6(P4)
SSTX1_N$20 [USB]: J6.8(SSTX1-) L17.4 U6.5(P4) U6.6(P4)
SSTX1_P$20 [USB]: J6.9(SSTX1+) L17.1 U6.4(P3) U6.7(P3)
SSTX2_N$20 [USB]: J6.17(SSTX2-) L6.4 U20.1 U20.10(P1)
SSTX2_P$20 [USB]: J6.18(SSTX2+) L6.1 U20.2 U20.9(P2)
VBUSF$20 [supply]: C3.1 FB16.2 U24.2(IN)
Unconnected: U2.2 U2.9(P2) U5.2 U5.9(P2) U6.2 U6.9(P2) U7.4(P3) U7.7(P3) U20.4(P3) U20.7(P3) U21.2 U21.9(P2)

### Notes on the sheet
- USB 3.0 Stacking Dual

## Sheet 19 of 24
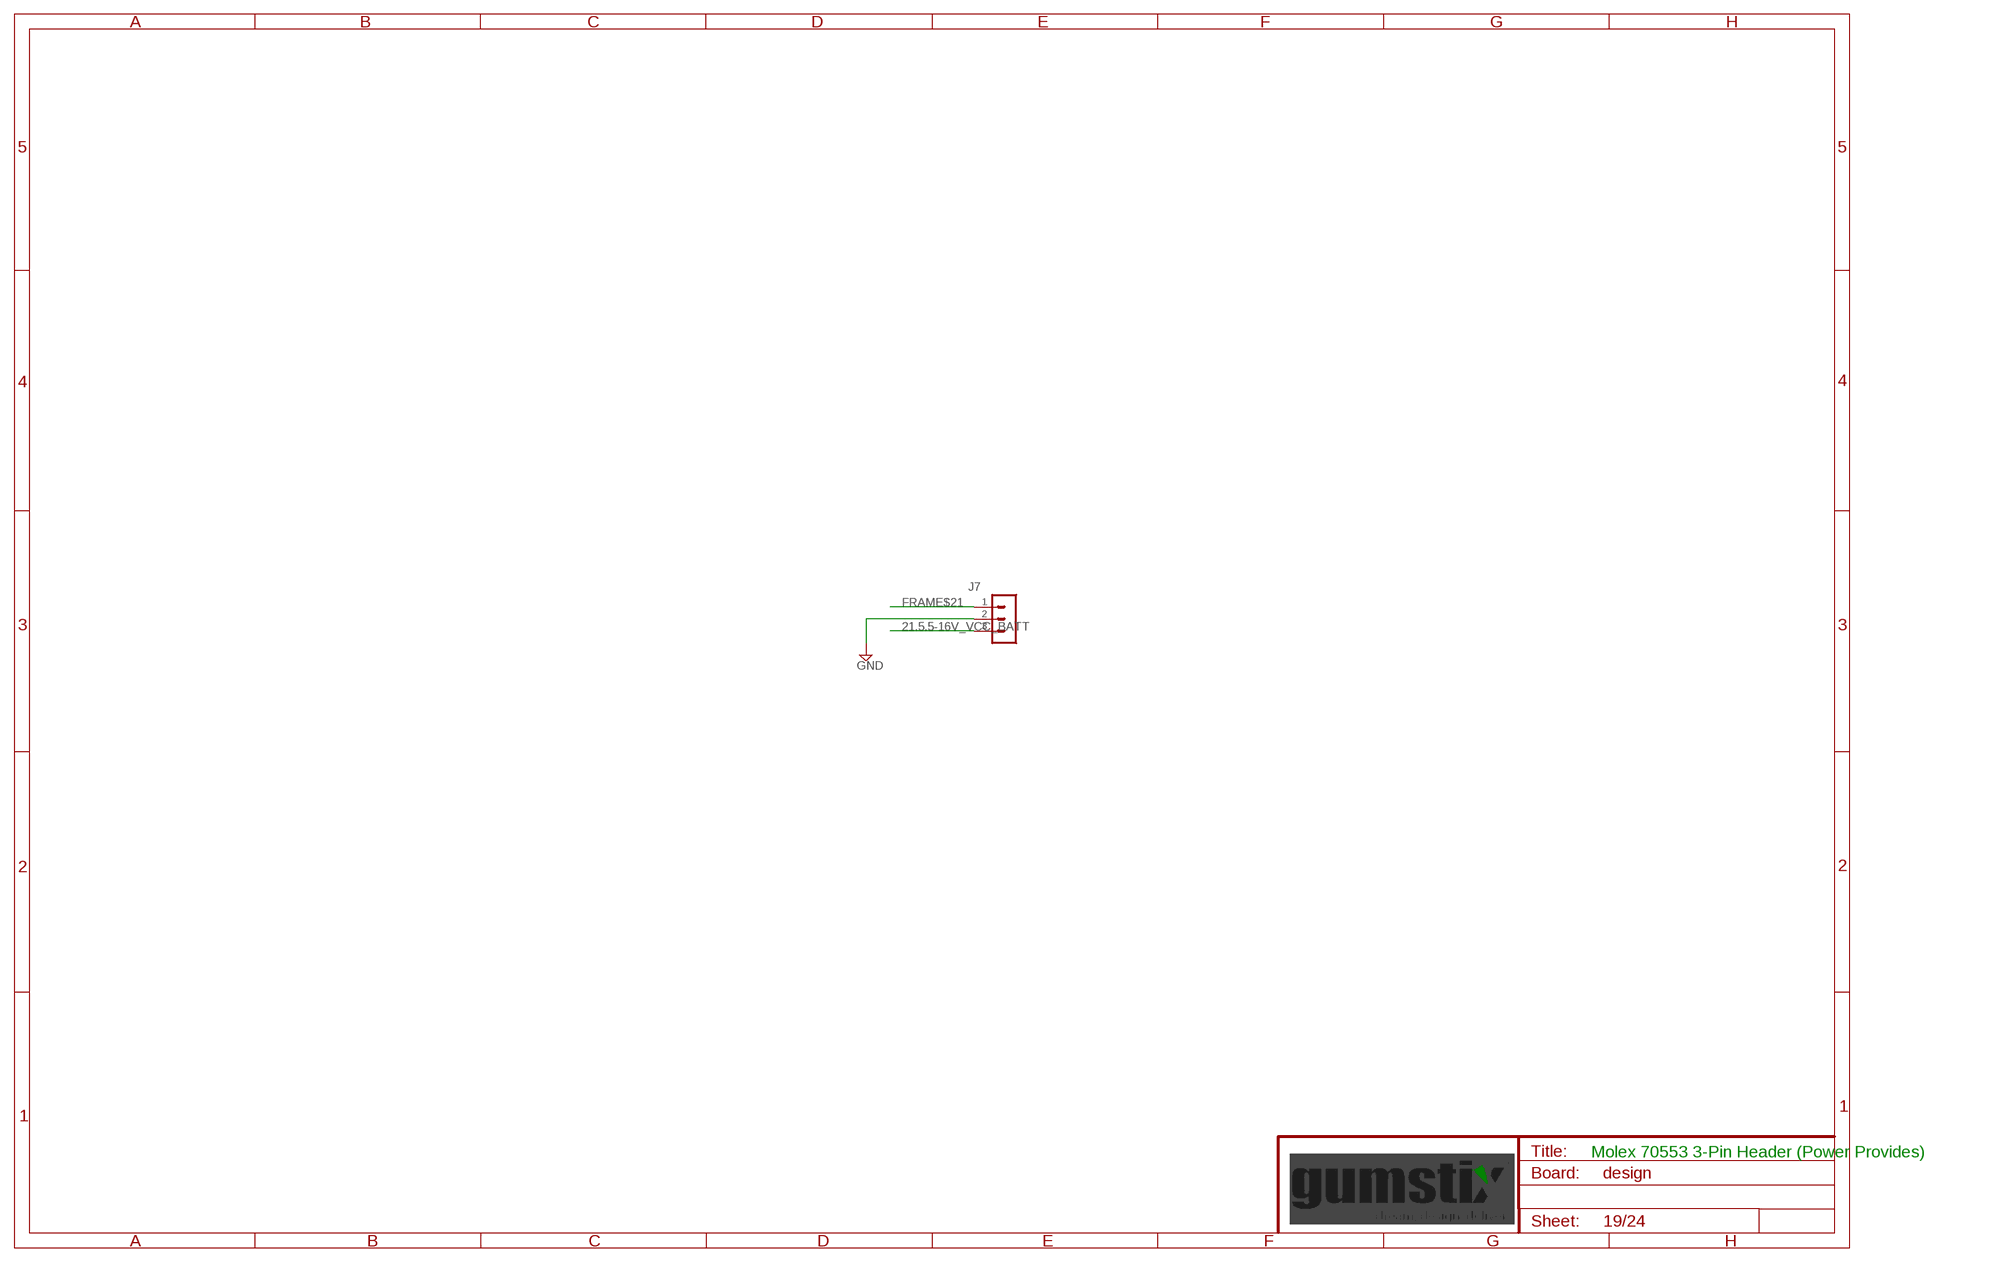
[diagram p18: schematic, sheet 19]

### Parts
J7  70553-0002  [1X03_90_TH_SHROUD]

### Nets
21.5.5-16V_VCC_BATT [supply]: J7.3 ; also sheet 3,22
FRAME$21 [supply]: J7.1
GND [supply]: J7.2 ; also sheet 2,3,4,5,6,7,8,9,10,11,12,13,14,15,16,17,18,20,21,22,23,24

### Notes on the sheet
- Molex 70553 3-Pin Header (Power Provides)

## Sheet 20 of 24
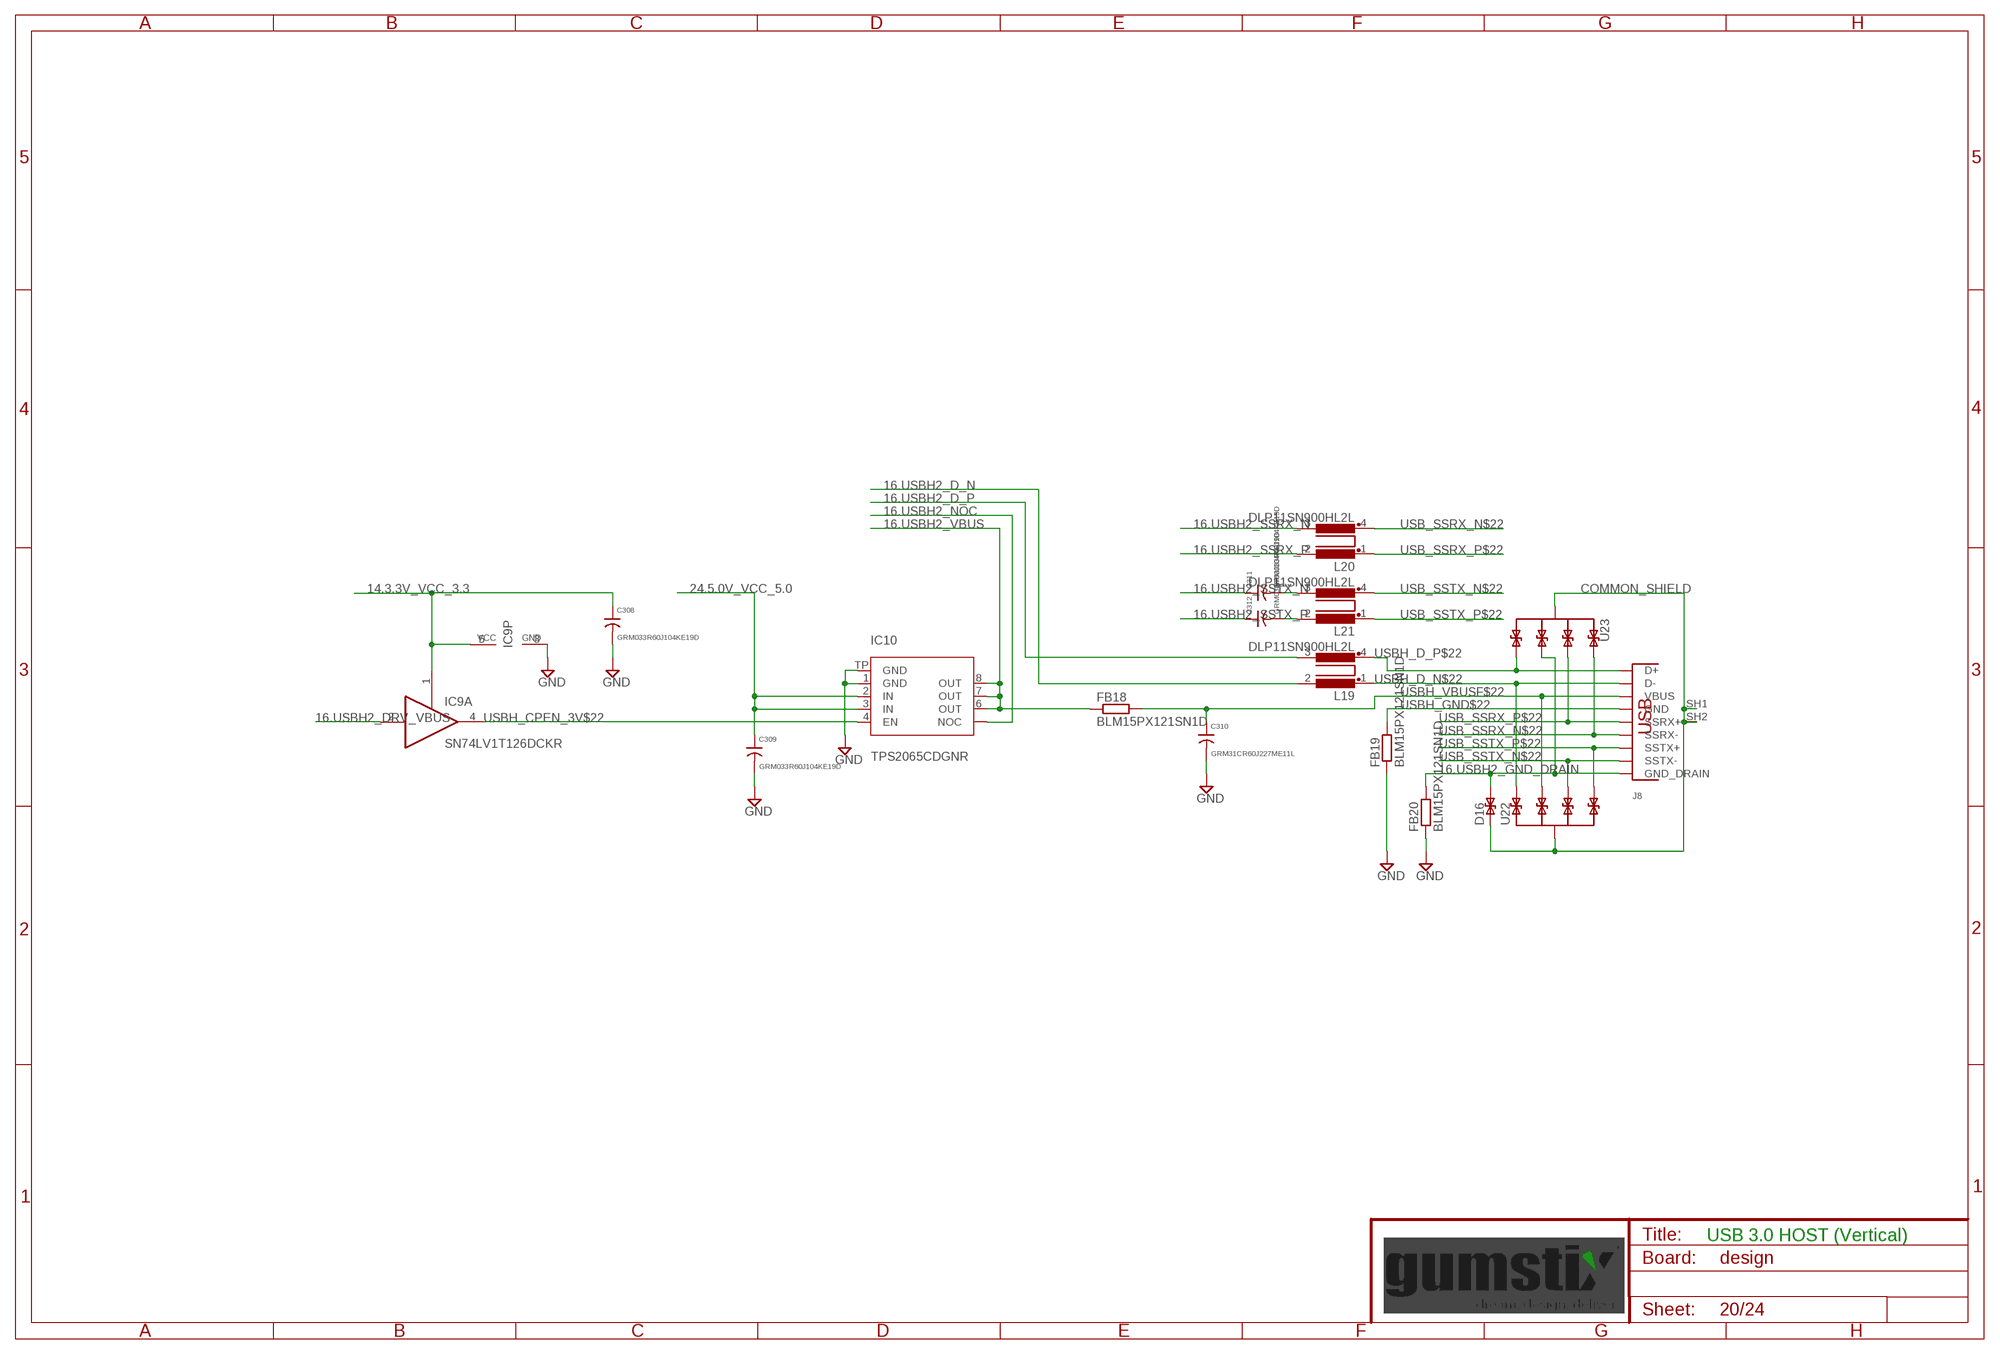
[diagram p19: schematic, sheet 20]

### Parts
C308  GRM033R60J104KE19D  [0201]
C309  GRM033R60J104KE19D  [0201]
C310  GRM31CR60J227ME11L  [1206]
C311  GRM033R60J104KE19D  [0201]
C312  GRM033R60J104KE19D  [0201]
D16  PS04LTVA1  [D0402]
FB18  BLM15PX121SN1D  [0402]
FB19  BLM15PX121SN1D  [0402]
FB20  BLM15PX121SN1D  [0402]
IC9  SN74LV1T126DCKR  SN74LV1T126DCKRAHC  [SC70-5]
IC10  TPS2065CDGNR  [MSOP8-PAD]
J8  10117836-002LF  [USB3-A-H-VERT]
L19  DLP11SN900HL2L  [0504-DLP11S]
L20  DLP11SN900HL2L  [0504-DLP11S]
L21  DLP11SN900HL2L  [0504-DLP11S]
U22  TPD4E02B04DQAR  [UFDFN-10]
U23  TPD4E02B04DQAR  [UFDFN-10]

### Nets
14.3.3V_VCC_3.3 [supply]: C308.1 IC9.1(A:OE) IC9.5(P:VCC) ; also sheet 11,13,16,17,21
16.USBH2_D_N [USB]: L19.2 ; also sheet 14
16.USBH2_D_P [USB]: L19.3 ; also sheet 14
16.USBH2_DRV_VBUS: IC9.2(A:I) ; also sheet 14
16.USBH2_GND_DRAIN: D16.P2 FB20.2 J8.DRAIN(GND_DRAIN) U23.4(P3) U23.7(P3) ; also sheet 14
16.USBH2_NOC: IC10.5(NOC) ; also sheet 14
16.USBH2_SSRX_N [USB]: L20.3 ; also sheet 14
16.USBH2_SSRX_P [USB]: L20.2 ; also sheet 14
16.USBH2_SSTX_N [USB]: C311.1 ; also sheet 14
16.USBH2_SSTX_P [USB]: C312.1 ; also sheet 14
16.USBH2_VBUS: FB18.1 IC10.6(OUT) IC10.7(OUT) IC10.8(OUT) ; also sheet 14
24.5.0V_VCC_5.0 [supply]: C309.1 IC10.2(IN) IC10.3(IN) ; also sheet 18,21,22
COMMON_SHIELD [supply]: D16.P1 J8.SH1 J8.SH2 U22.3(SHIELD) U22.8(SHIELD) U23.3(SHIELD) U23.8(SHIELD) ; also sheet 5,8,9,15,18,21
GND [supply]: C308.2 C309.2 C310.2 FB19.1 FB20.1 IC9.3(P:GND) IC10.1(GND) IC10.TP(GND) ; also sheet 2,3,4,5,6,7,8,9,10,11,12,13,14,15,16,17,18,19,21,22,23,24
USB_CAP_SSTX_N$22 [USB]: C311.2 L21.3
USB_CAP_SSTX_P$22 [USB]: C312.2 L21.2
USB_SSRX_N$22 [USB]: J8.SSRX- L20.4 U23.1 U23.10(P1)
USB_SSRX_P$22 [USB]: J8.SSRX+ L20.1 U23.2 U23.9(P2)
USB_SSTX_N$22 [USB]: J8.SSTX- L21.4 U22.4(P3) U22.7(P3)
USB_SSTX_P$22 [USB]: J8.SSTX+ L21.1 U22.5(P4) U22.6(P4)
USBH_CPEN_3V$22: IC9.4(A:O) IC10.4(EN)
USBH_D_N$22 [USB]: J8.D- L19.1 U22.1 U22.10(P1)
USBH_D_P$22 [USB]: J8.D+ L19.4 U23.5(P4) U23.6(P4)
USBH_GND$22 [supply]: FB19.2 J8.GND
USBH_VBUSF$22 [supply]: C310.1 FB18.2 J8.VBUS U22.2 U22.9(P2)

### Notes on the sheet
- USB 3.0 HOST (Vertical)

## Sheet 21 of 24
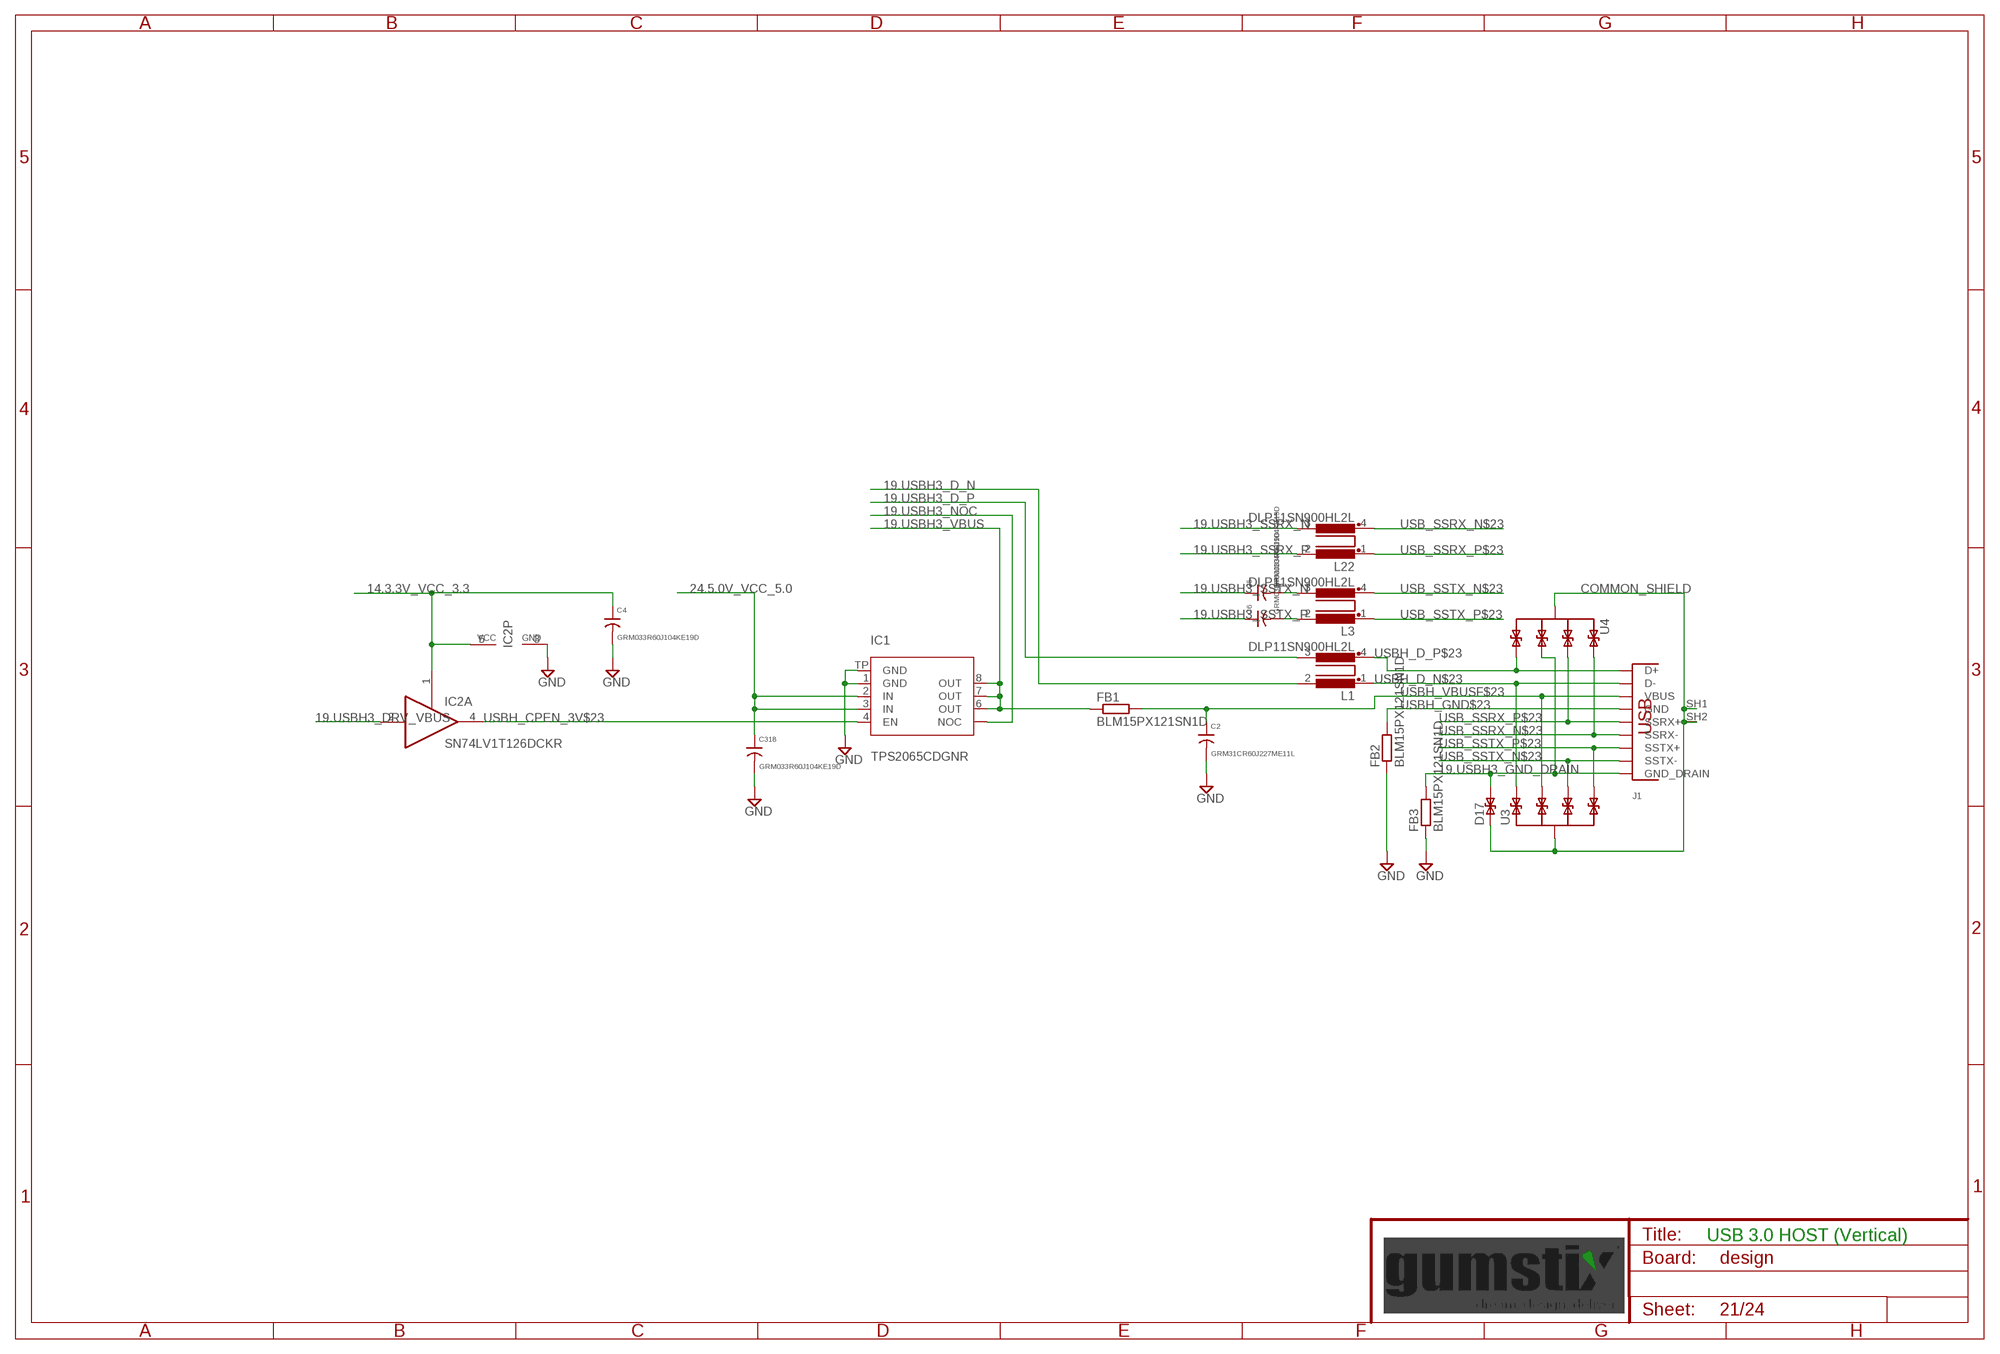
[diagram p20: schematic, sheet 21]

### Parts
C2  GRM31CR60J227ME11L  [1206]
C4  GRM033R60J104KE19D  [0201]
C5  GRM033R60J104KE19D  [0201]
C6  GRM033R60J104KE19D  [0201]
C318  GRM033R60J104KE19D  [0201]
D17  PS04LTVA1  [D0402]
FB1  BLM15PX121SN1D  [0402]
FB2  BLM15PX121SN1D  [0402]
FB3  BLM15PX121SN1D  [0402]
IC1  TPS2065CDGNR  [MSOP8-PAD]
IC2  SN74LV1T126DCKR  SN74LV1T126DCKRAHC  [SC70-5]
J1  10117836-002LF  [USB3-A-H-VERT]
L1  DLP11SN900HL2L  [0504-DLP11S]
L3  DLP11SN900HL2L  [0504-DLP11S]
L22  DLP11SN900HL2L  [0504-DLP11S]
U3  TPD4E02B04DQAR  [UFDFN-10]
U4  TPD4E02B04DQAR  [UFDFN-10]

### Nets
14.3.3V_VCC_3.3 [supply]: C4.1 IC2.1(A:OE) IC2.5(P:VCC) ; also sheet 11,13,16,17,20
19.USBH3_D_N [USB]: L1.2 ; also sheet 17
19.USBH3_D_P [USB]: L1.3 ; also sheet 17
19.USBH3_DRV_VBUS: IC2.2(A:I) ; also sheet 17
19.USBH3_GND_DRAIN [supply]: D17.P2 FB3.2 J1.DRAIN(GND_DRAIN) U4.4(P3) U4.7(P3)
19.USBH3_NOC: IC1.5(NOC) ; also sheet 17
19.USBH3_SSRX_N [USB]: L22.3 ; also sheet 17
19.USBH3_SSRX_P [USB]: L22.2 ; also sheet 17
19.USBH3_SSTX_N [USB]: C5.1 ; also sheet 17
19.USBH3_SSTX_P [USB]: C6.1 ; also sheet 17
19.USBH3_VBUS [supply]: FB1.1 IC1.6(OUT) IC1.7(OUT) IC1.8(OUT) ; also sheet 17
24.5.0V_VCC_5.0 [supply]: C318.1 IC1.2(IN) IC1.3(IN) ; also sheet 18,20,22
COMMON_SHIELD [supply]: D17.P1 J1.SH1 J1.SH2 U3.3(SHIELD) U3.8(SHIELD) U4.3(SHIELD) U4.8(SHIELD) ; also sheet 5,8,9,15,18,20
GND [supply]: C2.2 C4.2 C318.2 FB2.1 FB3.1 IC1.1(GND) IC1.TP(GND) IC2.3(P:GND) ; also sheet 2,3,4,5,6,7,8,9,10,11,12,13,14,15,16,17,18,19,20,22,23,24
USB_CAP_SSTX_N$23 [USB]: C5.2 L3.3
USB_CAP_SSTX_P$23 [USB]: C6.2 L3.2
USB_SSRX_N$23 [USB]: J1.SSRX- L22.4 U4.1 U4.10(P1)
USB_SSRX_P$23 [USB]: J1.SSRX+ L22.1 U4.2 U4.9(P2)
USB_SSTX_N$23 [USB]: J1.SSTX- L3.4 U3.4(P3) U3.7(P3)
USB_SSTX_P$23 [USB]: J1.SSTX+ L3.1 U3.5(P4) U3.6(P4)
USBH_CPEN_3V$23: IC1.4(EN) IC2.4(A:O)
USBH_D_N$23 [USB]: J1.D- L1.1 U3.1 U3.10(P1)
USBH_D_P$23 [USB]: J1.D+ L1.4 U4.5(P4) U4.6(P4)
USBH_GND$23 [supply]: FB2.2 J1.GND
USBH_VBUSF$23 [supply]: C2.1 FB1.2 J1.VBUS U3.2 U3.9(P2)

### Notes on the sheet
- USB 3.0 HOST (Vertical)

## Sheet 22 of 24
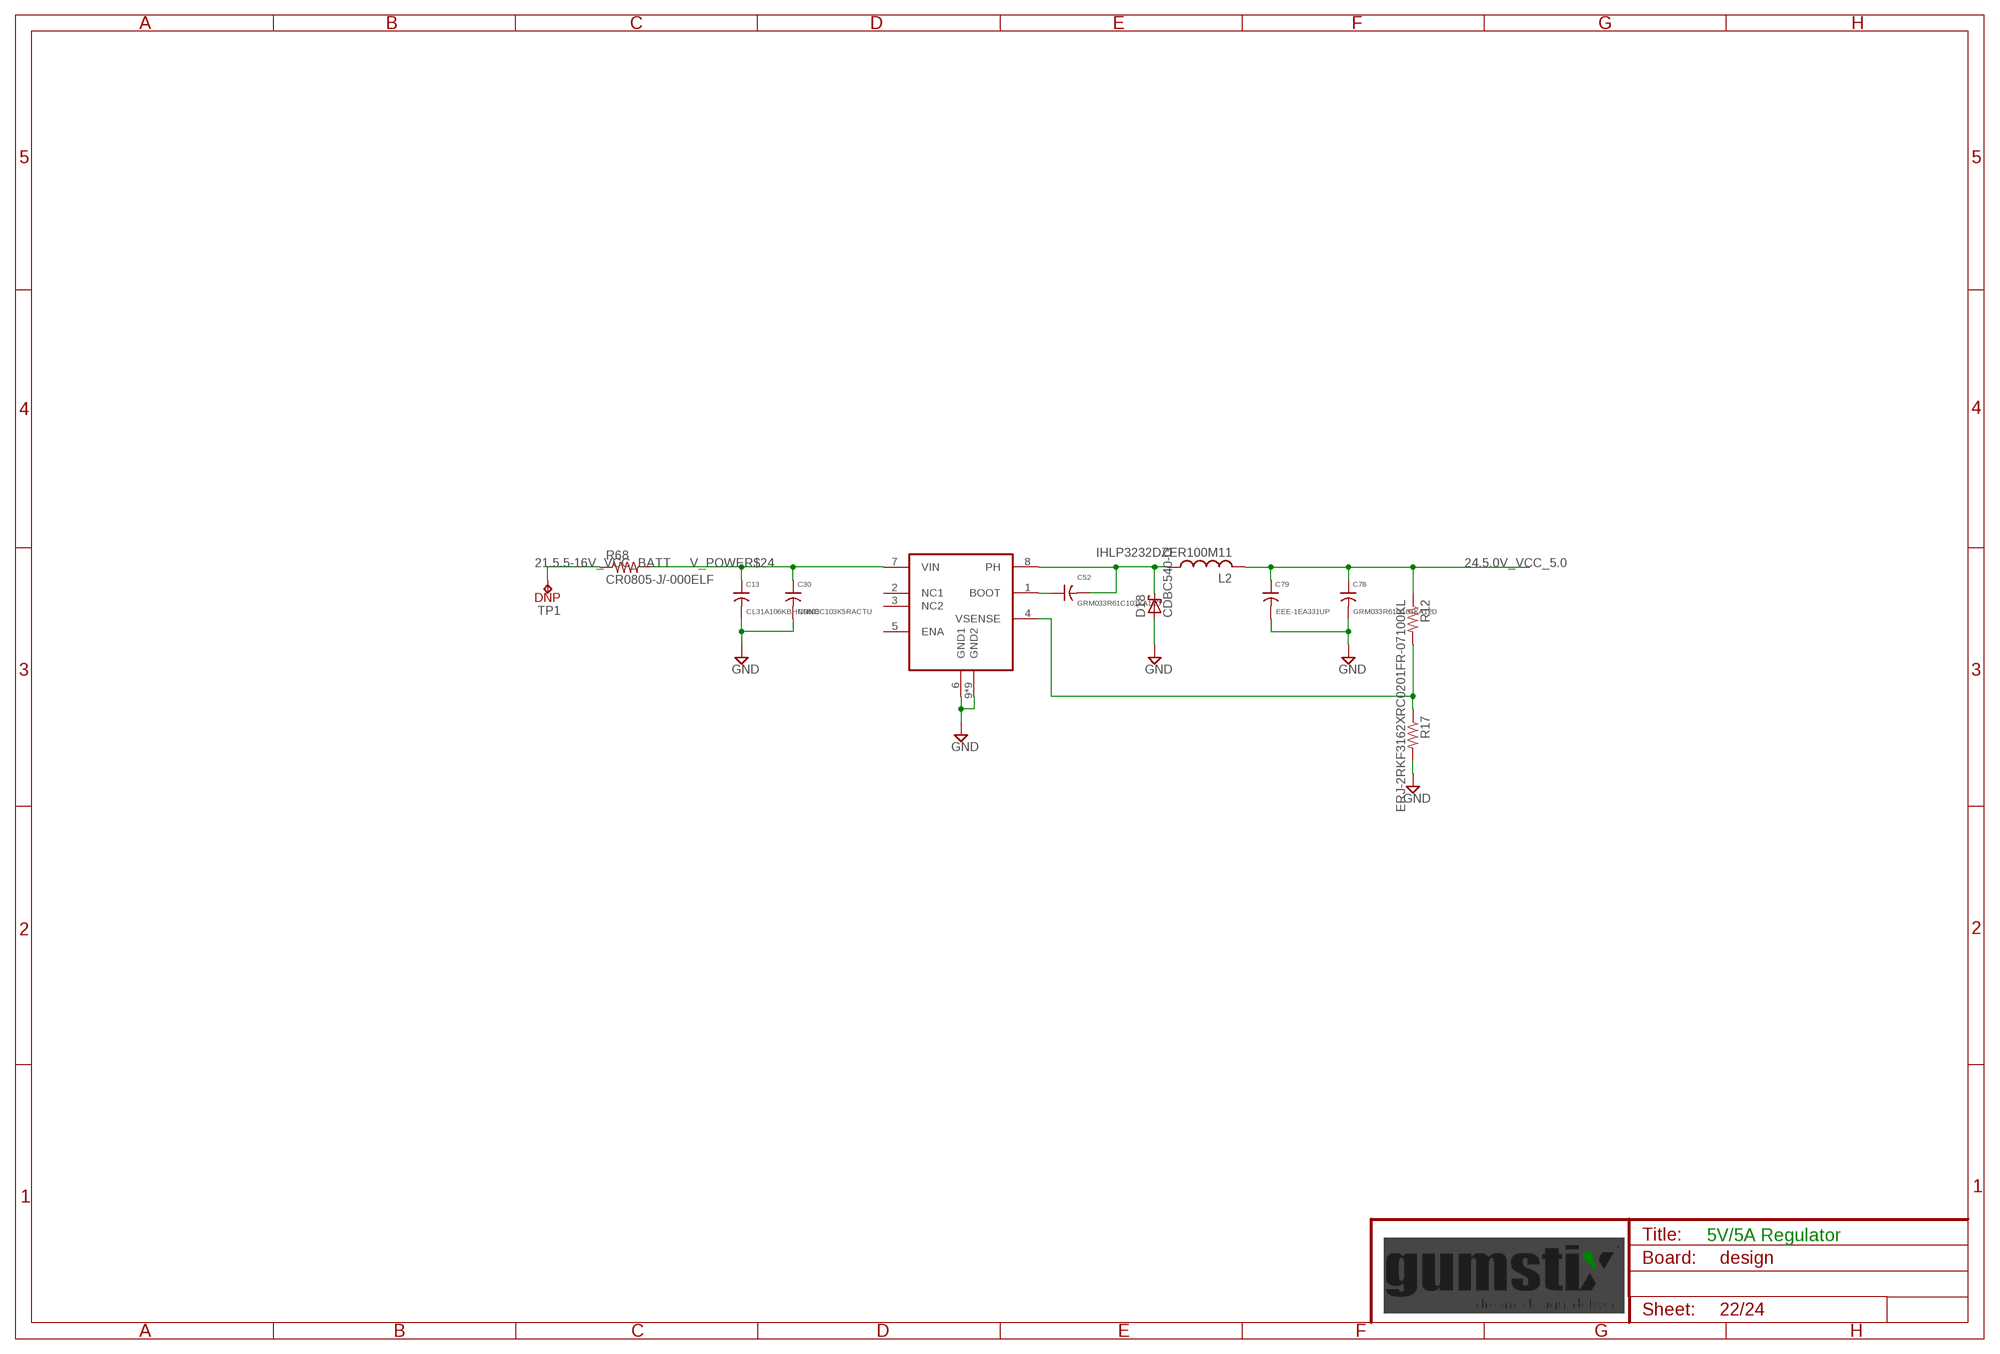
[diagram p21: schematic, sheet 22]

### Parts
C13  CL31A106KBHNNNE  [1206]
C30  C0603C103K5RACTU  [0603]
C52  GRM033R61C103KA12D  [0201]
C78  GRM033R61C103KA12D  [0201]
C79  EEE-1EA331UP  [PANASONIC_F]
D18  CDBC540-G  [DO-214AB]
L2  IHLP3232DZER100M11  [3232DZ]
R12  RC0201FR-07100KL  [0201]
R17  ERJ-2RKF3162X  [0402]
R68  CR0805-J/-000ELF  [0805]
TP1  DNP  TP05  [TP0500]
U1  TPS5450QDDARQ1  [8SO_POWERPAD]

### Nets
21.5.5-16V_VCC_BATT [supply]: R68.1 TP1.1(TP) ; also sheet 3,19
24.5.0V_VCC_5.0 [supply]: C78.1 C79.+ L2.2 R12.1 ; also sheet 18,20,21
BOOT$24 [supply]: C52.1 U1.1(BOOT)
GND [supply]: C13.2 C30.2 C78.2 C79.- D18.A R17.2 U1.6(GND1) U1.9(GND2) U1.PWRPAD1(GND2) U1.PWRPAD2(GND2) U1.PWRPAD3(GND2) U1.PWRPAD4(GND2) U1.PWRPAD5(GND2) U1.PWRPAD6(GND2) U1.PWRPAD7(GND2) U1.PWRPAD8(GND2) ; also sheet 2,3,4,5,6,7,8,9,10,11,12,13,14,15,16,17,18,19,20,21,23,24
PH$24 [supply]: C52.2 D18.C L2.1 U1.8(PH)
V_POWER$24 [supply]: C13.1 C30.1 R68.2 U1.7(VIN)
VSENSE$24 [supply]: R12.2 R17.1 U1.4(VSENSE)
Unconnected: U1.2(NC1) U1.3(NC2) U1.5(ENA)

### Notes on the sheet
- 5V/5A Regulator

## Sheet 23 of 24
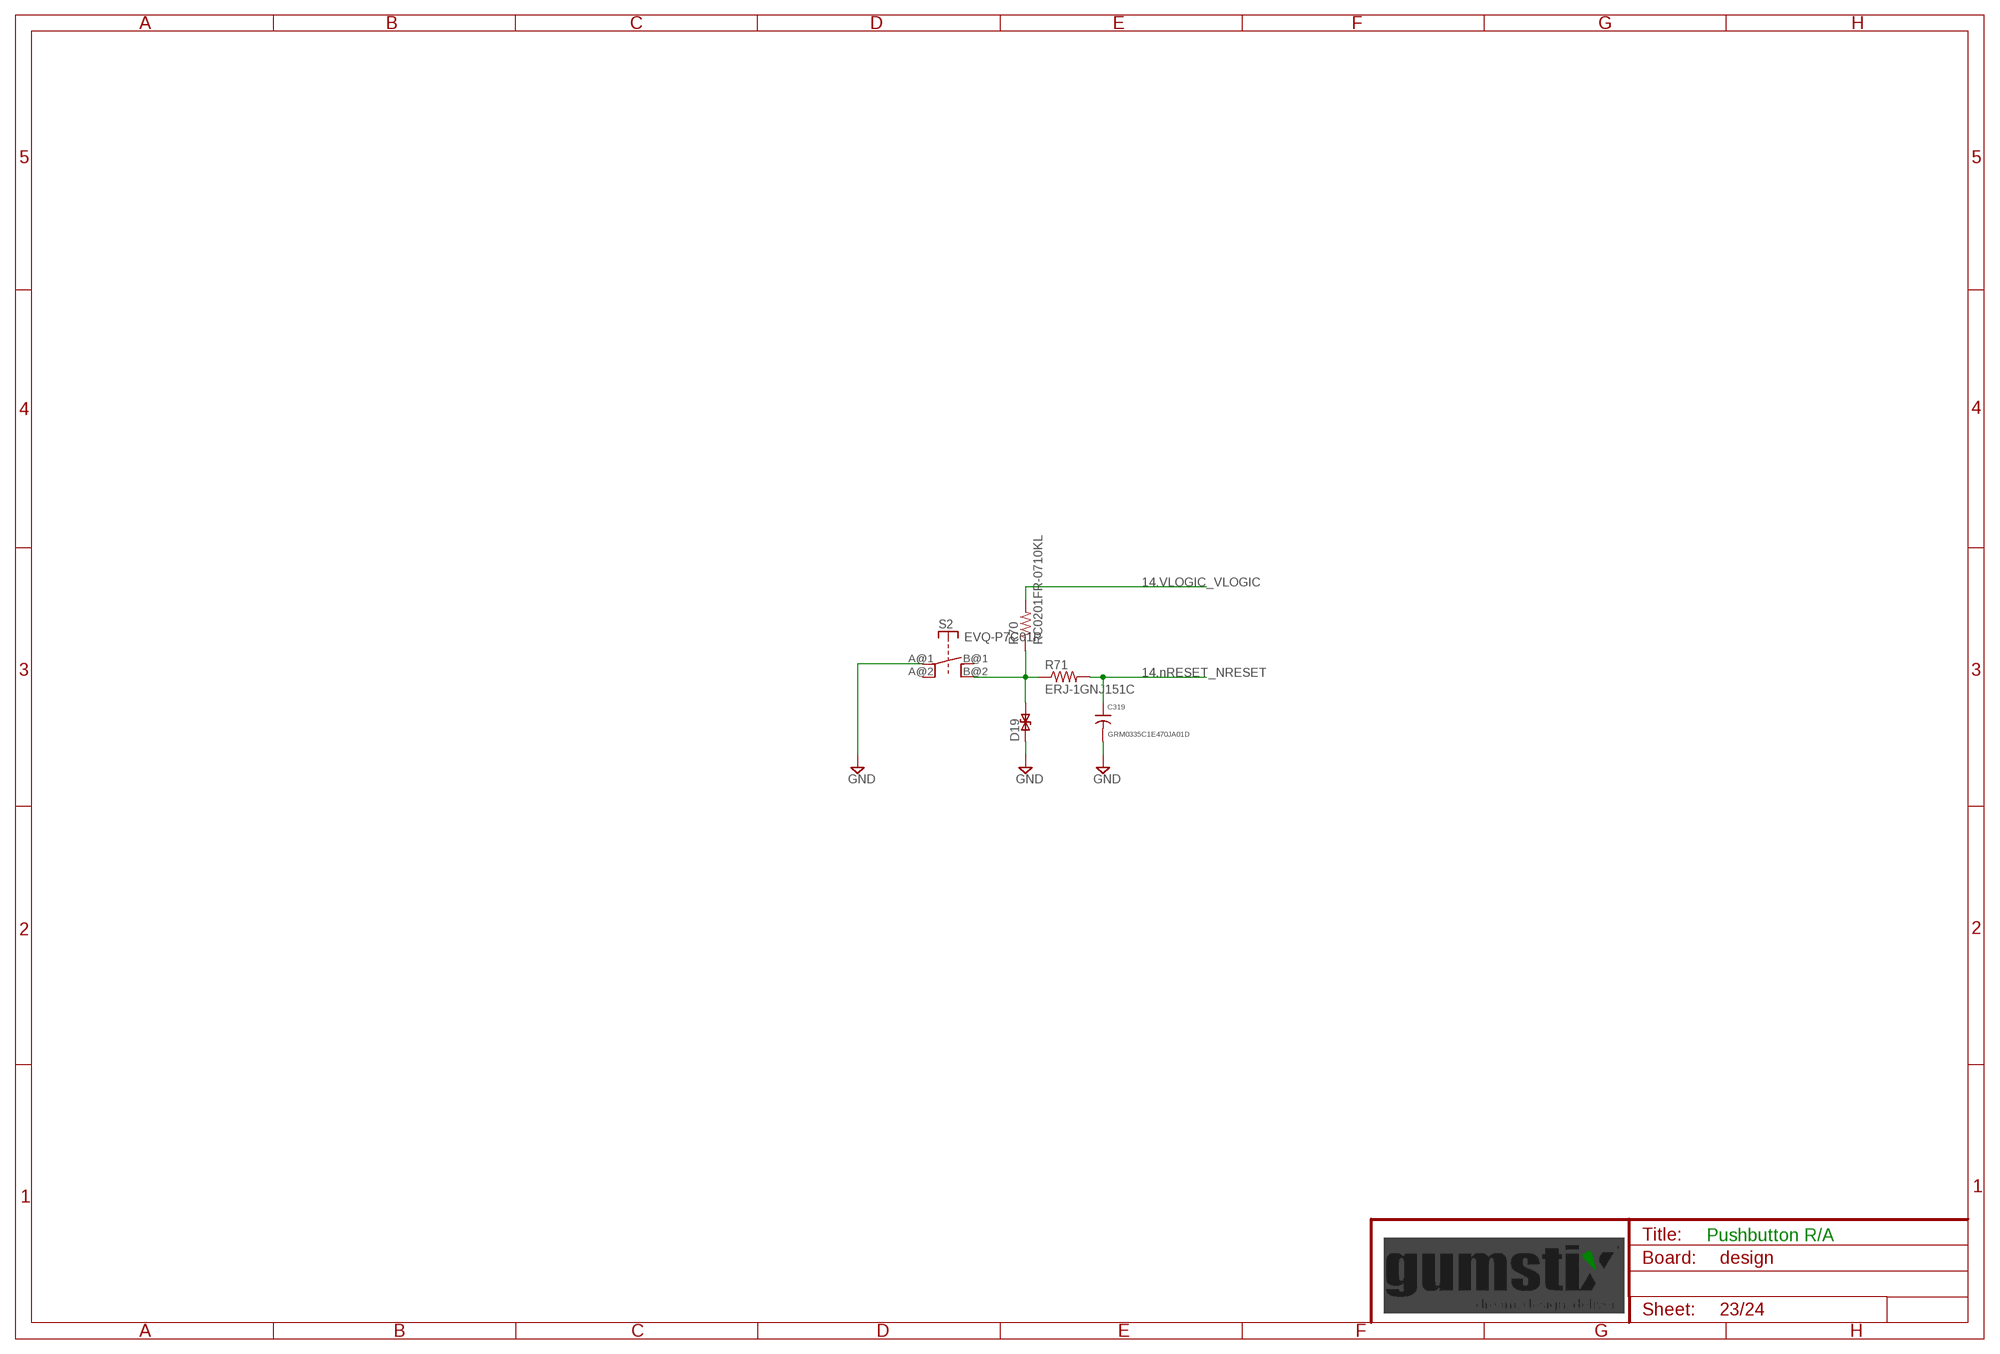
[diagram p22: schematic, sheet 23]

### Parts
C319  GRM0335C1E470JA01D  [0201]
D19  B72590D0050A060  [D0402]
R70  RC0201FR-0710KL  [0201]
R71  ERJ-1GNJ151C  [0201]
S2  EVQ-P7C01P  [EVQP-4]

### Nets
14.nRESET_NRESET: C319.1 R71.2 ; also sheet 11
14.VLOGIC_VLOGIC [supply]: R70.2 ; also sheet 9,10,11,24
BTN_A$25: D19.P2 R70.1 R71.1 S2.B@2(B')
GND [supply]: C319.2 D19.P1 S2.A@1(A) ; also sheet 2,3,4,5,6,7,8,9,10,11,12,13,14,15,16,17,18,19,20,21,22,24
Unconnected: S2.A@2(A') S2.B@1(B)

### Notes on the sheet
- Pushbutton R/A

## Sheet 24 of 24
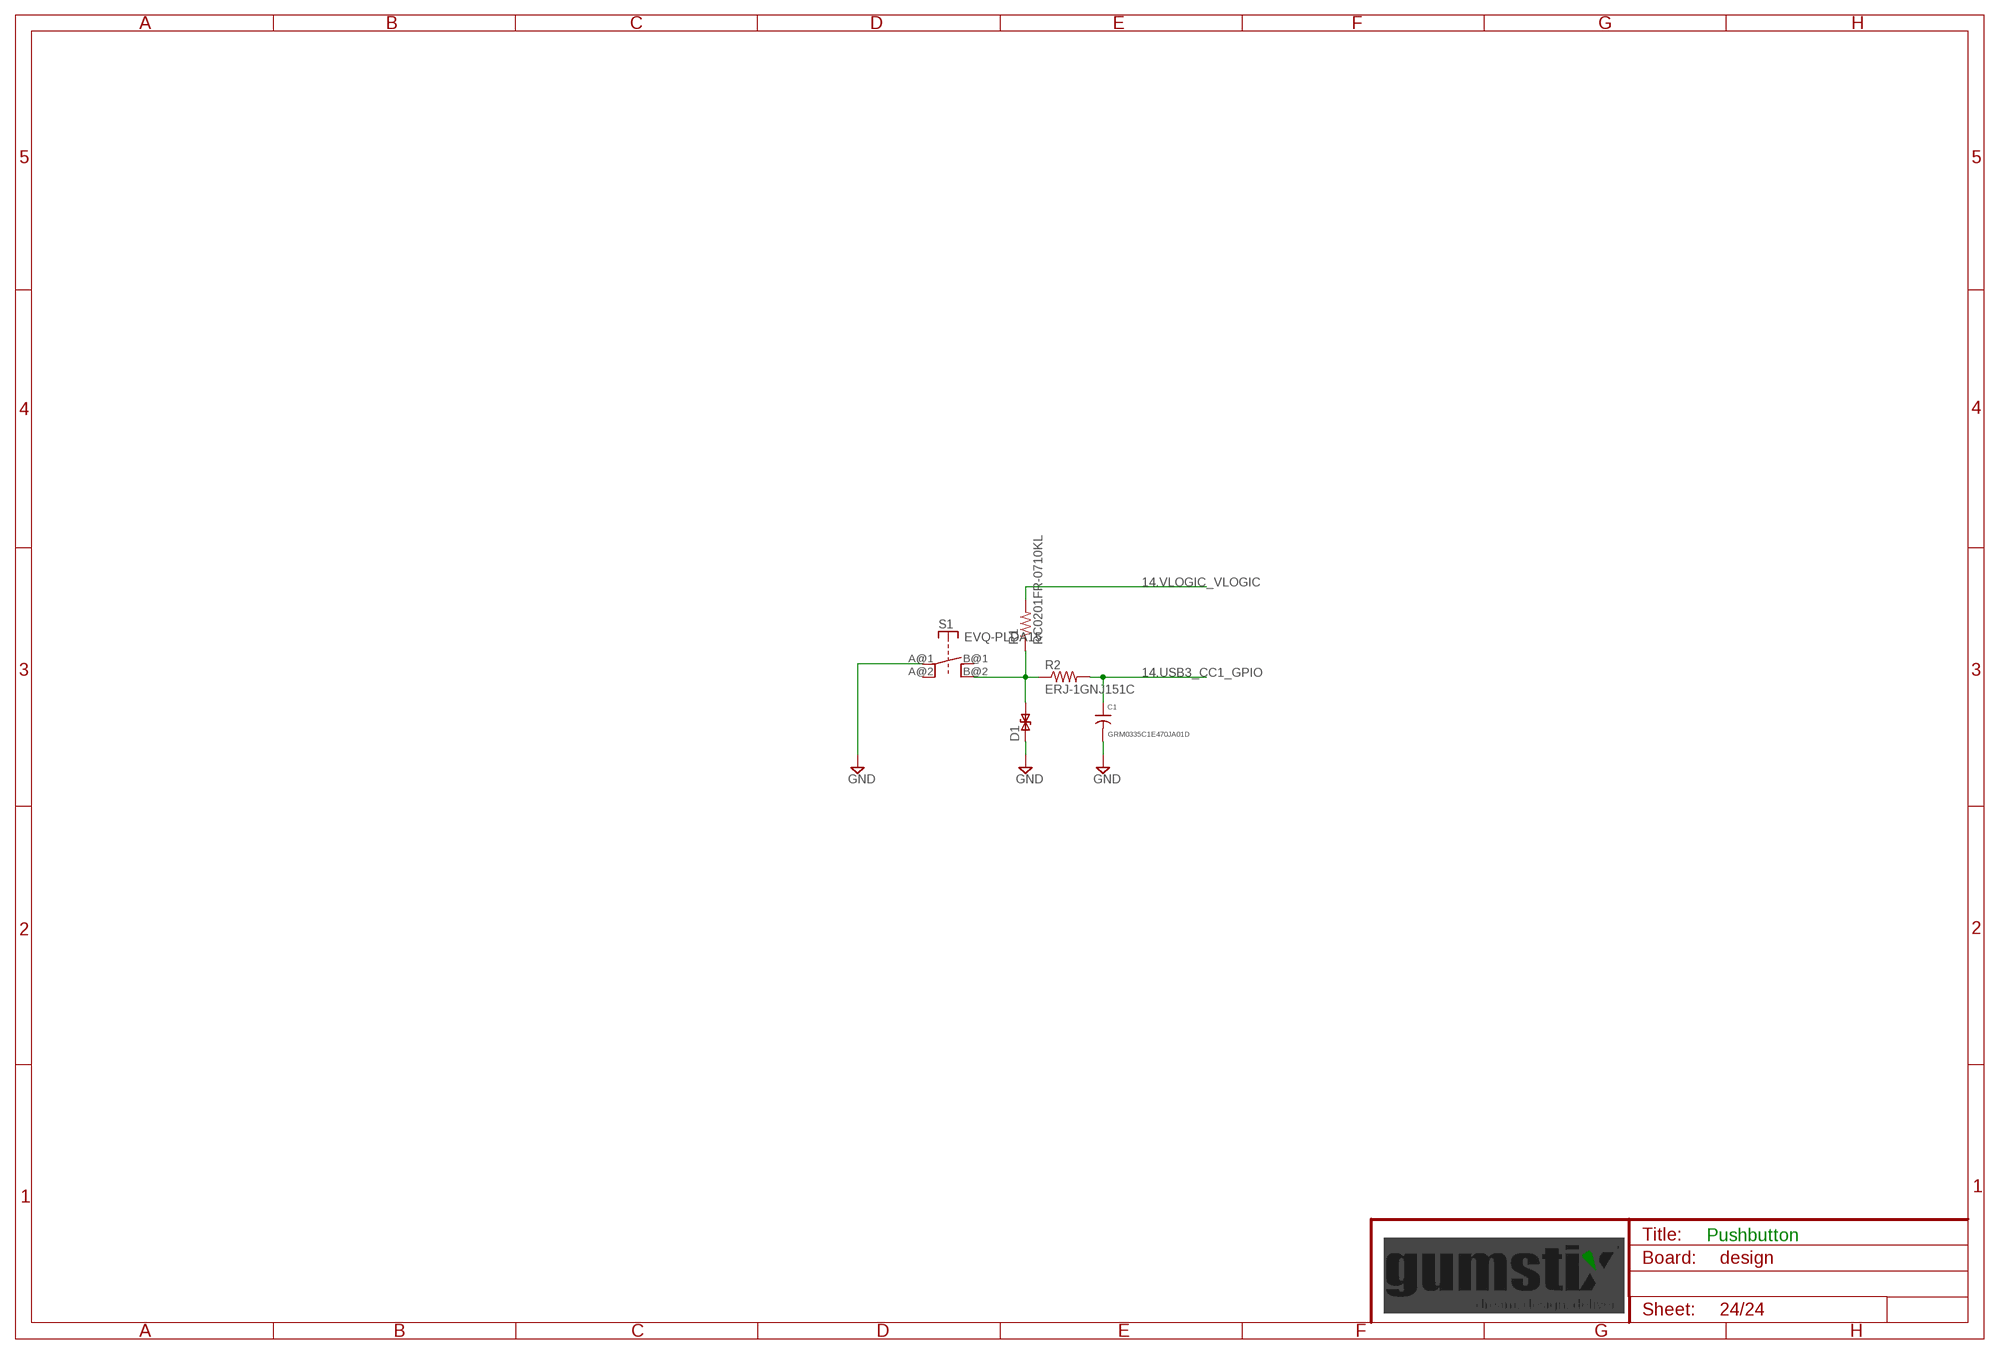
[diagram p23: schematic, sheet 24]

### Parts
C1  GRM0335C1E470JA01D  [0201]
D1  B72590D0050A060  [D0402]
R1  RC0201FR-0710KL  [0201]
R2  ERJ-1GNJ151C  [0201]
S1  EVQ-PLDA15  [EVQ]

### Nets
14.USB3_CC1_GPIO: C1.1 R2.2 ; also sheet 11
14.VLOGIC_VLOGIC [supply]: R1.2 ; also sheet 9,10,11,23
BTN_A$26: D1.P2 R1.1 R2.1 S1.B@2(B')
GND [supply]: C1.2 D1.P1 S1.A@1(A) ; also sheet 2,3,4,5,6,7,8,9,10,11,12,13,14,15,16,17,18,19,20,21,22,23
Unconnected: S1.A@2(A') S1.B@1(B)

### Notes on the sheet
- Pushbutton